# Altium project MaisPipocaG2.PrjPcb (part 1 of 2)
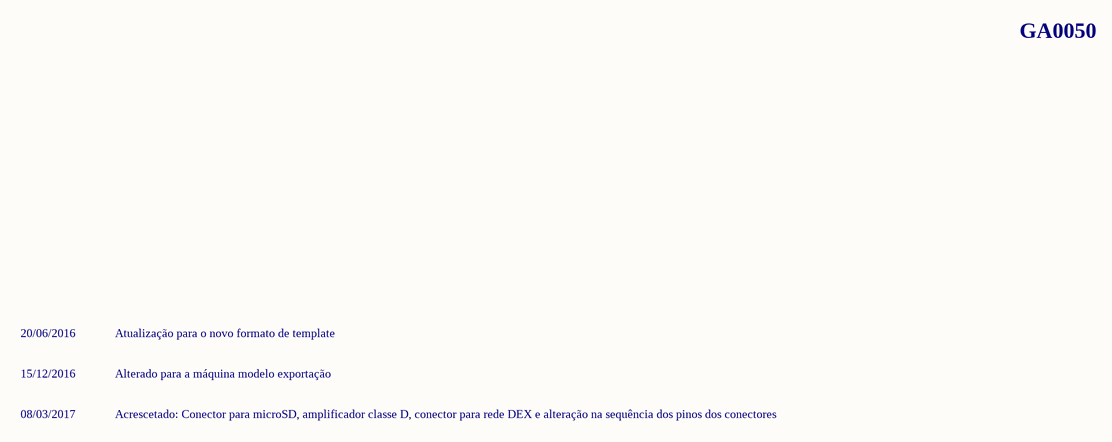
[diagram p0: Capa.SchDoc]
17 sheets, 338 parts. Net scope: global (net labels, ports and power ports of the same name join across sheets).
Board file: PIPOCPUF_2006.PCBDOC
Sheets:
  Capa.SchDoc
  amplificadorAudio.SchDoc
  Barreira_pacote.SchDoc
  Controle_Cupula.SchDoc
  Controle_placa_potencia.SchDoc
  ControleEmbalagem.SchDoc
  ControleLeds.SchDoc
  CPU.SchDoc
  Entrada_comestero_rm5.SchDoc
  IHM.SchDoc
  Interface_gratis.SchDoc
  InterfaceConfiguracao.SchDoc
  JTAG.SchDoc
  Meios_pagamento.SchDoc
  Memoria.SchDoc
  Porta_MDB.SchDoc
  Regulador.SchDoc

## Sheet Capa.SchDoc: CONTROLADORA MAIS PIPOCA - REVISÃO EMC
size A3; Author: Marcos Aquino; DocumentNumber: 1; SheetNumber: 1; SheetTotal: 17; PageSetup: Record=PageOptions|CenterHorizontal=True|CenterVertical=True|PrintScale=0.71|XCorrection=1.00|YCorrection=1.00|PrintKind=0|BorderSize=5000000|LeftOffset=0|BottomOffset=0|Orientation=2|PaperLength=1000|PaperWidth=1000|Scale=100|PaperSource=7|PrintQuality=-3|MediaType=1|DitherType=10|PrintScaleMode=1|PaperKind=A4|PaperIndex=9

### Notes on the sheet
- GA0050
- 20/06/2016
- 15/12/2016
- Atualização para o novo formato de template
- Alterado para a máquina modelo exportação
- 08/03/2017
- Acrescetado: Conector para microSD, amplificador classe D, conector para rede DEX e alteração na sequência dos pinos dos conectores
- Código
- Quark Tecnologia Eletrônica Ltda.
- Rua 216, nº 238 - Sala 01 - Meia Praia - Itapema/SC
- Observações
- (47) 3246-6352  -
- www.quarktee.com.br
- contato@quarktee.com.br
- Projeto
- Quantidade de Páginas
- Revisão
- Projetista
- Local arquivos no servidor
- Data
- Modificação
- Solicitador por:
- Executador por:
- Aprovado por:

## Sheet amplificadorAudio.SchDoc: CONTROLADORA MAIS PIPOCA - REVISÃO EMC
size A3; DocumentNumber: 2; SheetNumber: 2; SheetTotal: 17
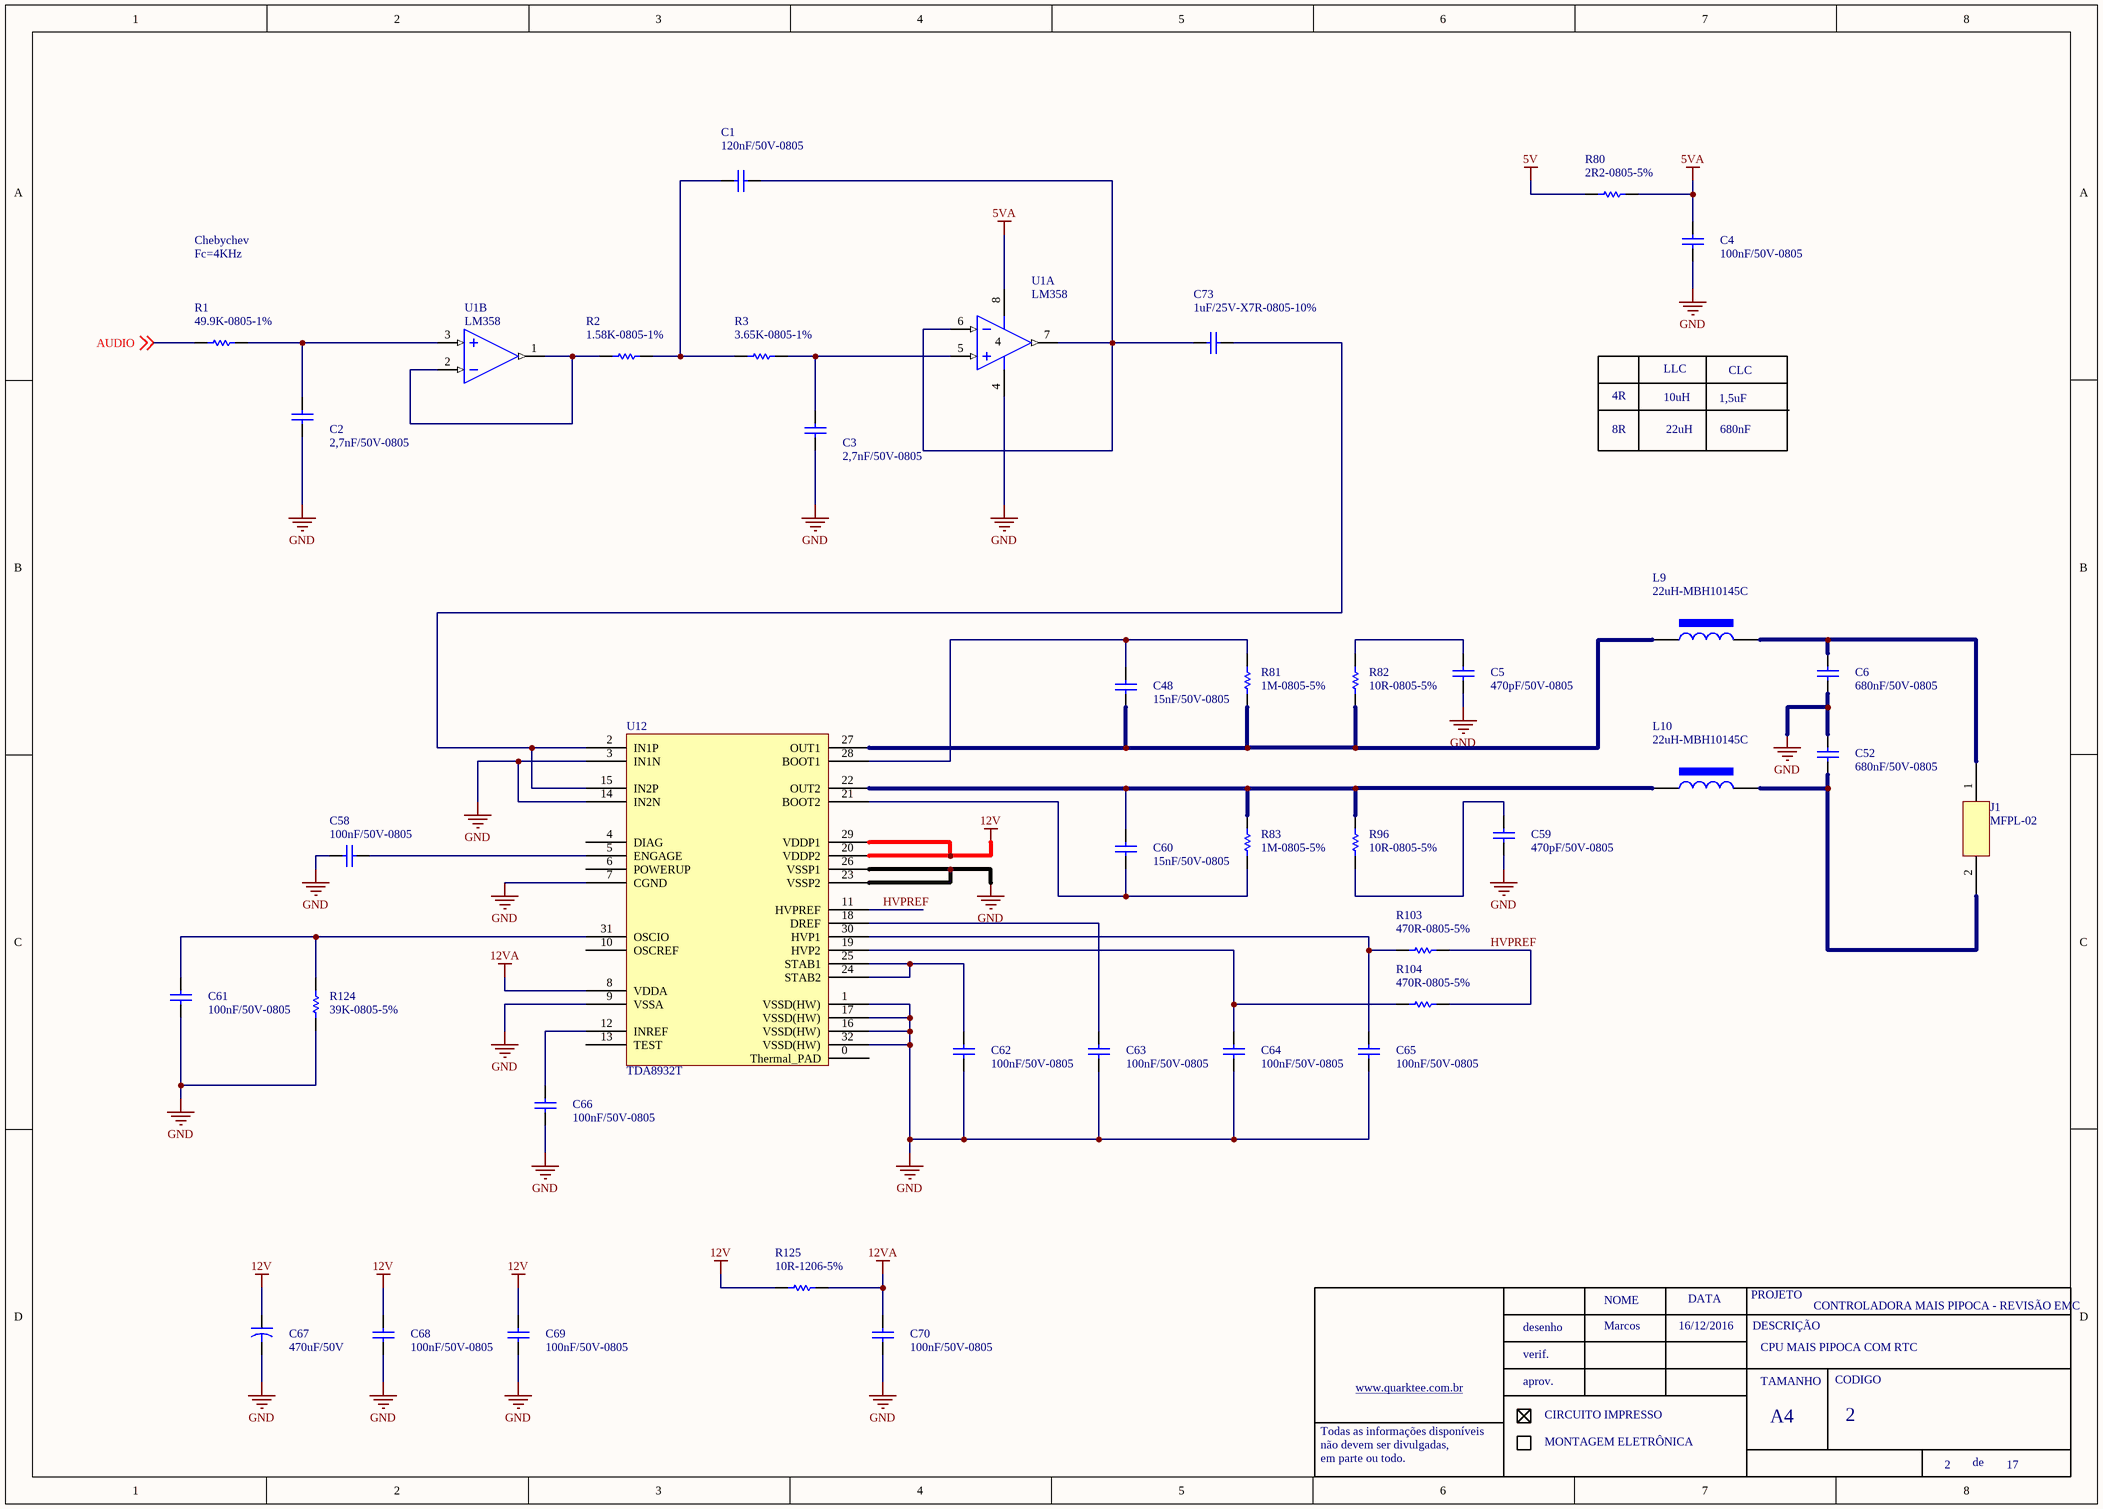
[diagram p1: amplificadorAudio.SchDoc]

### Parts
C1  120nF/50V-0805  [0805-REVISADO ONDA]
C2  2,7nF/50V-0805  [0805-REVISADO ONDA]
C3  2,7nF/50V-0805  [0805-REVISADO ONDA]
C4  100nF/50V-0805  [0805-REVISADO ONDA]
C5  470pF/50V-0805  [0805-REVISADO ONDA]
C6  680nF/50V-0805  [0805-REVISADO ONDA]
C48  15nF/50V-0805  [0805-REVISADO ONDA]
C52  680nF/50V-0805  [0805-REVISADO ONDA]
C58  100nF/50V-0805  [0805-REVISADO ONDA]
C59  470pF/50V-0805  [0805-REVISADO ONDA]
C60  15nF/50V-0805  [0805-REVISADO ONDA]
C61  100nF/50V-0805  [0805-REVISADO ONDA]
C62  100nF/50V-0805  [0805-REVISADO ONDA]
C63  100nF/50V-0805  [0805-REVISADO ONDA]
C64  100nF/50V-0805  [0805-REVISADO ONDA]
C65  100nF/50V-0805  [0805-REVISADO ONDA]
C66  100nF/50V-0805  [0805-REVISADO ONDA]
C67  470uF/50V
C68  100nF/50V-0805  [0805-REVISADO ONDA]
C69  100nF/50V-0805  [0805-REVISADO ONDA]
C70  100nF/50V-0805  [0805-REVISADO ONDA]
C73  1uF/25V-X7R-0805-10%  [0805-REVISADO ONDA]
J1  MFPL-02  [MFPL-02]
L9  22uH-MBH10145C
L10  22uH-MBH10145C
R1  49.9K-0805-1%  [0805-REVISADO ONDA]
R2  1.58K-0805-1%  [0805-REVISADO ONDA]
R3  3.65K-0805-1%  [0805-REVISADO ONDA]
R80  2R2-0805-5%
R81  1M-0805-5%  [0805-REVISADO ONDA]
R82  10R-0805-5%  [0805-REVISADO ONDA]
R83  1M-0805-5%  [0805-REVISADO ONDA]
R96  10R-0805-5%  [0805-REVISADO ONDA]
R103  470R-0805-5%  [0805-REVISADO ONDA]
R104  470R-0805-5%  [0805-REVISADO ONDA]
R124  39K-0805-5%  [0805-REVISADO ONDA]
R125  10R-1206-5%
U1  LM358  (parts A,B of 2)
U12  TDA8932T

### Nets
5V: R80.1
5VA: C4.2 R80.2 U1.8(V+)
12V: C67.1 C68.2 C69.2 R125.1 U12.20(VDDP2) U12.29(VDDP1)
12VA: C70.2 R125.2 U12.8(VDDA)
GND: C2.1 C3.1 C4.1 C5.1 C6.1 C52.2 C58.2 C59.1 C61.1 C62.1 C63.1 C64.1 C65.1 C66.1 C67.2 C68.1 C69.1 C70.1 R124.1 U1.4(GND) U12.1(VSSD(HW)) U12.3(IN1N) U12.7(CGND) U12.9(VSSA) U12.14(IN2N) U12.16(VSSD(HW)) U12.17(VSSD(HW)) U12.23(VSSP2) U12.26(VSSP1) U12.32(VSSD(HW))
AUDIO: R1.1 ; off-sheet AUDIO
HVPREF: R103.1 R104.1 U12.11(HVPREF)
NetC1_1: C1.1 C73.2 U1.6(IN-) U1.7(OUT)
NetC1_2: C1.2 R2.2 R3.1
NetC2_2: C2.2 R1.2 U1.3(IN+)
NetC3_2: C3.2 R3.2 U1.5(IN+)
NetC5_2: C5.2 R82.1
NetC6_2: C6.2 J1.1 L9.1
NetC48_1: C48.1 L9.2 R81.2 R82.2 U12.27(OUT1)
NetC48_2: C48.2 R81.1 U12.28(BOOT1)
NetC52_1: C52.1 J1.2 L10.1
NetC58_1: C58.1 U12.5(ENGAGE)
NetC59_2: C59.2 R96.2
NetC60_1: C60.1 R83.2 U12.21(BOOT2)
NetC60_2: C60.2 L10.2 R83.1 R96.1 U12.22(OUT2)
NetC61_2: C61.2 R124.2 U12.31(OSCIO)
NetC62_2: C62.2 U12.24(STAB2) U12.25(STAB1)
NetC63_2: C63.2 U12.18(DREF)
NetC64_2: C64.2 R104.2 U12.19(HVP2)
NetC65_2: C65.2 R103.2 U12.30(HVP1)
NetC66_2: C66.2 U12.12(INREF)
NetC73_1: C73.1 U12.2(IN1P) U12.15(IN2P)
NetR2_1: R2.1 U1.1(OUT) U1.2(IN-)

Not connected (* = marked no-connect by the designer): U12 0(Thermal_PAD) 4(DIAG) 6(POWERUP) 10(OSCREF) 13(TEST)

### Notes on the sheet
- Chebychev
- Fc=4KHz
- LLC
- CLC
- 4R
- 8R
- 10uH
- 22uH
- 1,5uF
- 680nF
- Marcos
- 16/12/2016
- CPU MAIS PIPOCA COM RTC
- NOME
- DATA
- PROJETO
- DESCRIÇÃO
- www.quarktee.com.br
- desenho
- verif.
- aprov.
- TAMANHO
- CODIGO
- Todas as informações disponíveis
- não devem ser divulgadas,
- em parte ou todo.
- CIRCUITO IMPRESSO
- MONTAGEM ELETRÔNICA
- A4
- de

### Library data of the parts
C1-C3 C5 C6 C48 C52 C59 C60 C73 = 100nF/50-0805-NPO: 100nF/50V-0805; ERP: 104.11.005
C4 C58 C61-C66 C68-C70 = 100nF/50-0805-NPO: ERP: 104.11.005
L9 L10 = indutor 1mH CNF15: 1mH-CNF15-26 AWG; ERP: 211.00.012
R1-R3 R81-R83 R96 R103 R104 R124 = 10K-0805-5%: ERP: 102.11.054
R80 R125 = 10R-0805-5%: ERP: 102.11.019
U1 = LM358: ERP: 10802003
C67 = 470uF/50V: ERP: 105.01.005

## Sheet Barreira_pacote.SchDoc: CONTROLADORA MAIS PIPOCA - REVISÃO EMC
size A3; DocumentNumber: 3; SheetNumber: 3; SheetTotal: 17
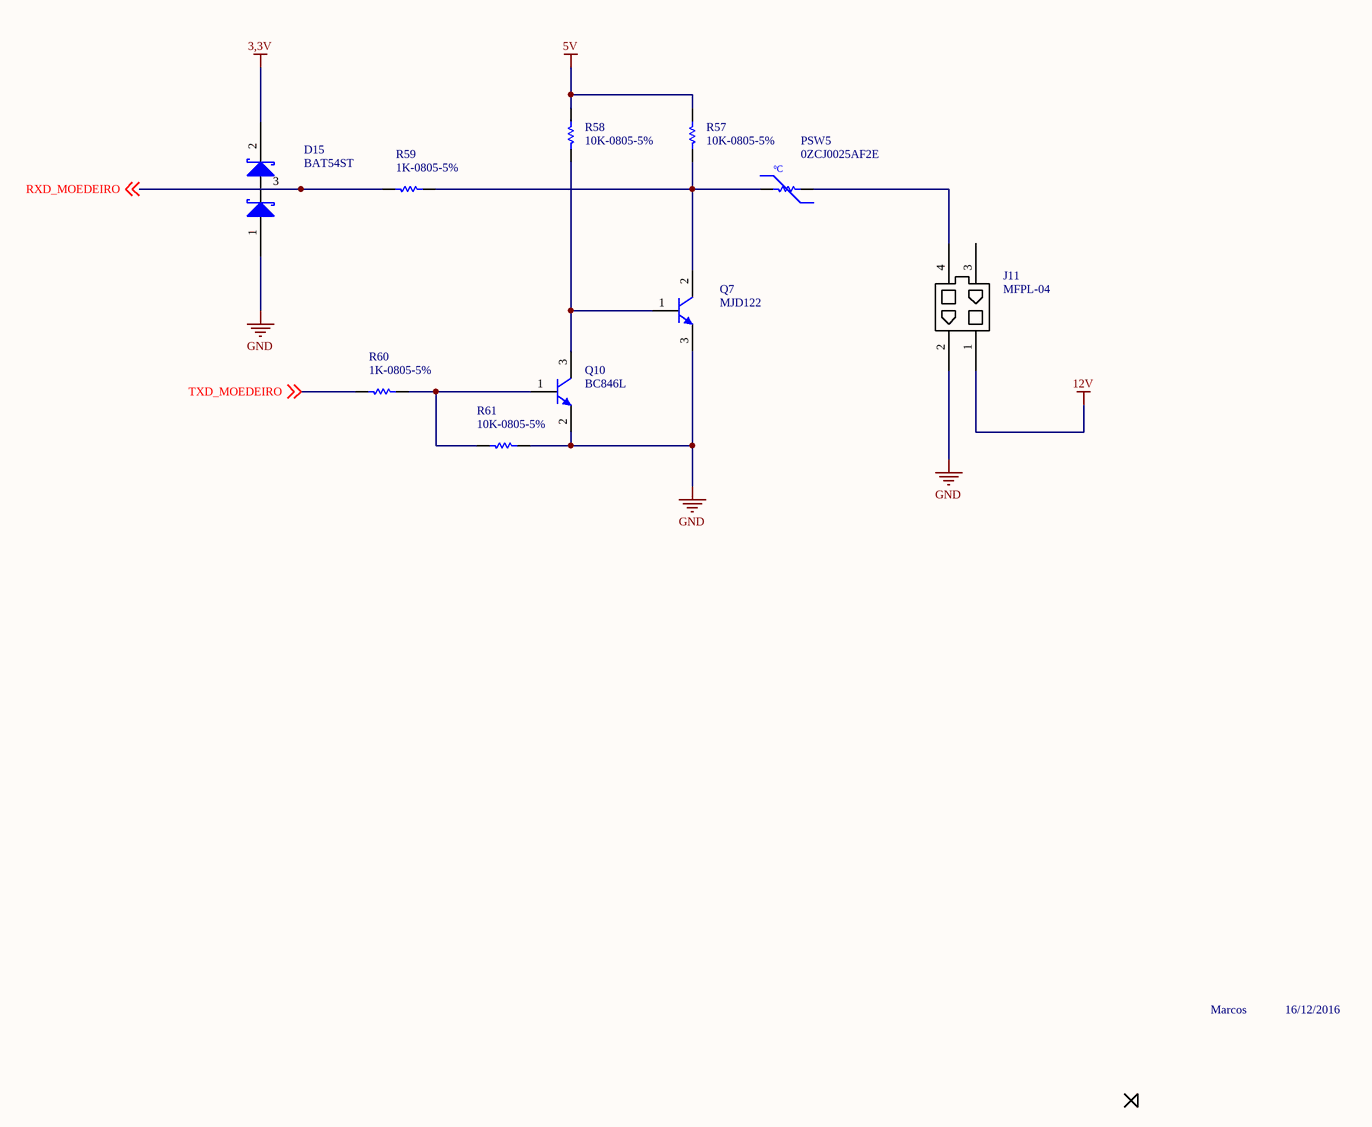
[diagram p2: Barreira_pacote.SchDoc]

### Parts
D15  BAT54ST  [SOT23 - REVISADO ONDA]
J11  MFPL-04
PSW5  0ZCJ0025AF2E  [1206-REVISADO ONDA]
Q7  MJD122  [DPAK REVISADO ONDA]
Q10  BC846L  [SOT23 - REVISADO ONDA]
R57  10K-0805-5%  [0805-REVISADO ONDA]
R58  10K-0805-5%  [0805-REVISADO ONDA]
R59  1K-0805-5%  [0805-REVISADO ONDA]
R60  1K-0805-5%  [0805-REVISADO ONDA]
R61  10K-0805-5%  [0805-REVISADO ONDA]

### Nets
3,3V: D15.2
5V: R57.2 R58.2
12V: J11.1
GND: D15.1 J11.2 Q7.3(E) Q10.2(E) R61.1
RXD_MOEDEIRO: D15.3 R59.2 ; off-sheet RXD_MOEDEIRO
TXD_MOEDEIRO: R60.2 ; off-sheet TXD_MOEDEIRO
NetJ11_4: J11.4 PSW5.1
NetPSW5_2: PSW5.2 Q7.2(C) R57.1 R59.1
NetQ7_1: Q7.1(B) Q10.3(C) R58.1
NetQ10_1: Q10.1(B) R60.1 R61.2

Not connected (* = marked no-connect by the designer): J11 3

### Notes on the sheet
- Marcos
- 16/12/2016
- NOME
- DATA
- PROJETO
- DESCRIÇÃO
- desenho
- verif.
- aprov.
- TAMANHO
- CODIGO
- Todas as informações disponíveis
- não devem ser divulgadas,
- em parte ou todo.
- www.quarktee.com.br
- CIRCUITO IMPRESSO
- MONTAGEM ELETRÔNICA
- A4
- de
- (in symbol PTC 2A-120V) ºC

### Library data of the parts
PSW5 = PTC 2A-120V
Q7 = MJD31
Q10 = BC846: ERP: 106.22.001
R57 R58 R61 = 10K-0805-5%: ERP: 102.11.054
R59 R60 = 1K-0805-5%: ERP: 102.11.042

## Sheet Controle_Cupula.SchDoc: CONTROLADORA MAIS PIPOCA - REVISÃO EMC
size A3; DocumentNumber: 4; SheetNumber: 4; SheetTotal: 17
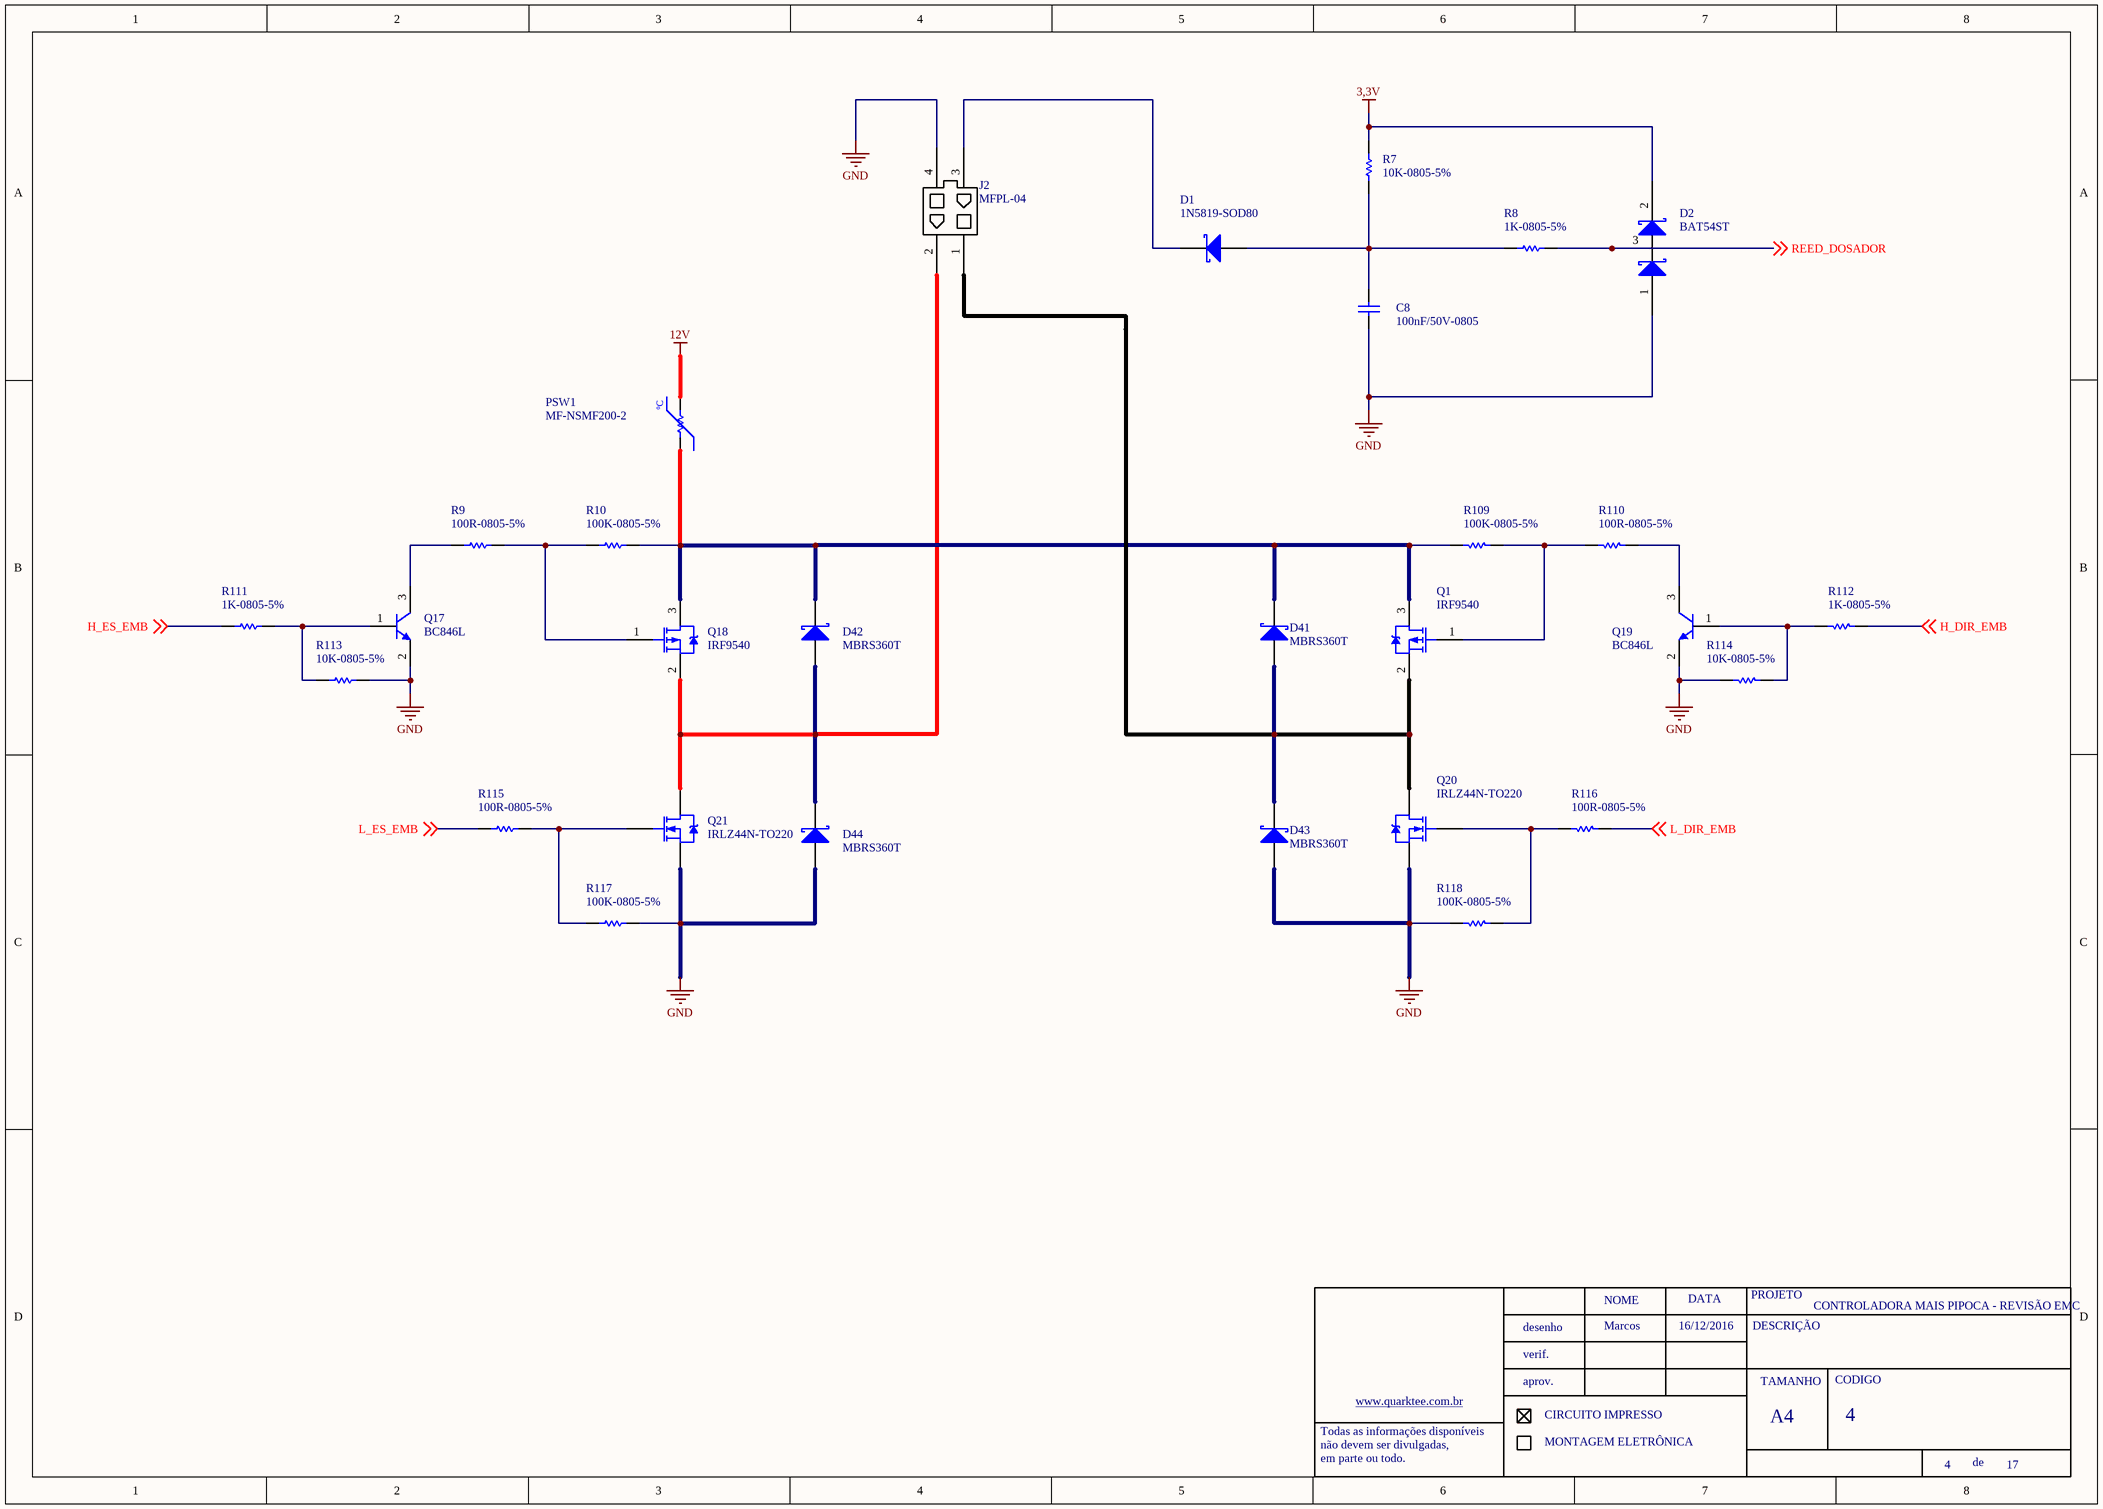
[diagram p3: Controle_Cupula.SchDoc]

### Parts
C8  100nF/50V-0805  [0805-REVISADO ONDA]
D1  1N5819-SOD80  [MINIMLEF/SOD80 - REVISADO ONDA]
D2  BAT54ST  [SOT23 - REVISADO ONDA]
D41  MBRS360T  [DO-214AB]
D42  MBRS360T  [DO-214AB]
D43  MBRS360T  [DO-214AB]
D44  MBRS360T  [DO-214AB]
J2  MFPL-04
PSW1  MF-NSMF200-2  [1206-REVISADO ONDA]
Q1  IRF9540  [TO220-3 EM PÉ]
Q17  BC846L  [SOT23 - REVISADO ONDA]
Q18  IRF9540  [TO220-3 EM PÉ]
Q19  BC846L  [SOT23 - REVISADO ONDA]
Q20  IRLZ44N-TO220  [TO220-3 EM PÉ]
Q21  IRLZ44N-TO220  [TO220-3 EM PÉ]
R7  10K-0805-5%  [0805-REVISADO ONDA]
R8  1K-0805-5%  [0805-REVISADO ONDA]
R9  100R-0805-5%  [0805-REVISADO ONDA]
R10  100K-0805-5%  [0805-REVISADO ONDA]
R109  100K-0805-5%  [0805-REVISADO ONDA]
R110  100R-0805-5%  [0805-REVISADO ONDA]
R111  1K-0805-5%  [0805-REVISADO ONDA]
R112  1K-0805-5%  [0805-REVISADO ONDA]
R113  10K-0805-5%  [0805-REVISADO ONDA]
R114  10K-0805-5%  [0805-REVISADO ONDA]
R115  100R-0805-5%  [0805-REVISADO ONDA]
R116  100R-0805-5%  [0805-REVISADO ONDA]
R117  100K-0805-5%  [0805-REVISADO ONDA]
R118  100K-0805-5%  [0805-REVISADO ONDA]

### Nets
3,3V: D2.2 R7.2
12V: PSW1.2
GND: C8.1 D2.1 D43.1(A) D44.1(A) J2.4 Q17.2(E) Q19.2(E) Q20.3(S) Q21.3(S) R113.2 R114.2 R117.2 R118.2
H_DIR_EMB: R112.1 ; off-sheet H_DIR_EMB
H_ES_EMB: R111.1 ; off-sheet H_ES_EMB
L_DIR_EMB: R116.1 ; off-sheet L_DIR_EMB
L_ES_EMB: R115.1 ; off-sheet L_ES_EMB
REED_DOSADOR: D2.3 R8.2 ; off-sheet REED_DOSADOR
NetC8_2: C8.2 D1.1(A) R7.1 R8.1
NetD1_2: D1.2(K) J2.3
NetD41_1: D41.1(A) D43.2(K) J2.1 Q1.2(DRENO) Q20.2(D)
NetD41_2: D41.2(K) D42.2(K) PSW1.1 Q1.3(SOURCE) Q18.3(SOURCE) R10.2 R109.2
NetD42_1: D42.1(A) D44.2(K) J2.2 Q18.2(DRENO) Q21.2(D)
NetQ1_1: Q1.1(GATE) R109.1 R110.2
NetQ17_1: Q17.1(B) R111.2 R113.1
NetQ17_3: Q17.3(C) R9.1
NetQ18_1: Q18.1(GATE) R9.2 R10.1
NetQ19_1: Q19.1(B) R112.2 R114.1
NetQ19_3: Q19.3(C) R110.1
NetQ20_1: Q20.1(G) R116.2 R118.1
NetQ21_1: Q21.1(G) R115.2 R117.1

### Notes on the sheet
- Marcos
- 16/12/2016
- NOME
- DATA
- PROJETO
- DESCRIÇÃO
- desenho
- verif.
- aprov.
- TAMANHO
- CODIGO
- Todas as informações disponíveis
- não devem ser divulgadas,
- em parte ou todo.
- www.quarktee.com.br
- CIRCUITO IMPRESSO
- MONTAGEM ELETRÔNICA
- A4
- de
- (in symbol POLYSWITCH 200mA) ºC

### Library data of the parts
C8 = 100nF/50-0805-NPO: ERP: 104.11.005
D41-D44 = 1N5819-SOD80: ERP: 121.18.003
PSW1 = POLYSWITCH 200mA: NANOSMDC020F-2; ERP: 128.12.002
Q17 Q19 = BC846: ERP: 106.22.001
R9 R110 = 1K-0805-5%: ERP: 102.11.042
R111 R112 = 10K-0805-5%: ERP: 102.11.054
D1 = 1N5819-SOD80: ERP: 121.18.003
Q20 Q21 = IRLZ44N-TO220: ERP: 107.01.006
R7 R113 R114 = 10K-0805-5%: ERP: 102.11.054
R8 = 1K-0805-5%: ERP: 102.11.042
R10 R109 R117 R118 = 100K-0805-5%: ERP: 102.11.066
R115 R116 = 100R-0805-5%: ERP: 102.11.031

## Sheet Controle_placa_potencia.SchDoc: CONTROLADORA MAIS PIPOCA - REVISÃO EMC
size A3; DocumentNumber: 5; SheetNumber: 5; SheetTotal: 17
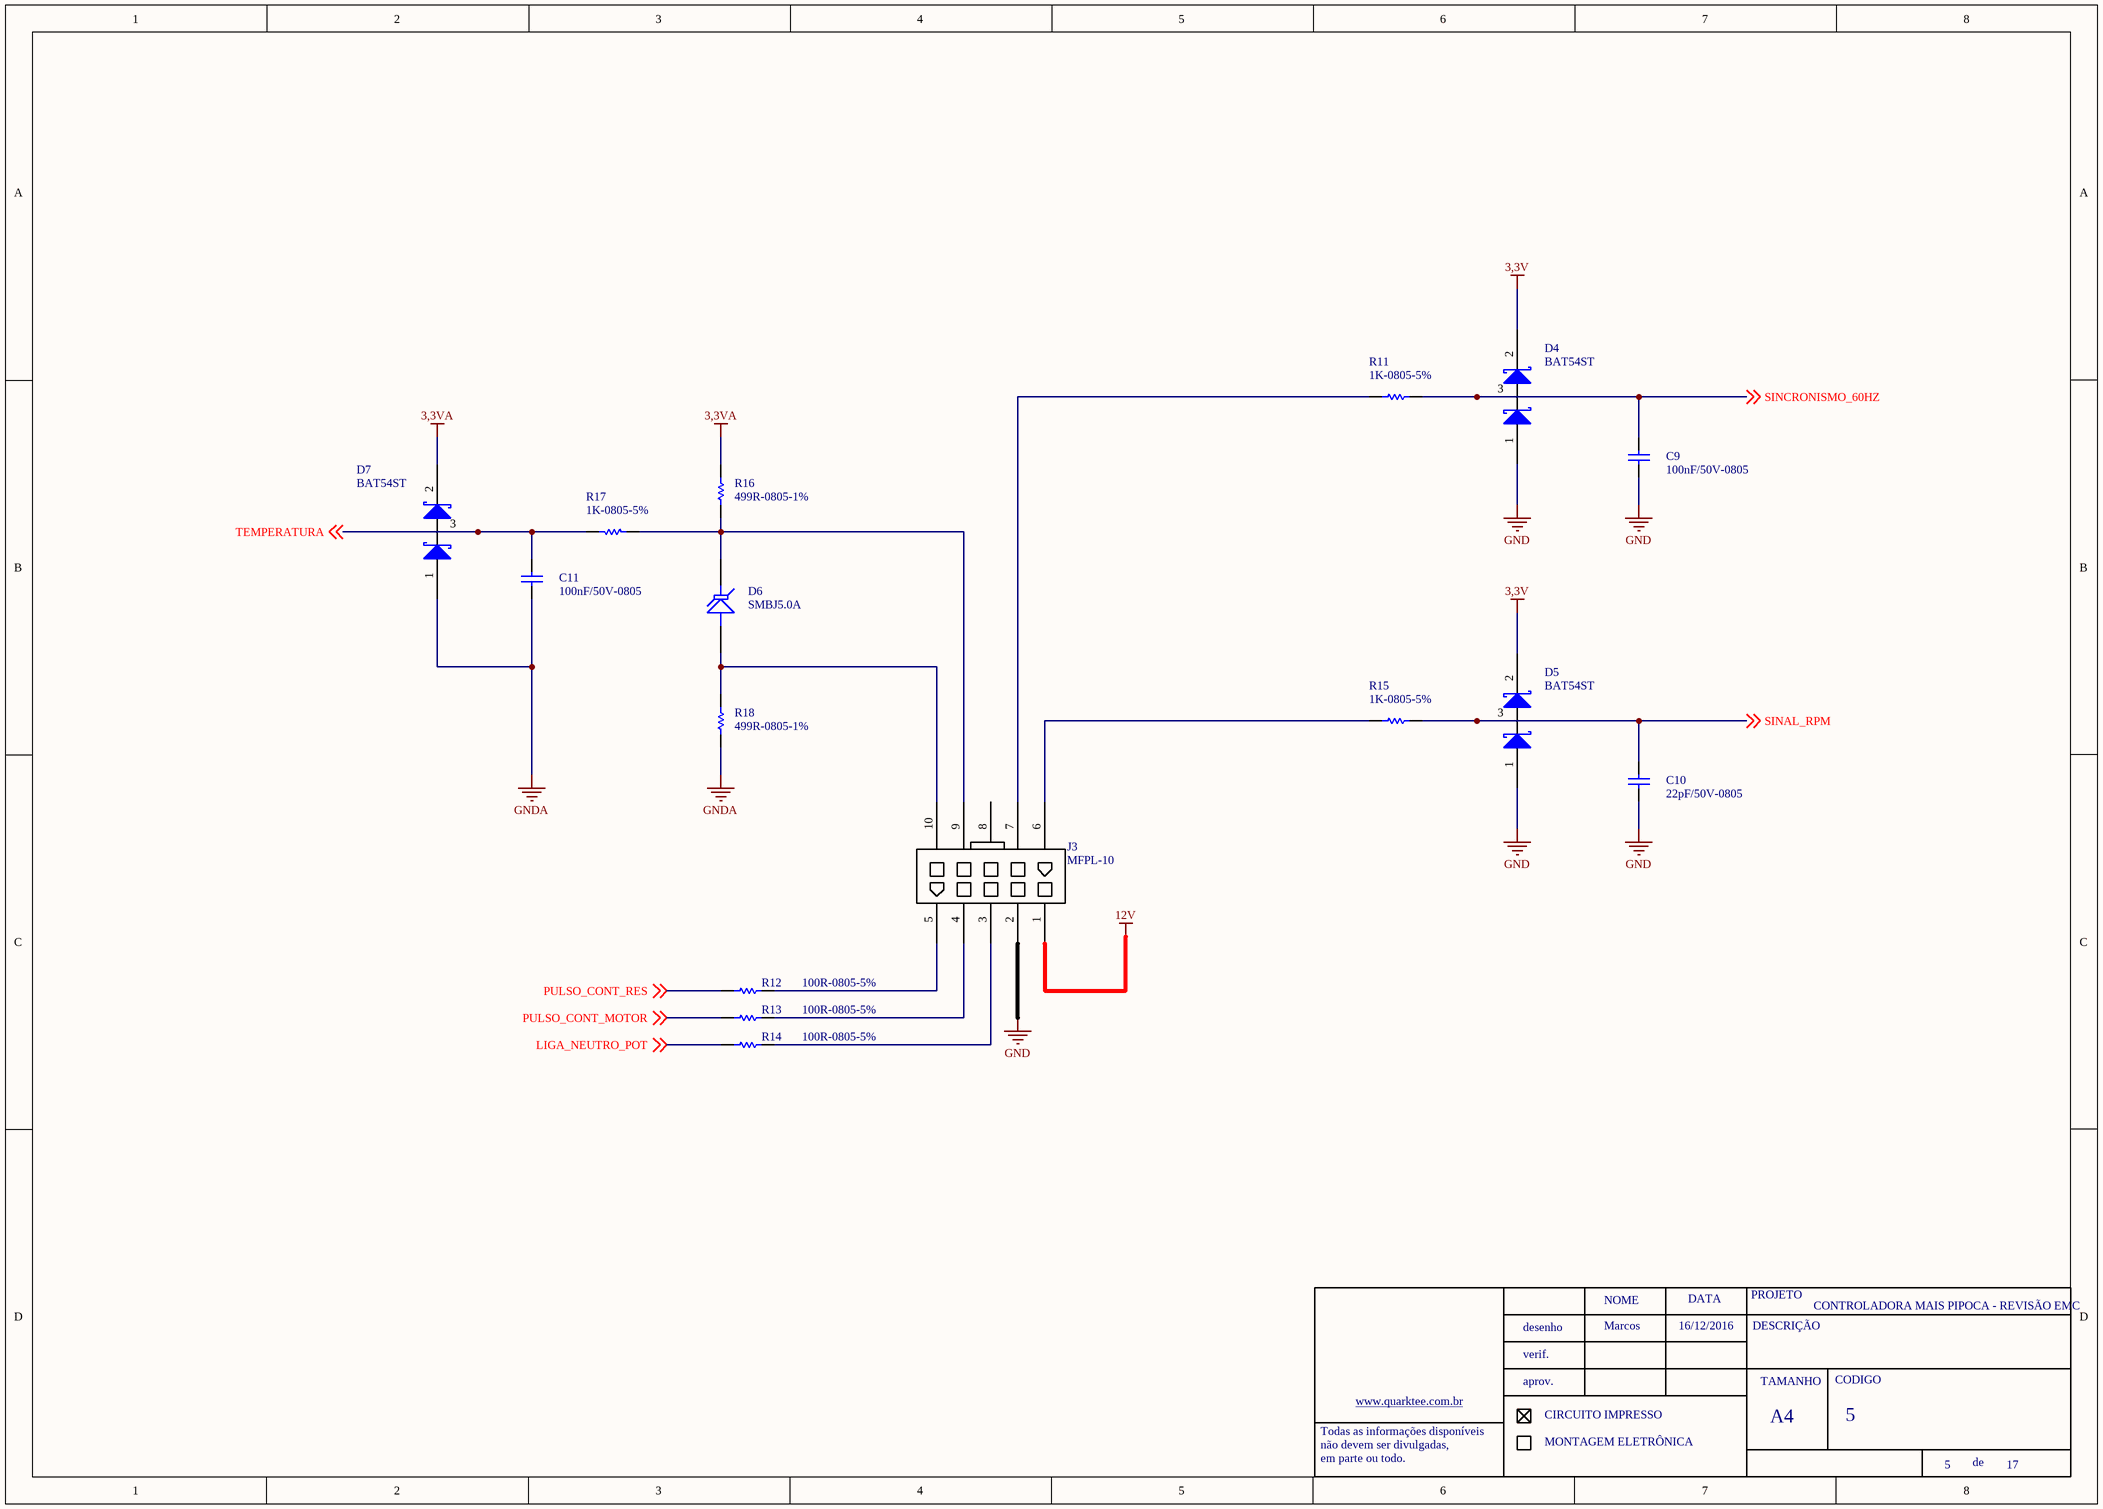
[diagram p4: Controle_placa_potencia.SchDoc]

### Parts
C9  100nF/50V-0805  [0805-REVISADO ONDA]
C10  22pF/50V-0805  [0805-REVISADO ONDA]
C11  100nF/50V-0805  [0805-REVISADO ONDA]
D4  BAT54ST  [SOT23 - REVISADO ONDA]
D5  BAT54ST  [SOT23 - REVISADO ONDA]
D6  SMBJ5.0A  [SMA DIODES]
D7  BAT54ST  [SOT23 - REVISADO ONDA]
J3  MFPL-10
R11  1K-0805-5%  [0805-REVISADO ONDA]
R12  100R-0805-5%  [0805-REVISADO ONDA]
R13  100R-0805-5%  [0805-REVISADO ONDA]
R14  100R-0805-5%  [0805-REVISADO ONDA]
R15  1K-0805-5%  [0805-REVISADO ONDA]
R16  499R-0805-1%  [0805-REVISADO ONDA]
R17  1K-0805-5%  [0805-REVISADO ONDA]
R18  499R-0805-1%  [0805-REVISADO ONDA]

### Nets
3,3V: D4.2 D5.2
3,3VA: D7.2 R16.2
12V: J3.1
GND: C9.2 C10.2 D4.1 D5.1 J3.2
GNDA: C11.1 D7.1 R18.1
LIGA_NEUTRO_POT: R14.1 ; off-sheet LIGA_NEUTRO_POT
PULSO_CONT_MOTOR: R13.1 ; off-sheet PULSO_CONT_MOTOR
PULSO_CONT_RES: R12.2 ; off-sheet PULSO_CONT_RES
SINAL_RPM: C10.1 D5.3 R15.2 ; off-sheet SINAL_RPM
SINCRONISMO_60HZ: C9.1 D4.3 R11.2 ; off-sheet SINCRONISMO_60HZ
TEMPERATURA: C11.2 D7.3 R17.2 ; off-sheet TEMPERATURA
NetD6_1: D6.1(A) J3.10 R18.2
NetD6_2: D6.2(K) J3.9 R16.1 R17.1
NetJ3_3: J3.3 R14.2
NetJ3_4: J3.4 R13.2
NetJ3_5: J3.5 R12.1
NetJ3_6: J3.6 R15.1
NetJ3_7: J3.7 R11.1

Not connected (* = marked no-connect by the designer): J3 8

### Notes on the sheet
- Marcos
- 16/12/2016
- NOME
- DATA
- PROJETO
- DESCRIÇÃO
- desenho
- verif.
- aprov.
- TAMANHO
- CODIGO
- Todas as informações disponíveis
- não devem ser divulgadas,
- em parte ou todo.
- www.quarktee.com.br
- CIRCUITO IMPRESSO
- MONTAGEM ELETRÔNICA
- A4
- de

### Library data of the parts
C9 C11 = 100nF/50-0805-NPO: ERP: 104.11.005
C10 = 100nF/50-0805-NPO: 100nF/50V-0805; ERP: 104.11.005
R16 R18 = 10K-0805-5%: ERP: 102.11.054
D6 = SMBJ5.0A: ERP: 128.02.002
R11 R15 R17 = 1K-0805-5%: ERP: 102.11.042
R12-R14 = 100R-0805-5%: ERP: 102.11.031

## Sheet ControleEmbalagem.SchDoc: CONTROLADORA MAIS PIPOCA - REVISÃO EMC
size A3; DocumentNumber: 6; SheetNumber: 6; SheetTotal: 17
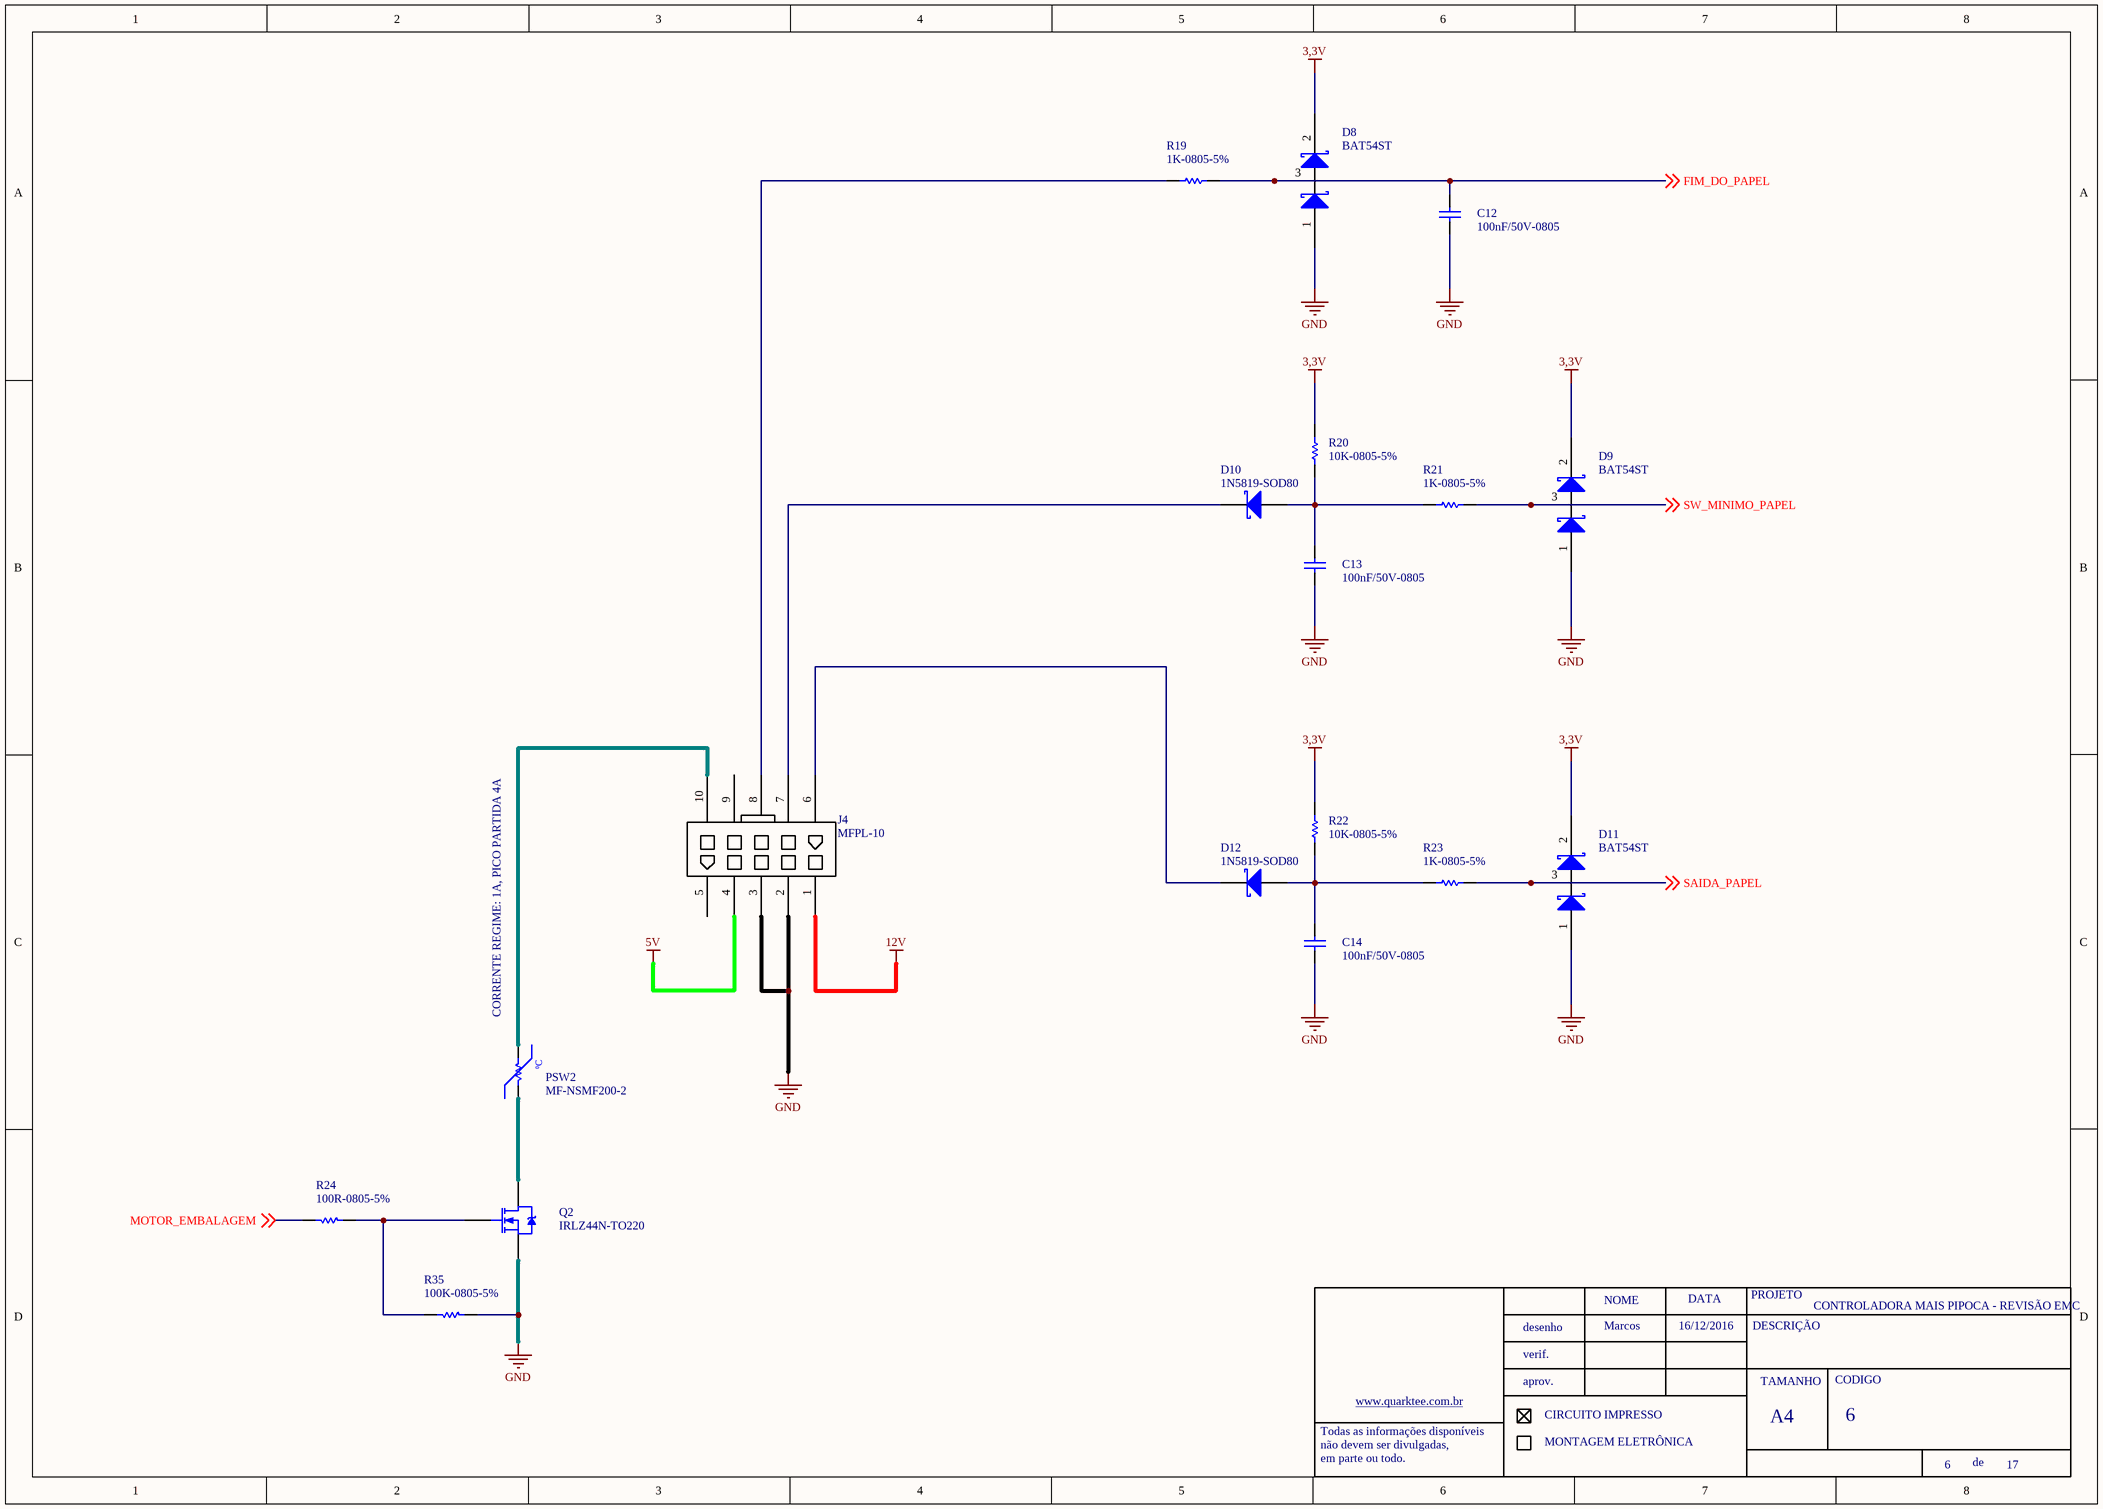
[diagram p5: ControleEmbalagem.SchDoc]

### Parts
C12  100nF/50V-0805  [0805-REVISADO ONDA]
C13  100nF/50V-0805  [0805-REVISADO ONDA]
C14  100nF/50V-0805  [0805-REVISADO ONDA]
D8  BAT54ST  [SOT23 - REVISADO ONDA]
D9  BAT54ST  [SOT23 - REVISADO ONDA]
D10  1N5819-SOD80  [MINIMLEF/SOD80 - REVISADO ONDA]
D11  BAT54ST  [SOT23 - REVISADO ONDA]
D12  1N5819-SOD80  [MINIMLEF/SOD80 - REVISADO ONDA]
J4  MFPL-10
PSW2  MF-NSMF200-2  [1206-REVISADO ONDA]
Q2  IRLZ44N-TO220  [TO220-3 EM PÉ]
R19  1K-0805-5%  [0805-REVISADO ONDA]
R20  10K-0805-5%  [0805-REVISADO ONDA]
R21  1K-0805-5%  [0805-REVISADO ONDA]
R22  10K-0805-5%  [0805-REVISADO ONDA]
R23  1K-0805-5%  [0805-REVISADO ONDA]
R24  100R-0805-5%  [0805-REVISADO ONDA]
R35  100K-0805-5%  [0805-REVISADO ONDA]

### Nets
3,3V: D8.2 D9.2 D11.2 R20.2 R22.2
5V: J4.4
12V: J4.1
GND: C12.1 C13.1 C14.1 D8.1 D9.1 D11.1 J4.2 J4.3 Q2.3(S) R35.1
FIM_DO_PAPEL: C12.2 D8.3 R19.2 ; off-sheet FIM_DO_PAPEL
MOTOR_EMBALAGEM: R24.2 ; off-sheet MOTOR_EMBALAGEM
SAIDA_PAPEL: D11.3 R23.2 ; off-sheet SAIDA_PAPEL
SW_MINIMO_PAPEL: D9.3 R21.2 ; off-sheet SW_MINIMO_PAPEL
NetC13_2: C13.2 D10.1(A) R20.1 R21.1
NetC14_2: C14.2 D12.1(A) R22.1 R23.1
NetD10_2: D10.2(K) J4.7
NetD12_2: D12.2(K) J4.6
NetJ4_8: J4.8 R19.1
NetJ4_10: J4.10 PSW2.2
NetPSW2_1: PSW2.1 Q2.2(D)
NetQ2_1: Q2.1(G) R24.1 R35.2

Not connected (* = marked no-connect by the designer): J4 5 9

### Notes on the sheet
- (near PSW2) CORRENTE REGIME: 1A, PICO PARTIDA 4A
- Marcos
- 16/12/2016
- NOME
- DATA
- PROJETO
- DESCRIÇÃO
- desenho
- verif.
- aprov.
- TAMANHO
- CODIGO
- Todas as informações disponíveis
- não devem ser divulgadas,
- em parte ou todo.
- www.quarktee.com.br
- CIRCUITO IMPRESSO
- MONTAGEM ELETRÔNICA
- A4
- de
- (in symbol POLYSWITCH 200mA) ºC

### Library data of the parts
C12-C14 = 100nF/50-0805-NPO: ERP: 104.11.005
PSW2 = POLYSWITCH 200mA: NANOSMDC020F-2; ERP: 128.12.002
D10 D12 = 1N5819-SOD80: ERP: 121.18.003
Q2 = IRLZ44N-TO220: ERP: 107.01.006
R19 R21 R23 = 1K-0805-5%: ERP: 102.11.042
R20 R22 = 10K-0805-5%: ERP: 102.11.054
R24 = 100R-0805-5%: ERP: 102.11.031
R35 = 100K-0805-5%: ERP: 102.11.066

## Sheet ControleLeds.SchDoc: CONTROLADORA MAIS PIPOCA - REVISÃO EMC
size A3; DocumentNumber: 7; SheetNumber: 7; SheetTotal: 17
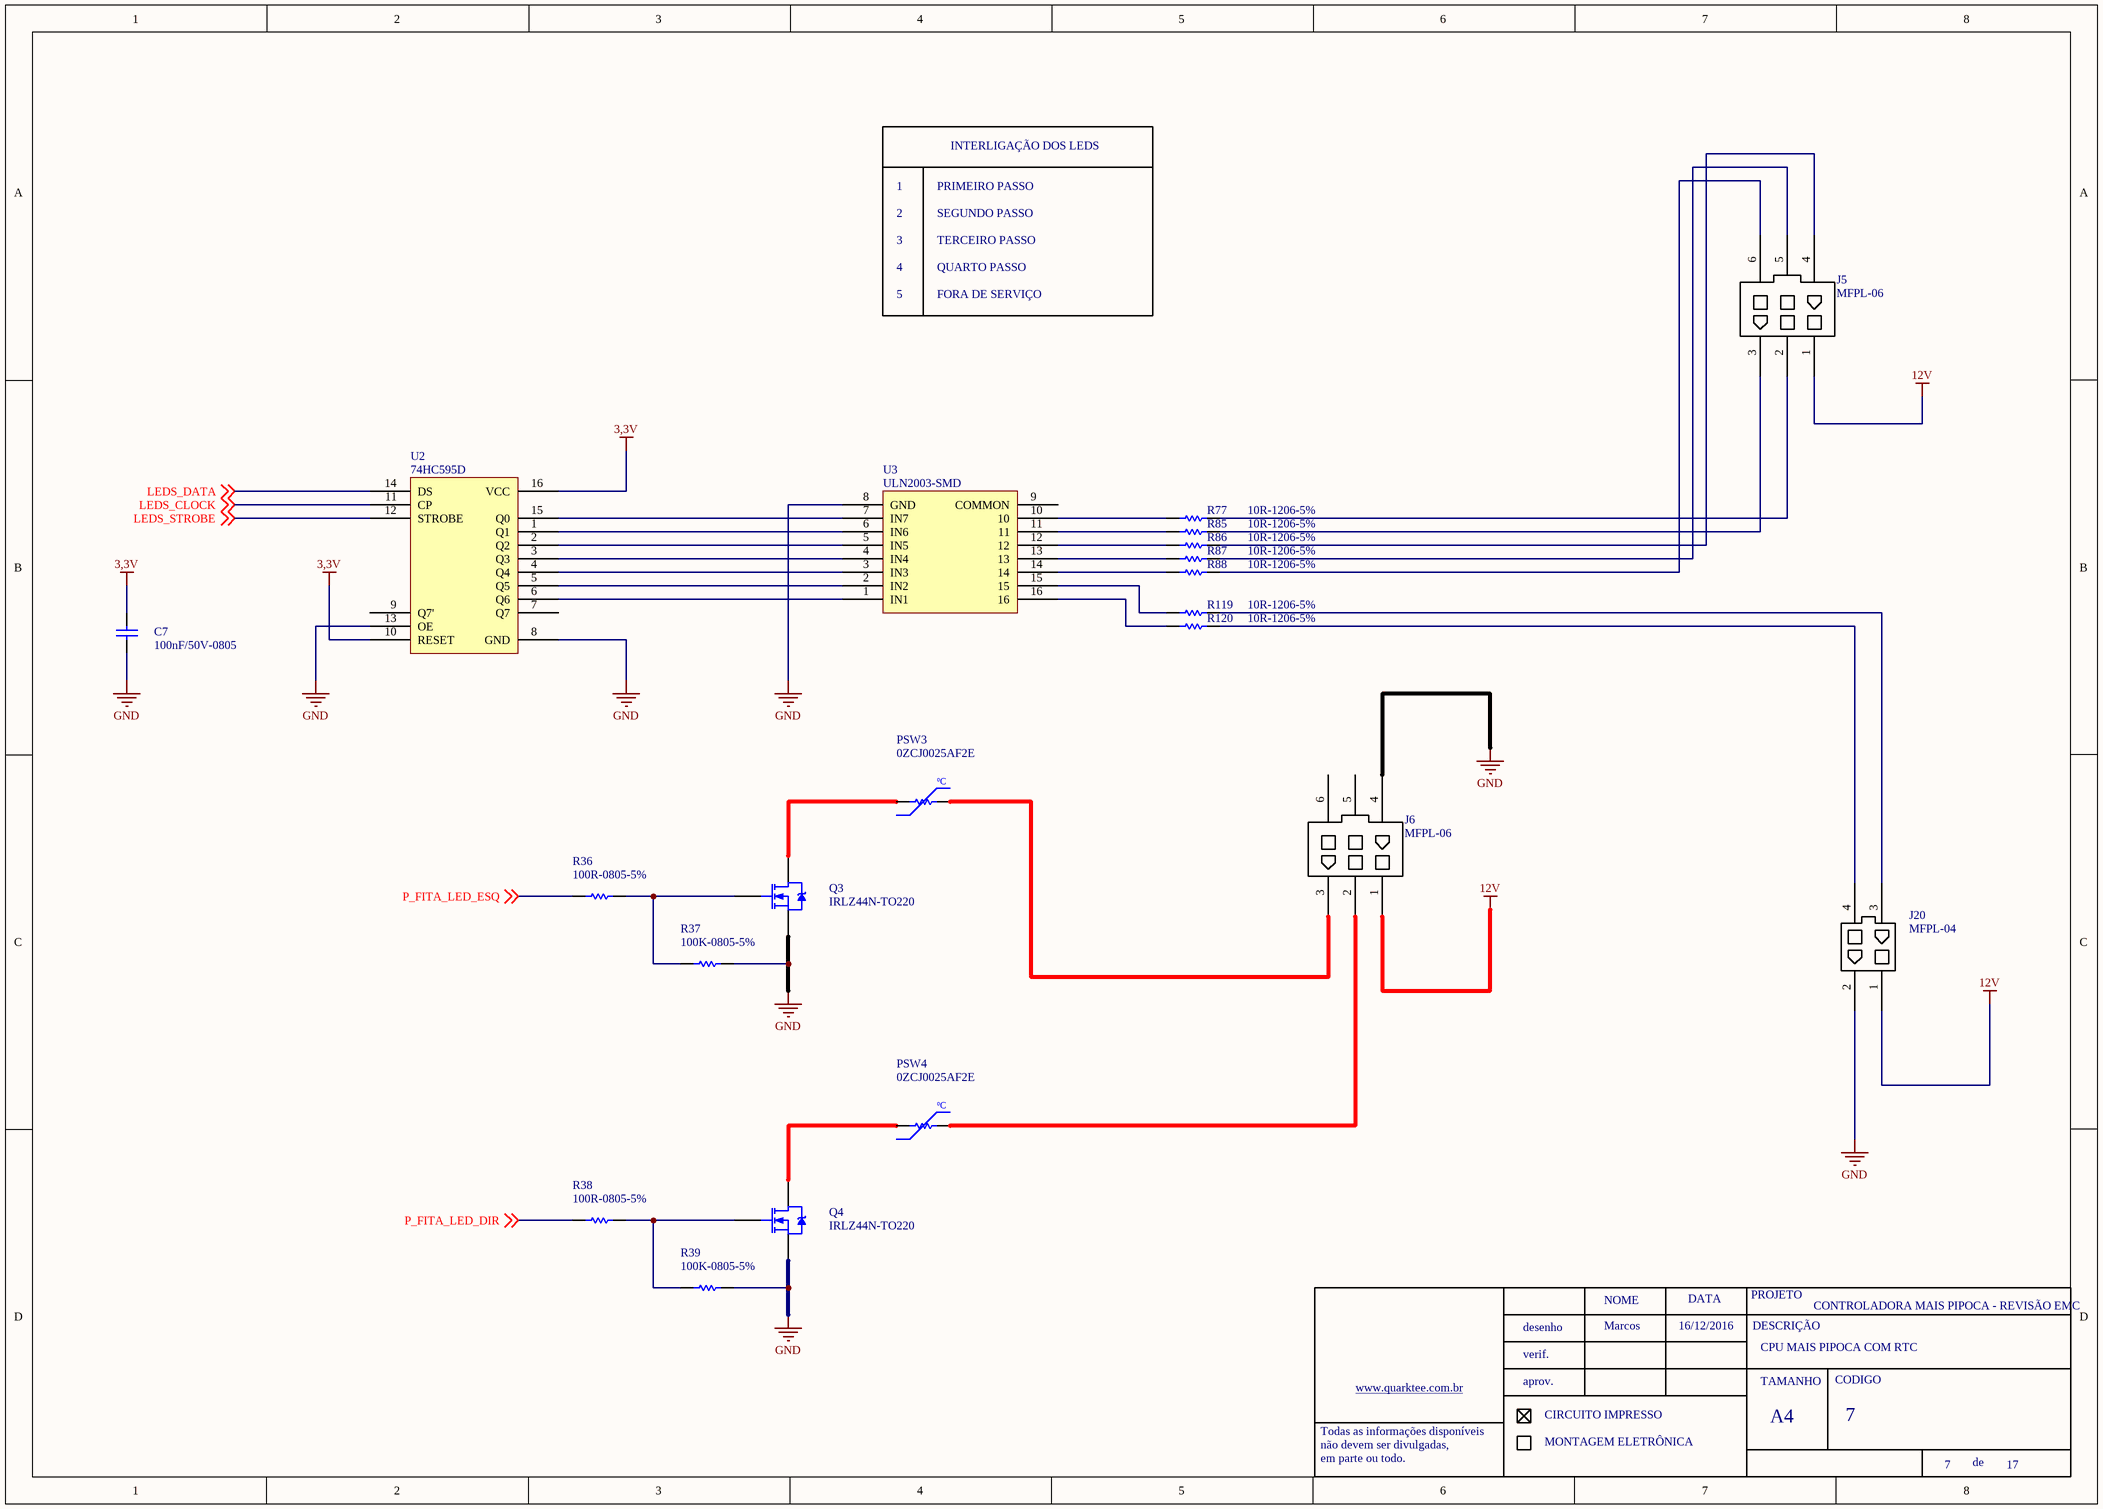
[diagram p6: ControleLeds.SchDoc]

### Parts
C7  100nF/50V-0805  [0805-REVISADO ONDA]
J5  MFPL-06
J6  MFPL-06
J20  MFPL-04
PSW3  0ZCJ0025AF2E  [1206-REVISADO ONDA]
PSW4  0ZCJ0025AF2E  [1206-REVISADO ONDA]
Q3  IRLZ44N-TO220  [TO220-3 EM PÉ]
Q4  IRLZ44N-TO220  [TO220-3 EM PÉ]
R36  100R-0805-5%  [0805-REVISADO ONDA]
R37  100K-0805-5%  [0805-REVISADO ONDA]
R38  100R-0805-5%  [0805-REVISADO ONDA]
R39  100K-0805-5%  [0805-REVISADO ONDA]
R77  10R-1206-5%  [1206-REVISADO ONDA]
R85  10R-1206-5%  [1206-REVISADO ONDA]
R86  10R-1206-5%  [1206-REVISADO ONDA]
R87  10R-1206-5%  [1206-REVISADO ONDA]
R88  10R-1206-5%  [1206-REVISADO ONDA]
R119  10R-1206-5%  [1206-REVISADO ONDA]
R120  10R-1206-5%  [1206-REVISADO ONDA]
U2  74HC595D  [SOIC 16 PINOS]
U3  ULN2003-SMD  [SOIC 16 PINOS]

### Nets
3,3V: C7.2 U2.10(RESET) U2.16(VCC)
12V: J5.1 J6.1 J20.1
GND: C7.1 J6.4 J20.2 Q3.3(S) Q4.3(S) R37.2 R39.2 U2.8(GND) U2.13(OE) U3.8(GND)
LEDS_CLOCK: U2.11(CP) ; off-sheet LEDS_CLOCK
LEDS_DATA: U2.14(DS) ; off-sheet LEDS_DATA
LEDS_STROBE: U2.12(STROBE) ; off-sheet LEDS_STROBE
P_FITA_LED_DIR: R38.1 ; off-sheet P_FITA_LED_DIR
P_FITA_LED_ESQ: R36.1 ; off-sheet P_FITA_LED_ESQ
NetJ5_2: J5.2 R77.2
NetJ5_3: J5.3 R85.2
NetJ5_4: J5.4 R86.2
NetJ5_5: J5.5 R87.2
NetJ5_6: J5.6 R88.2
NetJ6_2: J6.2 PSW4.2
NetJ6_3: J6.3 PSW3.2
NetJ20_3: J20.3 R119.2
NetJ20_4: J20.4 R120.2
NetPSW3_1: PSW3.1 Q3.2(D)
NetPSW4_1: PSW4.1 Q4.2(D)
NetQ3_1: Q3.1(G) R36.2 R37.1
NetQ4_1: Q4.1(G) R38.2 R39.1
NetR77_1: R77.1 U3.10
NetR85_1: R85.1 U3.11
NetR86_1: R86.1 U3.12
NetR87_1: R87.1 U3.13
NetR88_1: R88.1 U3.14
NetR119_1: R119.1 U3.15
NetR120_1: R120.1 U3.16
NetU2_1: U2.1(Q1) U3.6(IN6)
NetU2_2: U2.2(Q2) U3.5(IN5)
NetU2_3: U2.3(Q3) U3.4(IN4)
NetU2_4: U2.4(Q4) U3.3(IN3)
NetU2_5: U2.5(Q5) U3.2(IN2)
NetU2_6: U2.6(Q6) U3.1(IN1)
NetU2_15: U2.15(Q0) U3.7(IN7)

Not connected (* = marked no-connect by the designer): J6 5 6; U2 7(Q7) 9(Q7'); U3 9(COMMON)

### Notes on the sheet
- INTERLIGAÇÃO DOS LEDS
- 1
- 2
- 3
- PRIMEIRO PASSO
- SEGUNDO PASSO
- TERCEIRO PASSO
- 4
- 5
- QUARTO PASSO
- FORA DE SERVIÇO
- Marcos
- 16/12/2016
- CPU MAIS PIPOCA COM RTC
- NOME
- DATA
- PROJETO
- DESCRIÇÃO
- www.quarktee.com.br
- desenho
- verif.
- aprov.
- TAMANHO
- CODIGO
- Todas as informações disponíveis
- não devem ser divulgadas,
- em parte ou todo.
- CIRCUITO IMPRESSO
- MONTAGEM ELETRÔNICA
- A4
- de
- (in symbol PTC 2A-120V) ºC

### Library data of the parts
C7 = 100nF/50-0805-NPO: ERP: 104.11.005
PSW3 PSW4 = PTC 2A-120V
R77 R85-R88 R119 R120 = 10R-0805-5%
U2 = 74HC595D: ERP: CADASTRAR
U3 = ULN2003
Q3 Q4 = IRLZ44N-TO220: ERP: 107.01.006
R36 R38 = 100R-0805-5%: ERP: 102.11.031
R37 R39 = 100K-0805-5%: ERP: 102.11.066

## Sheet CPU.SchDoc: CONTROLADORA MAIS PIPOCA - REVISÃO EMC
size A3; DocumentNumber: 8; SheetNumber: 8; SheetTotal: 17
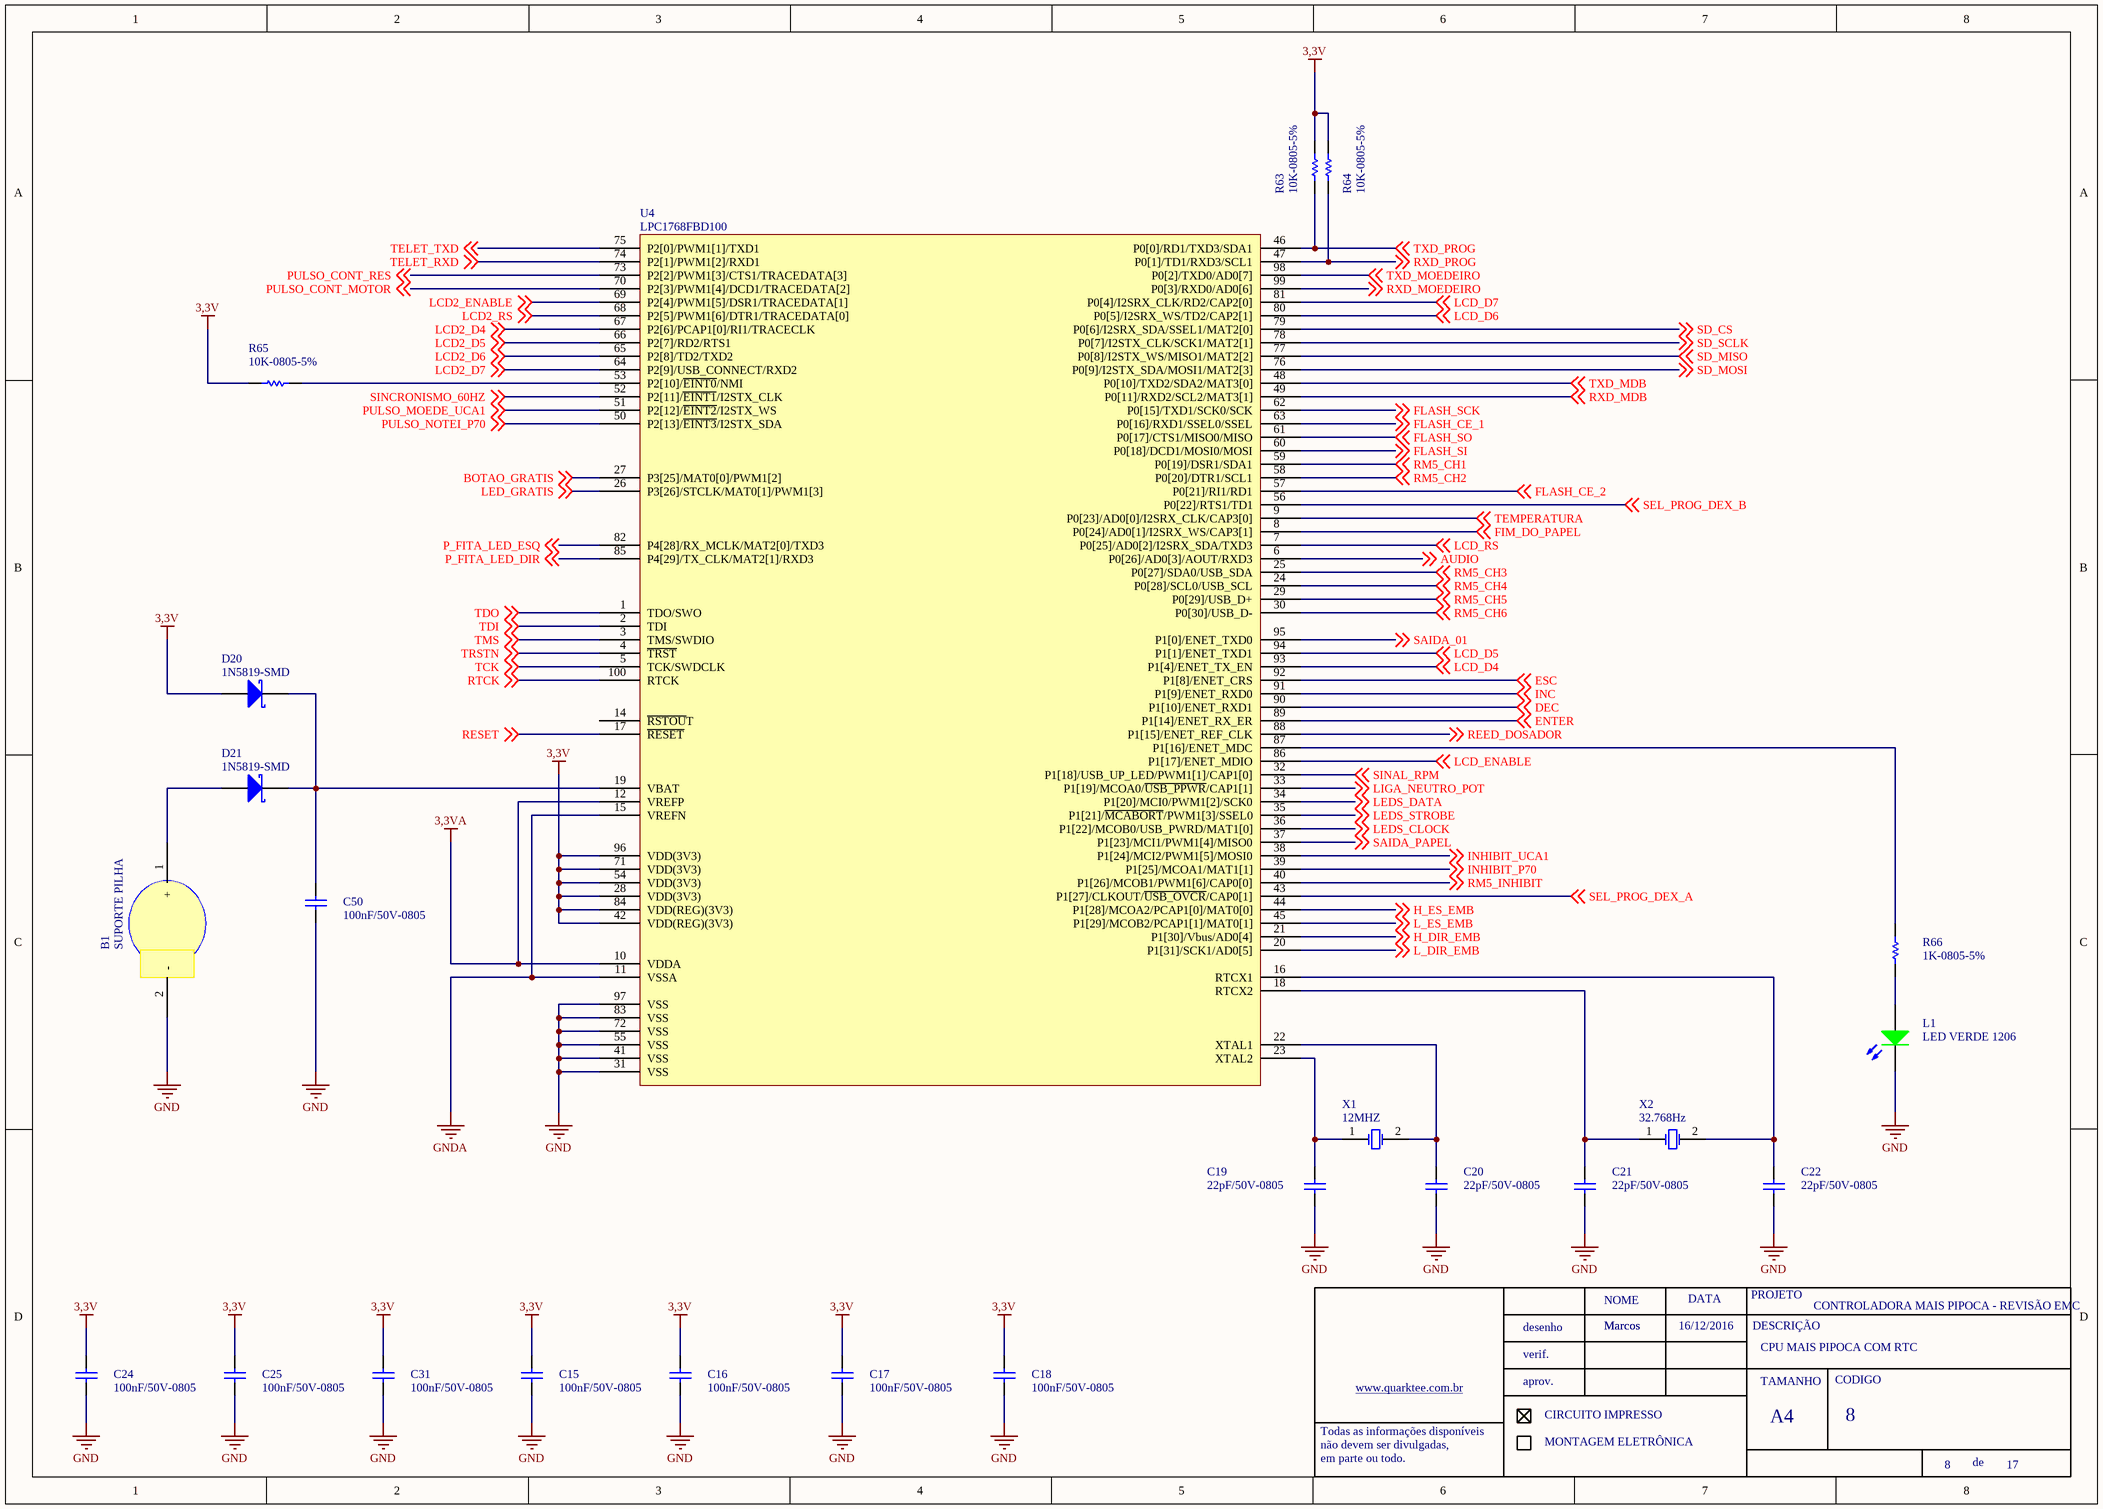
[diagram p7: CPU.SchDoc]

### Parts
B1  SUPORTE PILHA  [SUPORTE PILHA CR2032]
C15  100nF/50V-0805  [0805-REVISADO ONDA]
C16  100nF/50V-0805  [0805-REVISADO ONDA]
C17  100nF/50V-0805  [0805-REVISADO ONDA]
C18  100nF/50V-0805  [0805-REVISADO ONDA]
C19  22pF/50V-0805  [0805-REVISADO ONDA]
C20  22pF/50V-0805  [0805-REVISADO ONDA]
C21  22pF/50V-0805  [0805-REVISADO ONDA]
C22  22pF/50V-0805  [0805-REVISADO ONDA]
C24  100nF/50V-0805  [0805-REVISADO ONDA]
C25  100nF/50V-0805  [0805-REVISADO ONDA]
C31  100nF/50V-0805  [0805-REVISADO ONDA]
C50  100nF/50V-0805  [0805-REVISADO ONDA]
D20  1N5819-SMD
D21  1N5819-SMD
L1  LED VERDE 1206  [LED 1206]
R63  10K-0805-5%  [0805-REVISADO ONDA]
R64  10K-0805-5%  [0805-REVISADO ONDA]
R65  10K-0805-5%  [0805-REVISADO ONDA]
R66  1K-0805-5%  [0805-REVISADO ONDA]
U4  LPC1768FBD100  [LQFP-100 pasta]
X1  12MHZ  [HC49USM]
X2  32.768Hz  [CRISTAL TH3]

### Nets
3,3V: C15.2 C16.2 C17.2 C18.2 C24.2 C25.2 C31.2 D20.1(A) R63.2 R64.2 R65.1 U4.28(VDD(3V3)) U4.42(VDD(REG)(3V3)) U4.54(VDD(3V3)) U4.71(VDD(3V3)) U4.84(VDD(REG)(3V3)) U4.96(VDD(3V3))
3,3VA: U4.10(VDDA) U4.12(VREFP)
GND: B1.2(-) C15.1 C16.1 C17.1 C18.1 C19.1 C20.1 C21.1 C22.1 C24.1 C25.1 C31.1 C50.1 L1.2(K) U4.31(VSS) U4.41(VSS) U4.55(VSS) U4.72(VSS) U4.83(VSS) U4.97(VSS)
GNDA: U4.11(VSSA) U4.15(VREFN)
AUDIO: U4.6(P0[26]/AD0[3]/AOUT/RXD3) ; off-sheet AUDIO
BOTAO_GRATIS: U4.27(P3[25]/MAT0[0]/PWM1[2]) ; off-sheet BOTAO_GRATIS
DEC: U4.90(P1[10]/ENET_RXD1) ; off-sheet DEC
ENTER: U4.89(P1[14]/ENET_RX_ER) ; off-sheet ENTER
ESC: U4.92(P1[8]/ENET_CRS) ; off-sheet ESC
FIM_DO_PAPEL: U4.8(P0[24]/AD0[1]/I2SRX_WS/CAP3[1]) ; off-sheet FIM_DO_PAPEL
FLASH_CE_1: U4.63(P0[16]/RXD1/SSEL0/SSEL) ; off-sheet FLASH_CE_1
FLASH_CE_2: U4.57(P0[21]/RI1/RD1) ; off-sheet FLASH_CE_2
FLASH_SCK: U4.62(P0[15]/TXD1/SCK0/SCK) ; off-sheet FLASH_SCK
FLASH_SI: U4.60(P0[18]/DCD1/MOSI0/MOSI) ; off-sheet FLASH_SI
FLASH_SO: U4.61(P0[17]/CTS1/MISO0/MISO) ; off-sheet FLASH_SO
H_DIR_EMB: U4.21(P1[30]/Vbus/AD0[4]) ; off-sheet H_DIR_EMB
H_ES_EMB: U4.44(P1[28]/MCOA2/PCAP1[0]/MAT0[0]) ; off-sheet H_ES_EMB
INC: U4.91(P1[9]/ENET_RXD0) ; off-sheet INC
INHIBIT_P70: U4.39(P1[25]/MCOA1/MAT1[1]) ; off-sheet INHIBIT_P70
INHIBIT_UCA1: U4.38(P1[24]/MCI2/PWM1[5]/MOSI0) ; off-sheet INHIBIT_UCA1
L_DIR_EMB: U4.20(P1[31]/SCK1/AD0[5]) ; off-sheet L_DIR_EMB
L_ES_EMB: U4.45(P1[29]/MCOB2/PCAP1[1]/MAT0[1]) ; off-sheet L_ES_EMB
LCD2_D4: U4.67(P2[6]/PCAP1[0]/RI1/TRACECLK) ; off-sheet LCD2_D4
LCD2_D5: U4.66(P2[7]/RD2/RTS1) ; off-sheet LCD2_D5
LCD2_D6: U4.65(P2[8]/TD2/TXD2) ; off-sheet LCD2_D6
LCD2_D7: U4.64(P2[9]/USB_CONNECT/RXD2) ; off-sheet LCD2_D7
LCD2_ENABLE: U4.69(P2[4]/PWM1[5]/DSR1/TRACEDATA[1]) ; off-sheet LCD2_ENABLE
LCD2_RS: U4.68(P2[5]/PWM1[6]/DTR1/TRACEDATA[0]) ; off-sheet LCD2_RS
LCD_D4: U4.93(P1[4]/ENET_TX_EN) ; off-sheet LCD_D4
LCD_D5: U4.94(P1[1]/ENET_TXD1) ; off-sheet LCD_D5
LCD_D6: U4.80(P0[5]/I2SRX_WS/TD2/CAP2[1]) ; off-sheet LCD_D6
LCD_D7: U4.81(P0[4]/I2SRX_CLK/RD2/CAP2[0]) ; off-sheet LCD_D7
LCD_ENABLE: U4.86(P1[17]/ENET_MDIO) ; off-sheet LCD_ENABLE
LCD_RS: U4.7(P0[25]/AD0[2]/I2SRX_SDA/TXD3) ; off-sheet LCD_RS
LED_GRATIS: U4.26(P3[26]/STCLK/MAT0[1]/PWM1[3]) ; off-sheet LED_GRATIS
LEDS_CLOCK: U4.36(P1[22]/MCOB0/USB_PWRD/MAT1[0]) ; off-sheet LEDS_CLOCK
LEDS_DATA: U4.34(P1[20]/MCI0/PWM1[2]/SCK0) ; off-sheet LEDS_DATA
LEDS_STROBE: U4.35(P1[21]/~{MCABORT}/PWM1[3]/SSEL0) ; off-sheet LEDS_STROBE
LIGA_NEUTRO_POT: U4.33(P1[19]/MCOA0/~{USB_PPWR}/CAP1[1]) ; off-sheet LIGA_NEUTRO_POT
P_FITA_LED_DIR: U4.85(P4[29]/TX_CLK/MAT2[1]/RXD3) ; off-sheet P_FITA_LED_DIR
P_FITA_LED_ESQ: U4.82(P4[28]/RX_MCLK/MAT2[0]/TXD3) ; off-sheet P_FITA_LED_ESQ
PULSO_CONT_MOTOR: U4.70(P2[3]/PWM1[4]/DCD1/TRACEDATA[2]) ; off-sheet PULSO_CONT_MOTOR
PULSO_CONT_RES: U4.73(P2[2]/PWM1[3]/CTS1/TRACEDATA[3]) ; off-sheet PULSO_CONT_RES
PULSO_MOEDE_UCA1: U4.51(P2[12]/~{EINT2}/I2STX_WS) ; off-sheet PULSO_MOEDE_UCA1
PULSO_NOTEI_P70: U4.50(P2[13]/~{EINT3}/I2STX_SDA) ; off-sheet PULSO_NOTEI_P70
REED_DOSADOR: U4.88(P1[15]/ENET_REF_CLK) ; off-sheet REED_DOSADOR
RESET: U4.17(~{RESET}) ; off-sheet RESET
RM5_CH1: U4.59(P0[19]/DSR1/SDA1) ; off-sheet RM5_CH1
RM5_CH2: U4.58(P0[20]/DTR1/SCL1) ; off-sheet RM5_CH2
RM5_CH3: U4.25(P0[27]/SDA0/USB_SDA) ; off-sheet RM5_CH3
RM5_CH4: U4.24(P0[28]/SCL0/USB_SCL) ; off-sheet RM5_CH4
RM5_CH5: U4.29(P0[29]/USB_D+) ; off-sheet RM5_CH5
RM5_CH6: U4.30(P0[30]/USB_D-) ; off-sheet RM5_CH6
RM5_INHIBIT: U4.40(P1[26]/MCOB1/PWM1[6]/CAP0[0]) ; off-sheet RM5_INHIBIT
RTCK: U4.100(RTCK) ; off-sheet RTCK
RXD_MDB: U4.49(P0[11]/RXD2/SCL2/MAT3[1]) ; off-sheet RXD_MDB
RXD_MOEDEIRO: U4.99(P0[3]/RXD0/AD0[6]) ; off-sheet RXD_MOEDEIRO
RXD_PROG: R64.1 U4.47(P0[1]/TD1/RXD3/SCL1) ; off-sheet RXD_PROG
SAIDA_01: U4.95(P1[0]/ENET_TXD0) ; off-sheet SAIDA_01
SAIDA_PAPEL: U4.37(P1[23]/MCI1/PWM1[4]/MISO0) ; off-sheet SAIDA_PAPEL
SD_CS: U4.79(P0[6]/I2SRX_SDA/SSEL1/MAT2[0]) ; off-sheet SD_CS
SD_MISO: U4.77(P0[8]/I2STX_WS/MISO1/MAT2[2]) ; off-sheet SD_MISO
SD_MOSI: U4.76(P0[9]/I2STX_SDA/MOSI1/MAT2[3]) ; off-sheet SD_MOSI
SD_SCLK: U4.78(P0[7]/I2STX_CLK/SCK1/MAT2[1]) ; off-sheet SD_SCLK
SEL_PROG_DEX_A: U4.43(P1[27]/CLKOUT/~{USB_OVCR}/CAP0[1]) ; off-sheet SEL_PROG_DEX_A
SEL_PROG_DEX_B: U4.56(P0[22]/RTS1/TD1) ; off-sheet SEL_PROG_DEX_B
SINAL_RPM: U4.32(P1[18]/USB_UP_LED/PWM1[1]/CAP1[0]) ; off-sheet SINAL_RPM
SINCRONISMO_60HZ: U4.52(P2[11]/~{EINT1}/I2STX_CLK) ; off-sheet SINCRONISMO_60HZ
TCK: U4.5(TCK/SWDCLK) ; off-sheet TCK
TDI: U4.2(TDI) ; off-sheet TDI
TDO: U4.1(TDO/SWO) ; off-sheet TDO
TELET_RXD: U4.74(P2[1]/PWM1[2]/RXD1) ; off-sheet TELET_RXD
TELET_TXD: U4.75(P2[0]/PWM1[1]/TXD1) ; off-sheet TELET_TXD
TEMPERATURA: U4.9(P0[23]/AD0[0]/I2SRX_CLK/CAP3[0]) ; off-sheet TEMPERATURA
TMS: U4.3(TMS/SWDIO) ; off-sheet TMS
TRSTN: U4.4(~{TRST}) ; off-sheet TRSTN
TXD_MDB: U4.48(P0[10]/TXD2/SDA2/MAT3[0]) ; off-sheet TXD_MDB
TXD_MOEDEIRO: U4.98(P0[2]/TXD0/AD0[7]) ; off-sheet TXD_MOEDEIRO
TXD_PROG: R63.1 U4.46(P0[0]/RD1/TXD3/SDA1) ; off-sheet TXD_PROG
NetB1_1: B1.1(+) D21.1(A)
NetC19_2: C19.2 U4.23(XTAL2) X1.1(OSC1)
NetC20_2: C20.2 U4.22(XTAL1) X1.2(OSC2)
NetC21_2: C21.2 U4.18(RTCX2) X2.1(OSC1)
NetC22_2: C22.2 U4.16(RTCX1) X2.2(OSC2)
NetC50_2: C50.2 D20.2(K) D21.2(K) U4.19(VBAT)
NetL1_1: L1.1(A) R66.1
NetR65_2: R65.2 U4.53(P2[10]/~{EINT0}/NMI)
NetR66_2: R66.2 U4.87(P1[16]/ENET_MDC)

Not connected (* = marked no-connect by the designer): U4 14(~{RSTOU}T)

### Notes on the sheet
- Marcos
- 16/12/2016
- CPU MAIS PIPOCA COM RTC
- NOME
- DATA
- PROJETO
- DESCRIÇÃO
- www.quarktee.com.br
- desenho
- verif.
- aprov.
- TAMANHO
- CODIGO
- Todas as informações disponíveis
- não devem ser divulgadas,
- em parte ou todo.
- CIRCUITO IMPRESSO
- MONTAGEM ELETRÔNICA
- A4
- de

### Library data of the parts
B1 = SUPORTE PILHA CR2032: ERP: 437.00.100
C15-C18 C24 C25 C31 C50 = 100nF/50-0805-NPO: ERP: 104.11.005
C19-C22 = 22pF-0805-NPO: ERP: 104.11.001
D20 D21 = 1N5819: ERP: 121.20.002
L1 = LED VERDE 0603 SMD: LED VERDE 0603 VERDE; ERP: 124.02.011
U4 = LPC1768FDB100: ERP: 110.02.004
X1 = CRISTAL 12MHZ: ERP: 134.01.003
X2 = CRISTAL 32.768 Hz: CRISTAL 32.768Hz; ERP: 134.01.002
R63-R65 = 10K-0805-5%: ERP: 102.11.054
R66 = 1K-0805-5%: ERP: 102.11.042

## Sheet Entrada_comestero_rm5.SchDoc: CONTROLADORA MAIS PIPOCA - REVISÃO EMC
size A3; DocumentNumber: 9; SheetNumber: 9; SheetTotal: 17
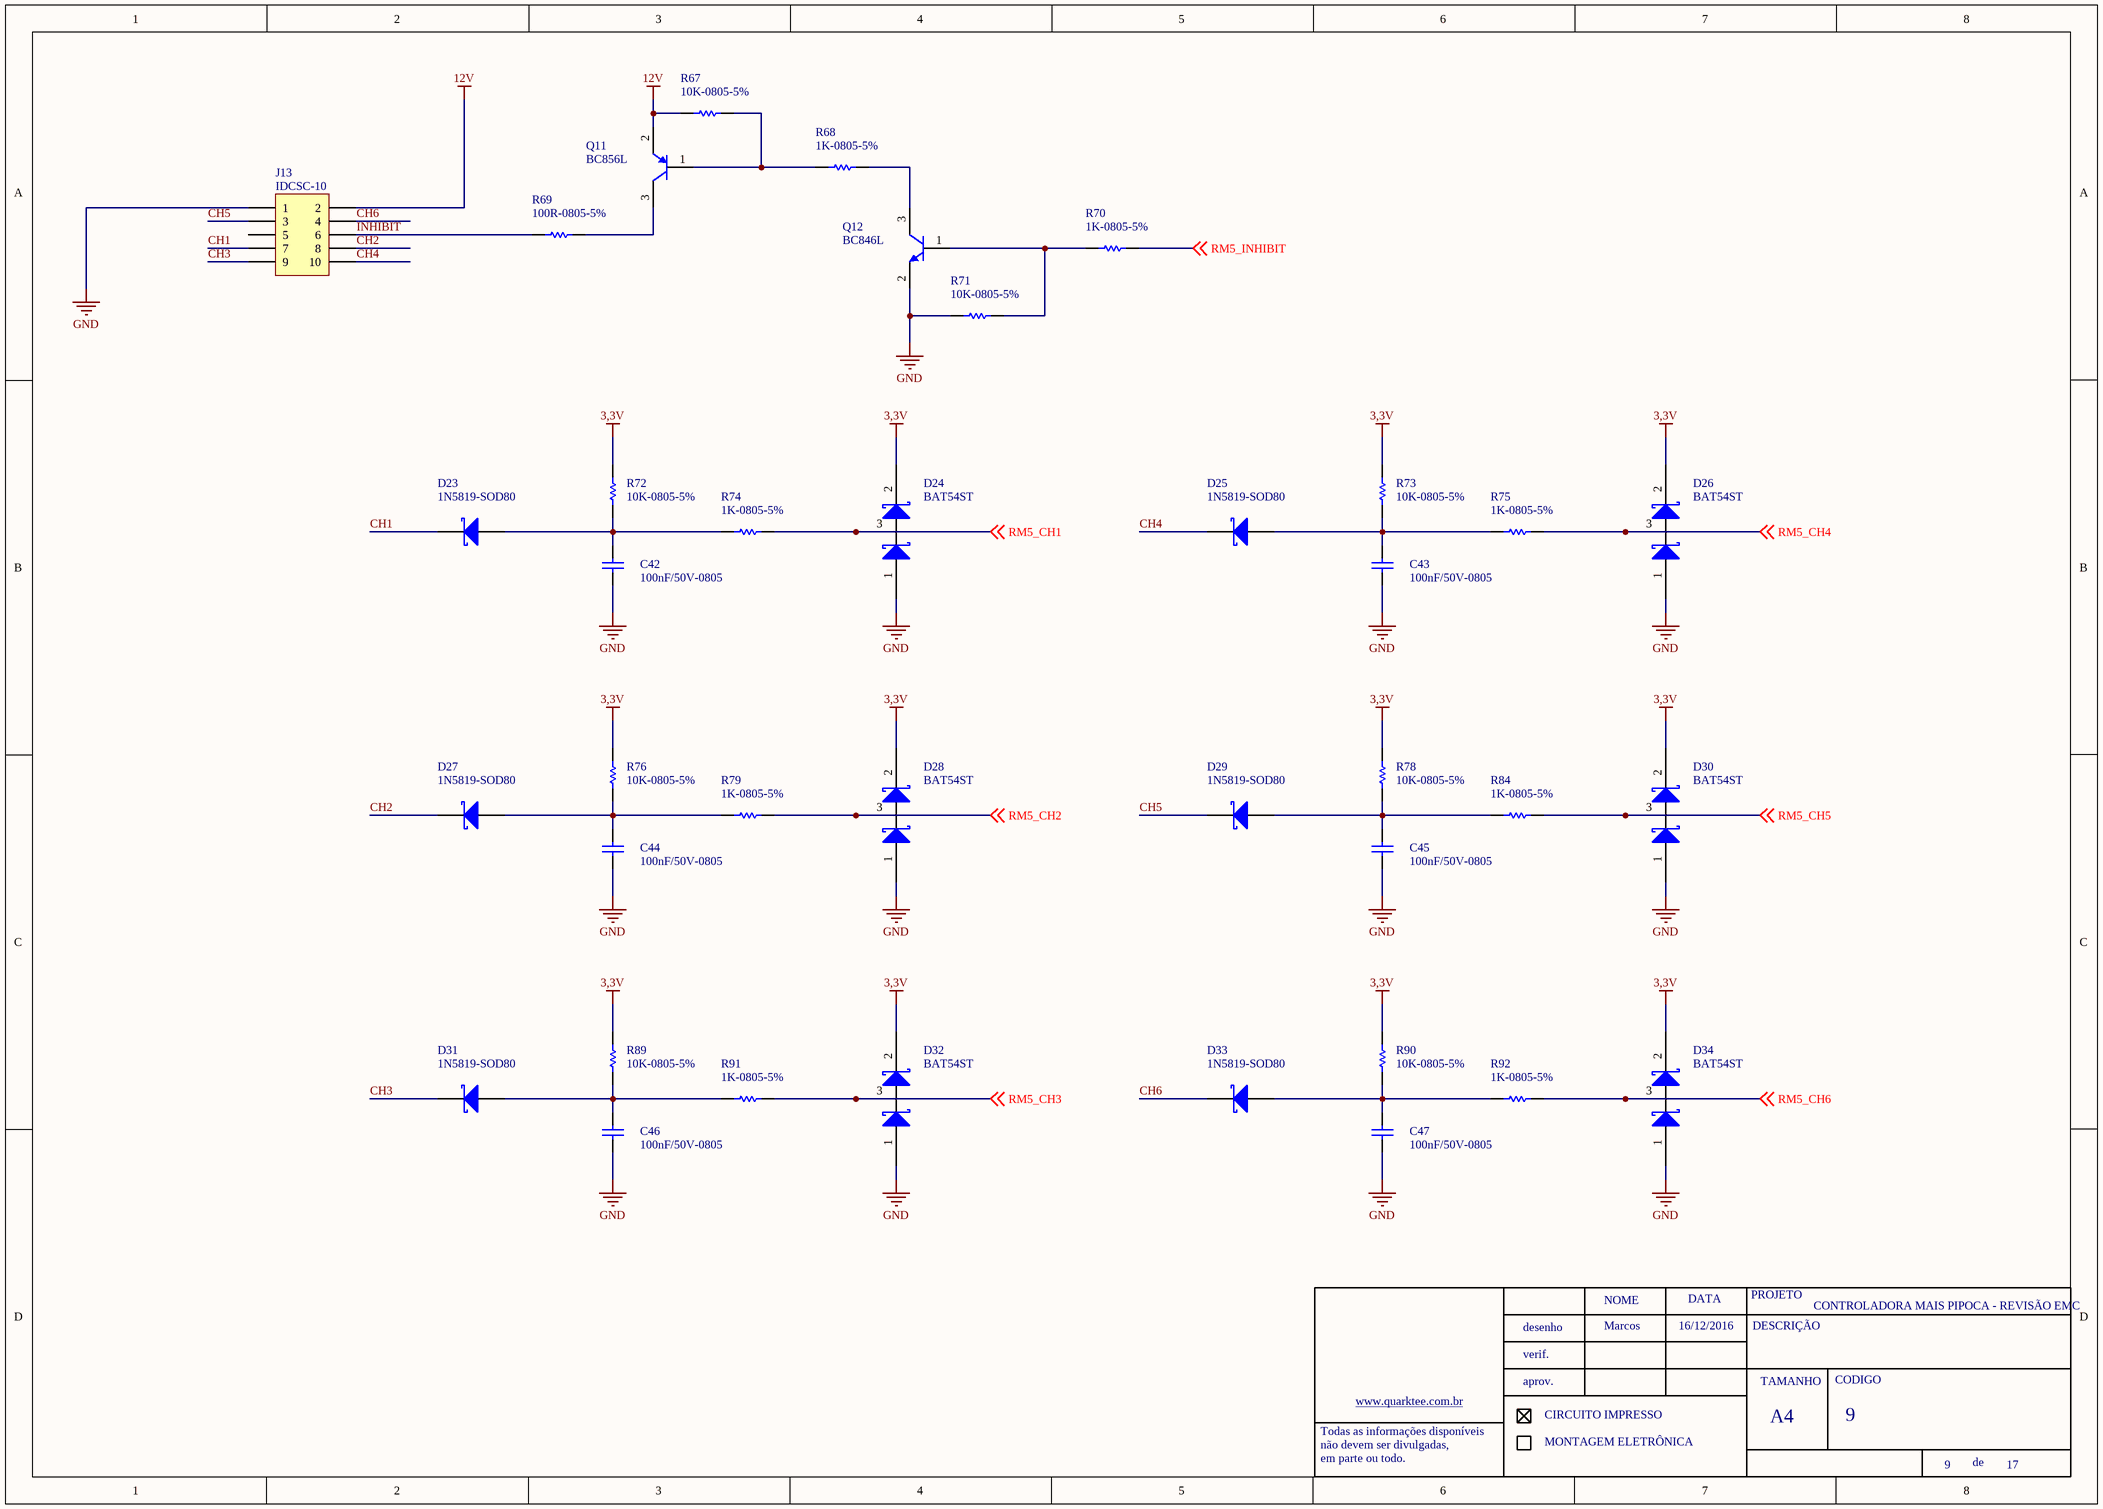
[diagram p8: Entrada_comestero_rm5.SchDoc]

### Parts
C42  100nF/50V-0805  [0805-REVISADO ONDA]
C43  100nF/50V-0805  [0805-REVISADO ONDA]
C44  100nF/50V-0805  [0805-REVISADO ONDA]
C45  100nF/50V-0805  [0805-REVISADO ONDA]
C46  100nF/50V-0805  [0805-REVISADO ONDA]
C47  100nF/50V-0805  [0805-REVISADO ONDA]
D23  1N5819-SOD80  [MINIMLEF/SOD80 - REVISADO ONDA]
D24  BAT54ST  [SOT23 - REVISADO ONDA]
D25  1N5819-SOD80  [MINIMLEF/SOD80 - REVISADO ONDA]
D26  BAT54ST  [SOT23 - REVISADO ONDA]
D27  1N5819-SOD80  [MINIMLEF/SOD80 - REVISADO ONDA]
D28  BAT54ST  [SOT23 - REVISADO ONDA]
D29  1N5819-SOD80  [MINIMLEF/SOD80 - REVISADO ONDA]
D30  BAT54ST  [SOT23 - REVISADO ONDA]
D31  1N5819-SOD80  [MINIMLEF/SOD80 - REVISADO ONDA]
D32  BAT54ST  [SOT23 - REVISADO ONDA]
D33  1N5819-SOD80  [MINIMLEF/SOD80 - REVISADO ONDA]
D34  BAT54ST  [SOT23 - REVISADO ONDA]
J13  IDCSC-10  [IDCSC-10]
Q11  BC856L  [SOT23 - REVISADO ONDA]
Q12  BC846L  [SOT23 - REVISADO ONDA]
R67  10K-0805-5%  [0805-REVISADO ONDA]
R68  1K-0805-5%  [0805-REVISADO ONDA]
R69  100R-0805-5%  [0805-REVISADO ONDA]
R70  1K-0805-5%  [0805-REVISADO ONDA]
R71  10K-0805-5%  [0805-REVISADO ONDA]
R72  10K-0805-5%  [0805-REVISADO ONDA]
R73  10K-0805-5%  [0805-REVISADO ONDA]
R74  1K-0805-5%  [0805-REVISADO ONDA]
R75  1K-0805-5%  [0805-REVISADO ONDA]
R76  10K-0805-5%  [0805-REVISADO ONDA]
R78  10K-0805-5%  [0805-REVISADO ONDA]
R79  1K-0805-5%  [0805-REVISADO ONDA]
R84  1K-0805-5%  [0805-REVISADO ONDA]
R89  10K-0805-5%  [0805-REVISADO ONDA]
R90  10K-0805-5%  [0805-REVISADO ONDA]
R91  1K-0805-5%  [0805-REVISADO ONDA]
R92  1K-0805-5%  [0805-REVISADO ONDA]

### Nets
3,3V: D24.2 D26.2 D28.2 D30.2 D32.2 D34.2 R72.2 R73.2 R76.2 R78.2 R89.2 R90.2
12V: J13.2 Q11.2(E) R67.1
GND: C42.1 C43.1 C44.1 C45.1 C46.1 C47.1 D24.1 D26.1 D28.1 D30.1 D32.1 D34.1 J13.1 Q12.2(E) R71.1
CH1: D23.2(K) J13.7
CH2: D27.2(K) J13.8
CH3: D31.2(K) J13.9
CH4: D25.2(K) J13.10
CH5: D29.2(K) J13.3
CH6: D33.2(K) J13.4
INHIBIT: J13.6 R69.1
RM5_CH1: D24.3 R74.2 ; off-sheet RM5_CH1
RM5_CH2: D28.3 R79.2 ; off-sheet RM5_CH2
RM5_CH3: D32.3 R91.2 ; off-sheet RM5_CH3
RM5_CH4: D26.3 R75.2 ; off-sheet RM5_CH4
RM5_CH5: D30.3 R84.2 ; off-sheet RM5_CH5
RM5_CH6: D34.3 R92.2 ; off-sheet RM5_CH6
RM5_INHIBIT: R70.2 ; off-sheet RM5_INHIBIT
NetC42_2: C42.2 D23.1(A) R72.1 R74.1
NetC43_2: C43.2 D25.1(A) R73.1 R75.1
NetC44_2: C44.2 D27.1(A) R76.1 R79.1
NetC45_2: C45.2 D29.1(A) R78.1 R84.1
NetC46_2: C46.2 D31.1(A) R89.1 R91.1
NetC47_2: C47.2 D33.1(A) R90.1 R92.1
NetQ11_1: Q11.1(B) R67.2 R68.1
NetQ11_3: Q11.3(C) R69.2
NetQ12_1: Q12.1(B) R70.1 R71.2
NetQ12_3: Q12.3(C) R68.2

Not connected (* = marked no-connect by the designer): J13 5

### Notes on the sheet
- Marcos
- 16/12/2016
- NOME
- DATA
- PROJETO
- DESCRIÇÃO
- desenho
- verif.
- aprov.
- TAMANHO
- CODIGO
- Todas as informações disponíveis
- não devem ser divulgadas,
- em parte ou todo.
- www.quarktee.com.br
- CIRCUITO IMPRESSO
- MONTAGEM ELETRÔNICA
- A4
- de

### Library data of the parts
C42-C47 = 100nF/50-0805-NPO: ERP: 104.11.005
D24 D26 D28 D30 D32 D34 = BA54
J13 = IDCSN: CONECTOR HEADER 10 VIAS 90º; ERP: 435.00.009
Q12 = BC846: ERP: 106.22.001
R70 = 100R-0805-5%: ERP: 102.11.031
D23 D25 D27 D29 D31 D33 = 1N5819-SOD80: ERP: 121.18.003
Q11 = BC856L: ERP: 106.22.002
R67 R71-R73 R76 R78 R89 R90 = 10K-0805-5%: ERP: 102.11.054
R68 R74 R75 R79 R84 R91 R92 = 1K-0805-5%: ERP: 102.11.042
R69 = 100R-0805-5%: ERP: 102.11.031

## Sheet IHM.SchDoc: CONTROLADORA MAIS PIPOCA - REVISÃO EMC
size A3; DocumentNumber: 10; SheetNumber: 10; SheetTotal: 17
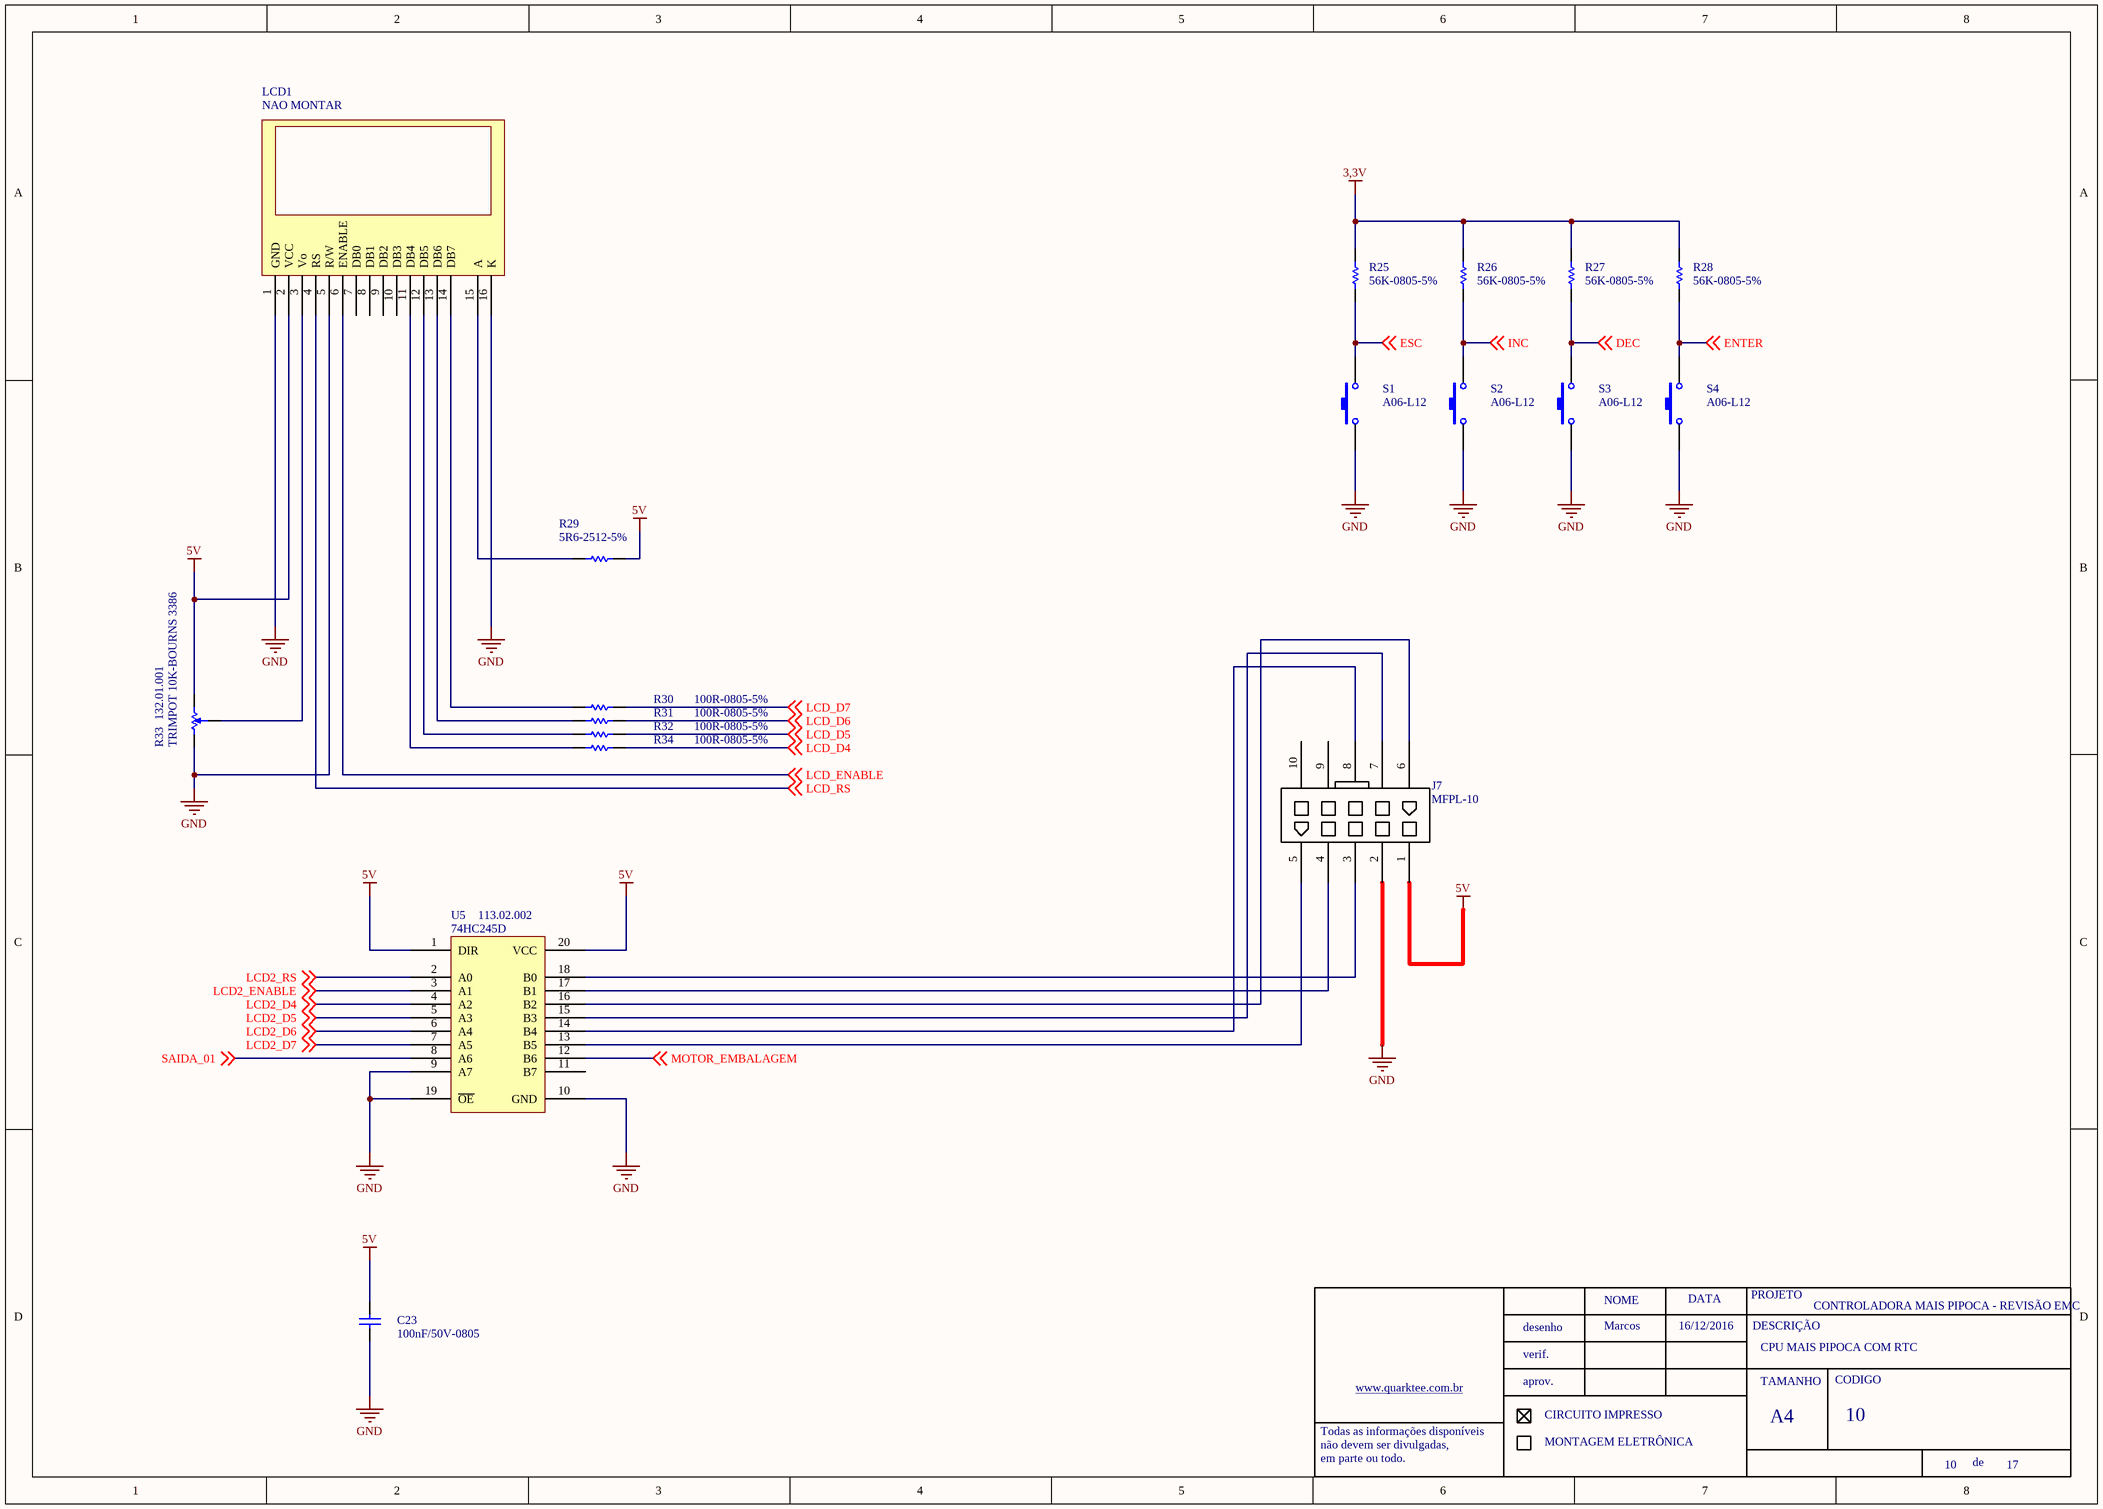
[diagram p9: IHM.SchDoc]

### Parts
C23  100nF/50V-0805  [0805-REVISADO ONDA]
J7  MFPL-10
LCD1  NAO MONTAR  [WH1602B_DS]
R25  56K-0805-5%  [0805-REVISADO ONDA]
R26  56K-0805-5%  [0805-REVISADO ONDA]
R27  56K-0805-5%  [0805-REVISADO ONDA]
R28  56K-0805-5%  [0805-REVISADO ONDA]
R29  5R6-2512-5%  [2512 - REVISADO ONDA]
R30  100R-0805-5%  [0805-REVISADO ONDA]
R31  100R-0805-5%  [0805-REVISADO ONDA]
R32  100R-0805-5%  [0805-REVISADO ONDA]
R33  TRIMPOT 10K-BOURNS 3386  ERP: 132.01.001  [TRIMPOT 3386]
R34  100R-0805-5%  [0805-REVISADO ONDA]
S1  A06-L12  [CHAVE_A06]
S2  A06-L12  [CHAVE_A06]
S3  A06-L12  [CHAVE_A06]
S4  A06-L12  [CHAVE_A06]
U5  74HC245D  ERP: 113.02.002  [SOIC-20]

### Nets
3,3V: R25.1 R26.1 R27.1 R28.1
5V: C23.2 J7.1 LCD1.2(VCC) R29.1 R33.1 U5.1(DIR) U5.20(VCC)
GND: C23.1 J7.2 LCD1.1(GND) LCD1.5(R/W) LCD1.16(K) R33.3 S1.1 S2.1 S3.1 S4.1 U5.9(A7) U5.10(GND) U5.19(~{OE})
DEC: R27.2 S3.2 ; off-sheet DEC
ENTER: R28.2 S4.2 ; off-sheet ENTER
ESC: R25.2 S1.2 ; off-sheet ESC
INC: R26.2 S2.2 ; off-sheet INC
LCD2_D4: U5.4(A2) ; off-sheet LCD2_D4
LCD2_D5: U5.5(A3) ; off-sheet LCD2_D5
LCD2_D6: U5.6(A4) ; off-sheet LCD2_D6
LCD2_D7: U5.7(A5) ; off-sheet LCD2_D7
LCD2_ENABLE: U5.3(A1) ; off-sheet LCD2_ENABLE
LCD2_RS: U5.2(A0) ; off-sheet LCD2_RS
LCD_D4: R34.2 ; off-sheet LCD_D4
LCD_D5: R32.2 ; off-sheet LCD_D5
LCD_D6: R31.2 ; off-sheet LCD_D6
LCD_D7: R30.2 ; off-sheet LCD_D7
LCD_ENABLE: LCD1.6(ENABLE) ; off-sheet LCD_ENABLE
LCD_RS: LCD1.4(RS) ; off-sheet LCD_RS
MOTOR_EMBALAGEM: U5.12(B6) ; off-sheet MOTOR_EMBALAGEM
SAIDA_01: U5.8(A6) ; off-sheet SAIDA_01
NetJ7_3: J7.3 U5.18(B0)
NetJ7_4: J7.4 U5.17(B1)
NetJ7_5: J7.5 U5.13(B5)
NetJ7_6: J7.6 U5.16(B2)
NetJ7_7: J7.7 U5.15(B3)
NetJ7_8: J7.8 U5.14(B4)
NetLCD1_3: LCD1.3(Vo) R33.2
NetLCD1_11: LCD1.11(DB4) R34.1
NetLCD1_12: LCD1.12(DB5) R32.1
NetLCD1_13: LCD1.13(DB6) R31.1
NetLCD1_14: LCD1.14(DB7) R30.1
NetLCD1_15: LCD1.15(A) R29.2

Not connected (* = marked no-connect by the designer): J7 9 10; LCD1 7(DB0) 8(DB1) 9(DB2) 10(DB3); U5 11(B7)

### Notes on the sheet
- Marcos
- 16/12/2016
- CPU MAIS PIPOCA COM RTC
- NOME
- DATA
- PROJETO
- DESCRIÇÃO
- www.quarktee.com.br
- desenho
- verif.
- aprov.
- TAMANHO
- CODIGO
- Todas as informações disponíveis
- não devem ser divulgadas,
- em parte ou todo.
- CIRCUITO IMPRESSO
- MONTAGEM ELETRÔNICA
- A4
- de

### Library data of the parts
C23 = 100nF/50-0805-NPO: ERP: 104.11.005
LCD1 = WH1602A: ERP: 131.00.001
R29 = RES 5R6-CR100: 5R6-CR100; ERP: 103.05.016
R33 = TRIMPOT 3386 50K
R25-R28 = 56K-0805-5%: ERP: 102.11.063
R30-R32 R34 = 100R-0805-5%: ERP: 102.11.031
S1-S4 = A06-L12: ERP: 136.00.001

## Sheet Interface_gratis.SchDoc: CONTROLADORA MAIS PIPOCA - REVISÃO EMC
size A3; DocumentNumber: 11; SheetNumber: 11; SheetTotal: 17
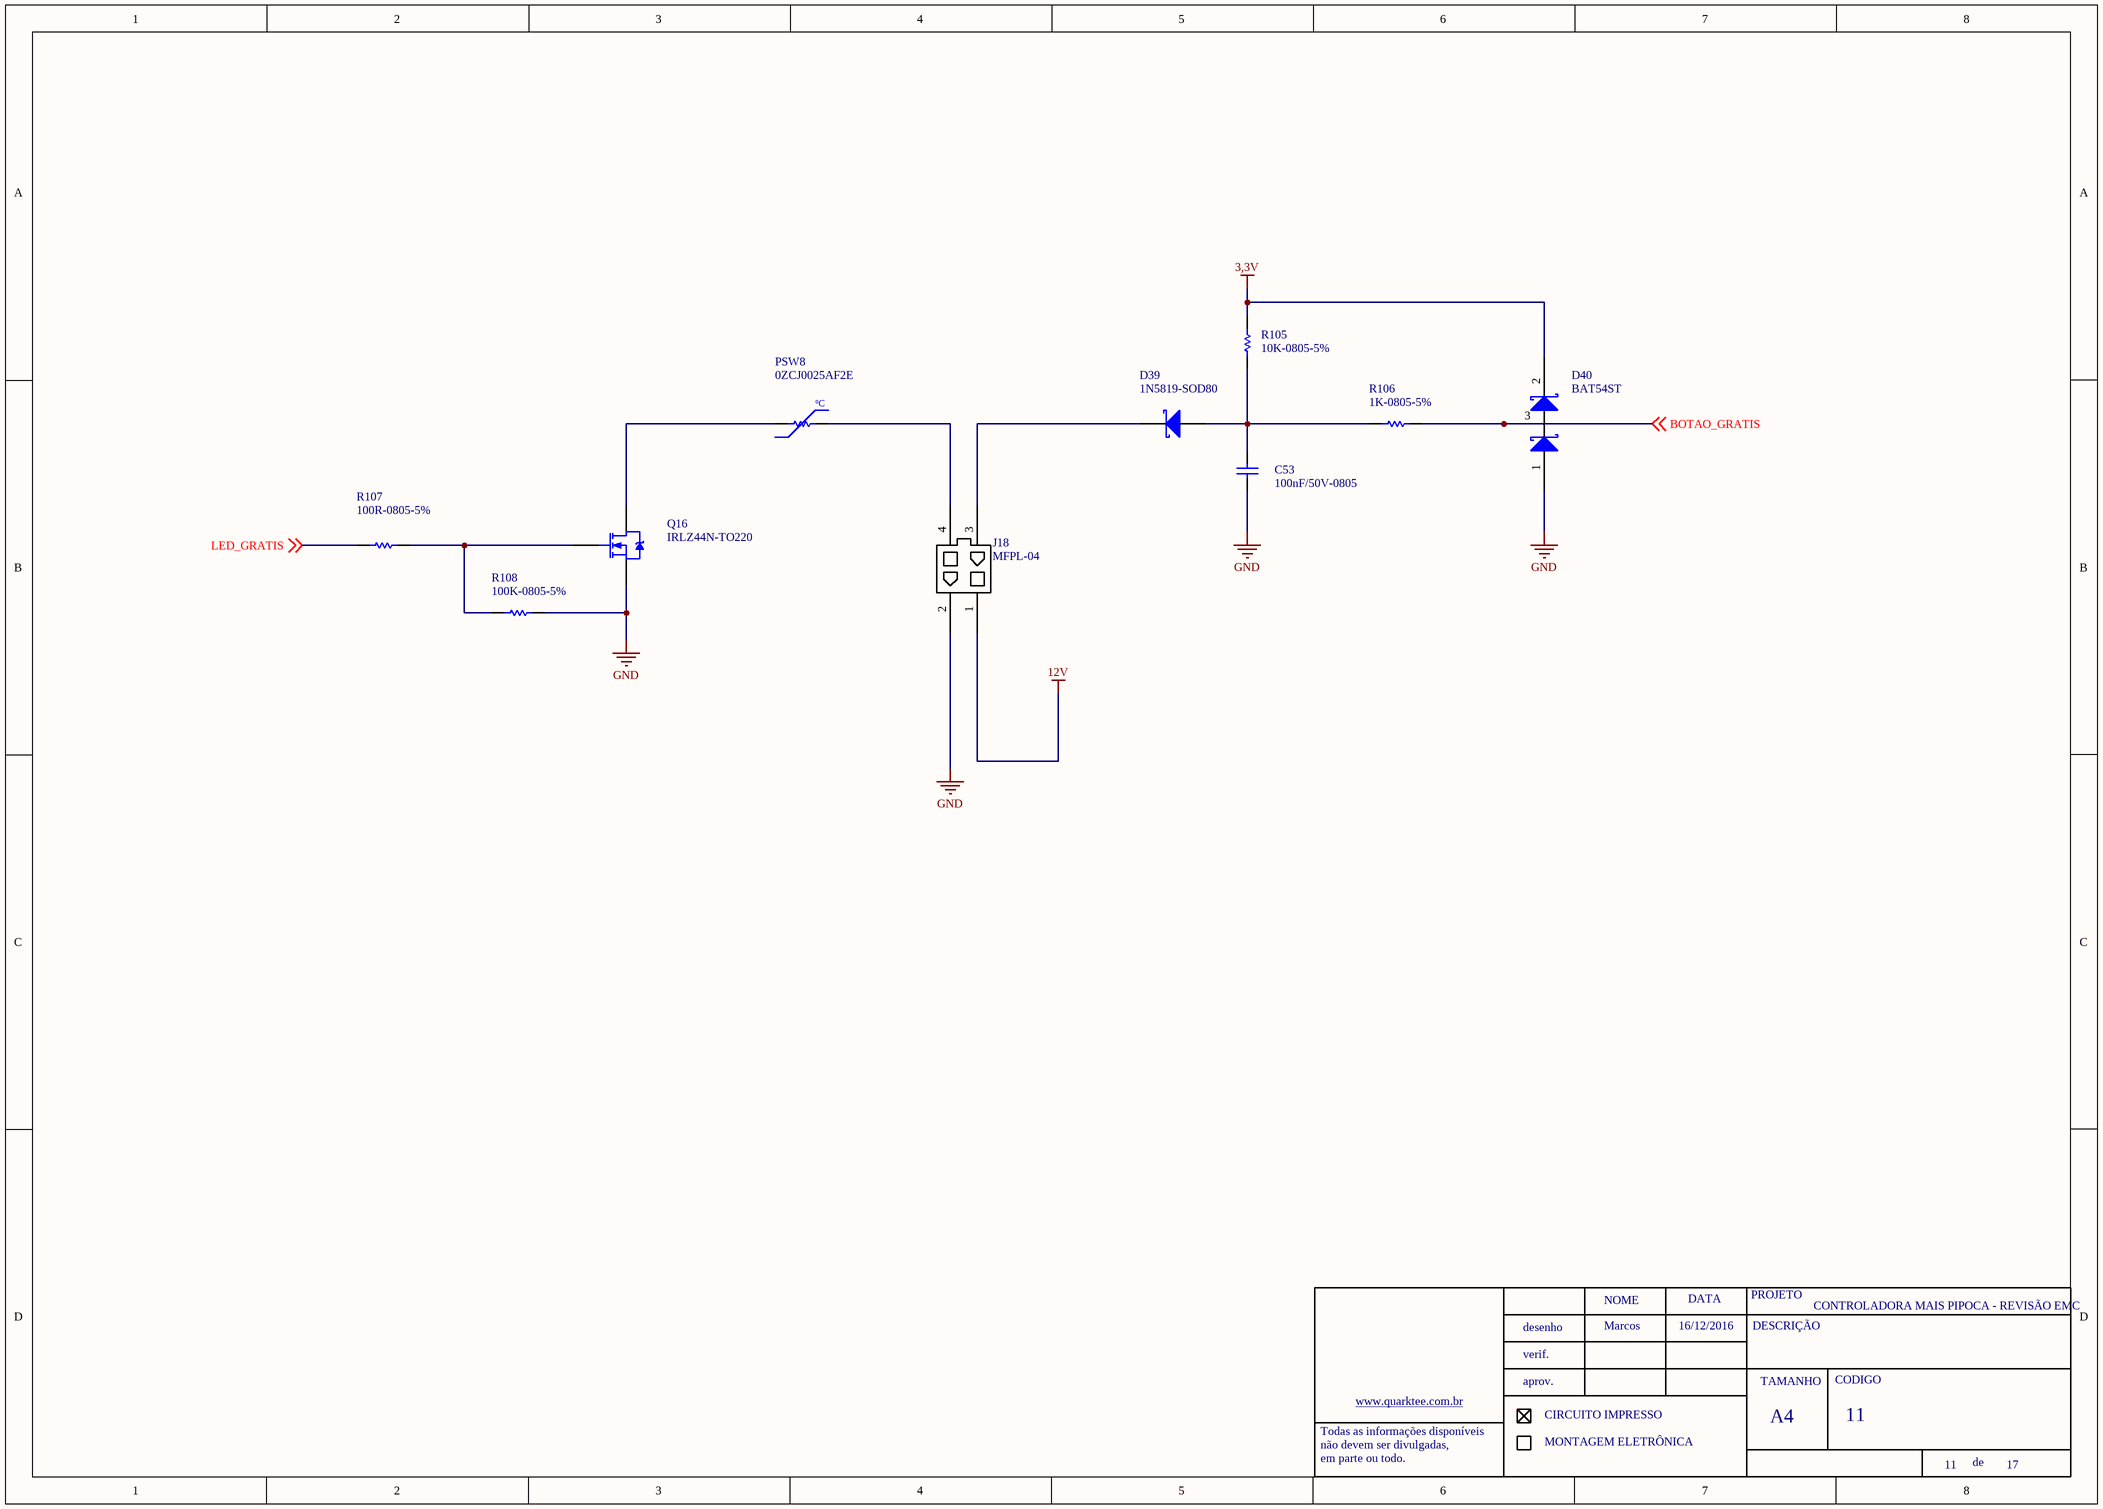
[diagram p10: Interface_gratis.SchDoc]

### Parts
C53  100nF/50V-0805  [0805-REVISADO ONDA]
D39  1N5819-SOD80  [MINIMLEF/SOD80 - REVISADO ONDA]
D40  BAT54ST  [SOT23 - REVISADO ONDA]
J18  MFPL-04
PSW8  0ZCJ0025AF2E  [1206-REVISADO ONDA]
Q16  IRLZ44N-TO220  [TO220-3 EM PÉ]
R105  10K-0805-5%  [0805-REVISADO ONDA]
R106  1K-0805-5%  [0805-REVISADO ONDA]
R107  100R-0805-5%  [0805-REVISADO ONDA]
R108  100K-0805-5%  [0805-REVISADO ONDA]

### Nets
3,3V: D40.2 R105.2
12V: J18.1
GND: C53.1 D40.1 J18.2 Q16.3(S) R108.2
BOTAO_GRATIS: D40.3 R106.2 ; off-sheet BOTAO_GRATIS
LED_GRATIS: R107.1 ; off-sheet LED_GRATIS
NetC53_2: C53.2 D39.1(A) R105.1 R106.1
NetD39_2: D39.2(K) J18.3
NetJ18_4: J18.4 PSW8.2
NetPSW8_1: PSW8.1 Q16.2(D)
NetQ16_1: Q16.1(G) R107.2 R108.1

### Notes on the sheet
- Marcos
- 16/12/2016
- NOME
- DATA
- PROJETO
- DESCRIÇÃO
- desenho
- verif.
- aprov.
- TAMANHO
- CODIGO
- Todas as informações disponíveis
- não devem ser divulgadas,
- em parte ou todo.
- www.quarktee.com.br
- CIRCUITO IMPRESSO
- MONTAGEM ELETRÔNICA
- A4
- de
- (in symbol PTC 2A-120V) ºC

### Library data of the parts
C53 = 100nF/50-0805-NPO: ERP: 104.11.005
PSW8 = PTC 2A-120V
D39 = 1N5819-SOD80: ERP: 121.18.003
Q16 = IRLZ44N-TO220: ERP: 107.01.006
R105 = 10K-0805-5%: ERP: 102.11.054
R106 = 1K-0805-5%: ERP: 102.11.042
R107 = 100R-0805-5%: ERP: 102.11.031
R108 = 100K-0805-5%: ERP: 102.11.066

## Sheet InterfaceConfiguracao.SchDoc: CONTROLADORA MAIS PIPOCA - REVISÃO EMC
size A3; DocumentNumber: 12; SheetNumber: 12; SheetTotal: 17
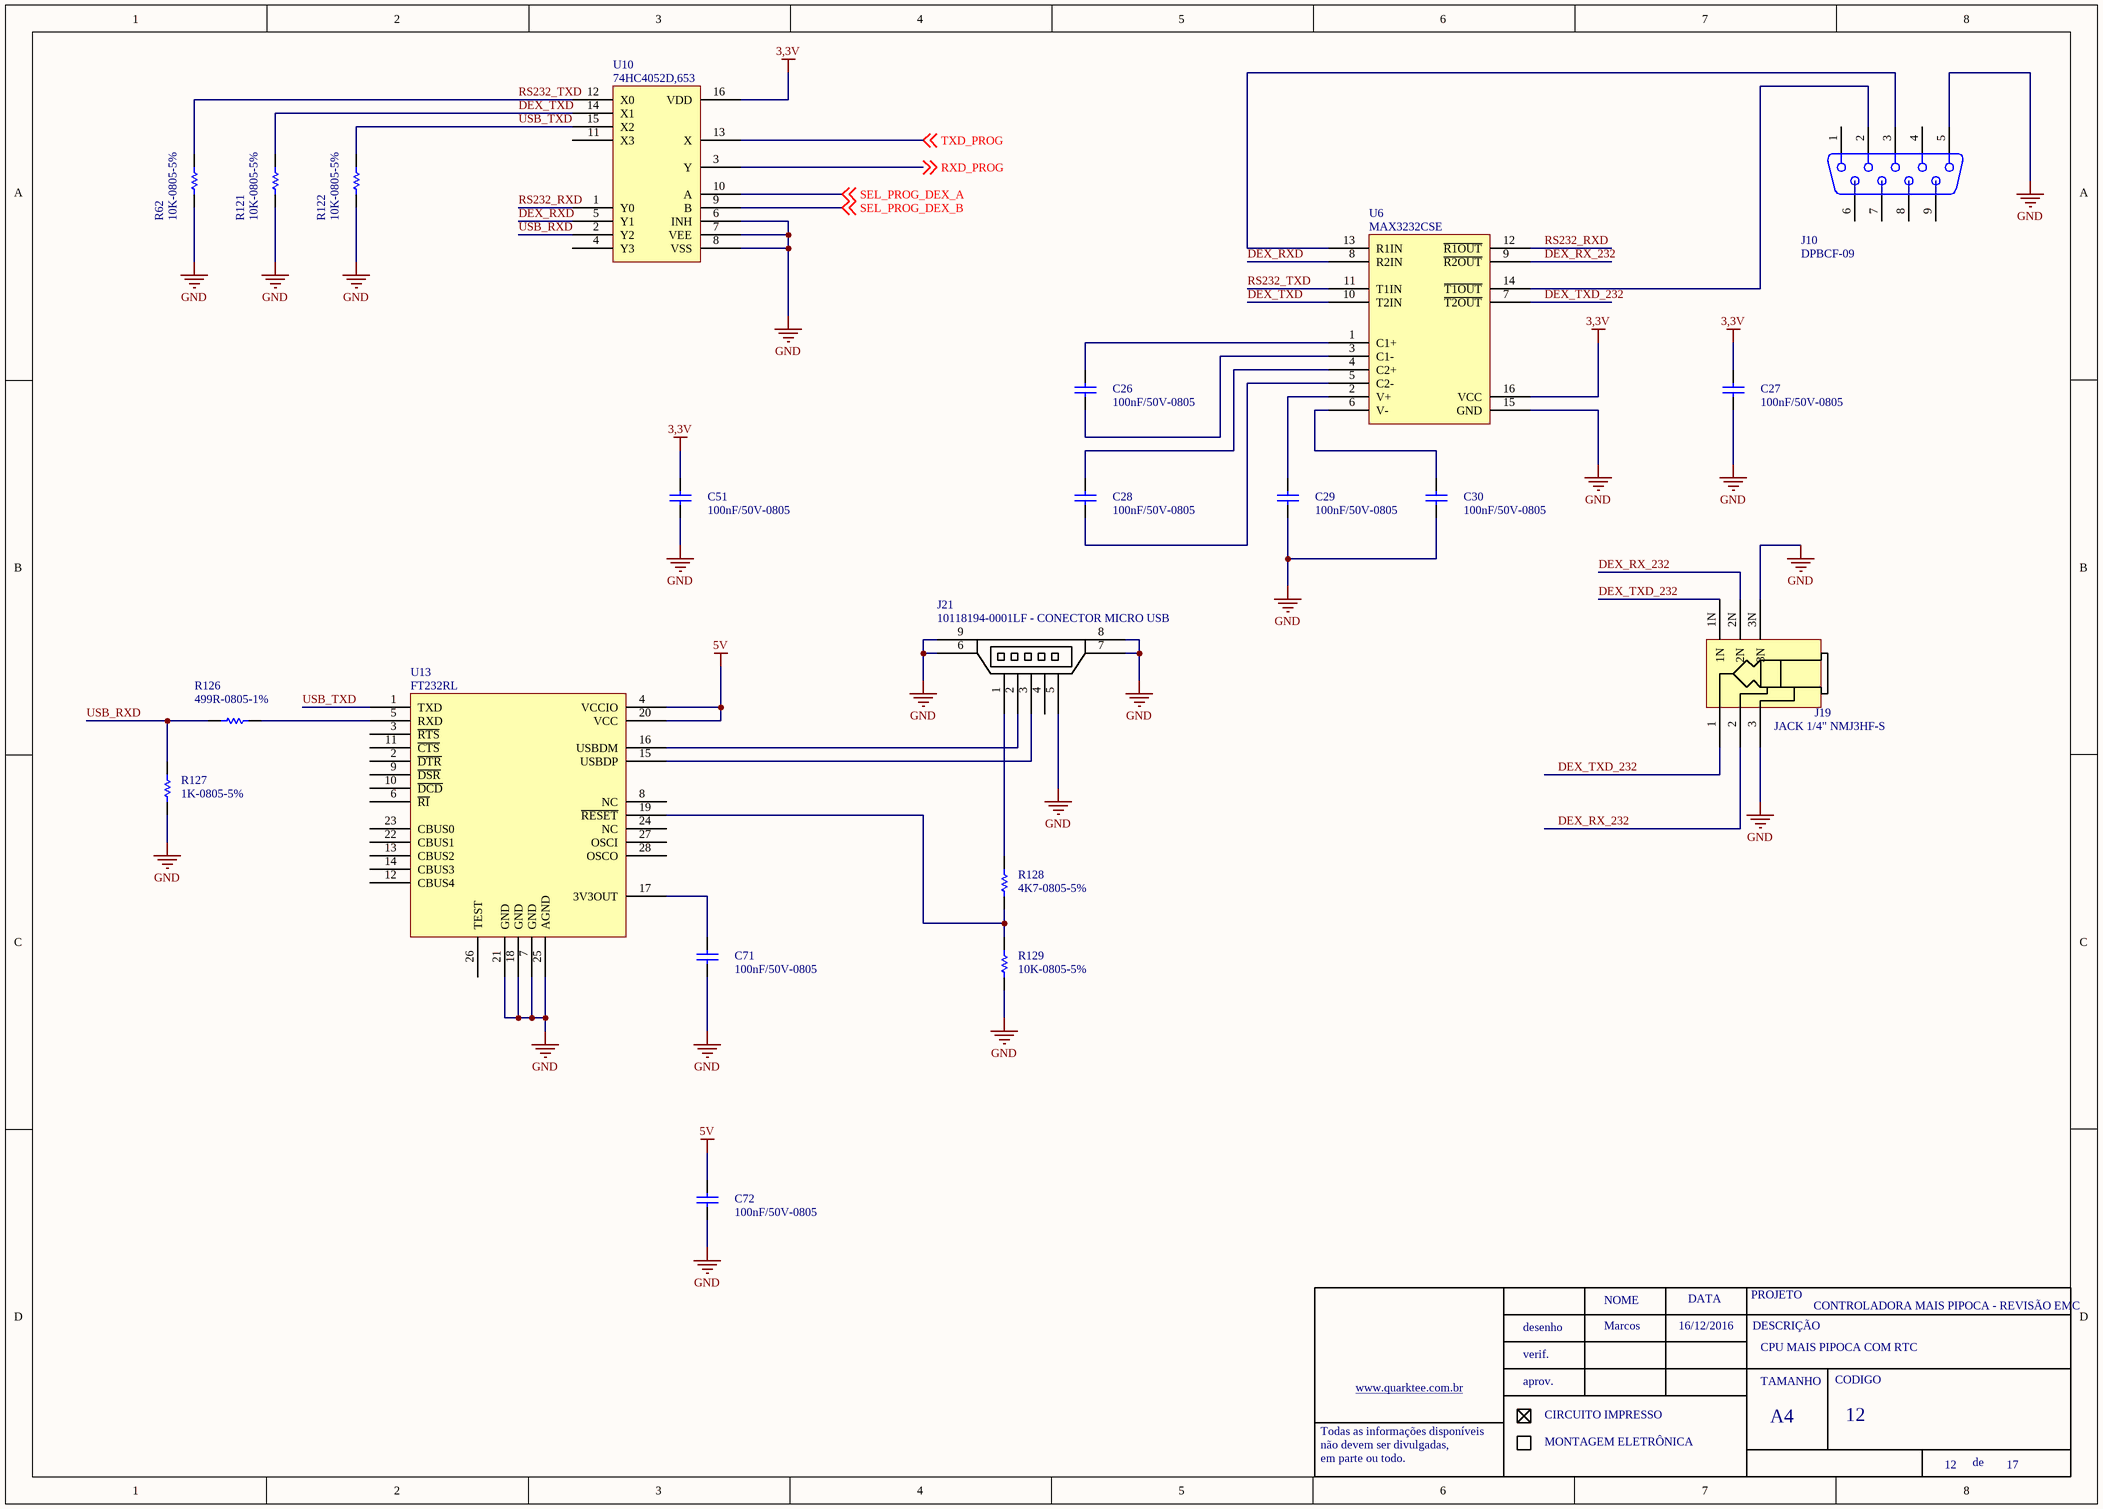
[diagram p11: InterfaceConfiguracao.SchDoc]

### Parts
C26  100nF/50V-0805  [0805-REVISADO ONDA]
C27  100nF/50V-0805  [0805-REVISADO ONDA]
C28  100nF/50V-0805  [0805-REVISADO ONDA]
C29  100nF/50V-0805  [0805-REVISADO ONDA]
C30  100nF/50V-0805  [0805-REVISADO ONDA]
C51  100nF/50V-0805  [0805-REVISADO ONDA]
C71  100nF/50V-0805  [0805-REVISADO ONDA]
C72  100nF/50V-0805  [0805-REVISADO ONDA]
J10  DPBCF-09  [DB9-FÊMEA MONTAGEM EM PCI 180]
J19  JACK 1/4" NMJ3HF-S
J21  10118194-0001LF - CONECTOR MICRO USB
R62  10K-0805-5%  [0805-REVISADO ONDA]
R121  10K-0805-5%  [0805-REVISADO ONDA]
R122  10K-0805-5%  [0805-REVISADO ONDA]
R126  499R-0805-1%  [0805-REVISADO ONDA]
R127  1K-0805-5%  [0805-REVISADO ONDA]
R128  4K7-0805-5%  [0805-REVISADO ONDA]
R129  10K-0805-5%  [0805-REVISADO ONDA]
U6  MAX3232CSE  [SOIC 16 PINOS]
U10  74HC4052D,653
U13  FT232RL

### Nets
3,3V: C27.2 C51.2 U6.16(VCC) U10.16(VDD)
5V: C72.2 U13.4(VCCIO) U13.20(VCC)
GND: C27.1 C29.1 C30.1 C51.1 C71.1 C72.1 J10.5 J19.3 J19.3N J21.5 J21.6 J21.7 J21.8 J21.9 R62.1 R121.1 R122.1 R127.1 R129.1 U6.15(GND) U10.6(INH) U10.7(VEE) U10.8(VSS) U13.7(GND) U13.18(GND) U13.21(GND) U13.25(AGND)
DEX_RX_232: J19.2 J19.2N U6.9(~{R2OUT})
DEX_RXD: U6.8(R2IN) U10.5(Y1)
DEX_TXD: R121.2 U6.10(T2IN) U10.14(X1)
DEX_TXD_232: J19.1 J19.1N U6.7(~{T2OUT})
RS232_RXD: U6.12(~{R1OUT}) U10.1(Y0)
RS232_TXD: R62.2 U6.11(T1IN) U10.12(X0)
RXD_PROG: U10.3(Y) ; off-sheet RXD_PROG
SEL_PROG_DEX_A: U10.10(A) ; off-sheet SEL_PROG_DEX_A
SEL_PROG_DEX_B: U10.9(B) ; off-sheet SEL_PROG_DEX_B
TXD_PROG: U10.13(X) ; off-sheet TXD_PROG
USB_RXD: R126.1 R127.2 U10.2(Y2)
USB_TXD: R122.2 U10.15(X2) U13.1(TXD)
NetC26_1: C26.1 U6.3(C1-)
NetC26_2: C26.2 U6.1(C1+)
NetC28_1: C28.1 U6.5(C2-)
NetC28_2: C28.2 U6.4(C2+)
NetC29_2: C29.2 U6.2(V+)
NetC30_2: C30.2 U6.6(V-)
NetC71_2: C71.2 U13.17(3V3OUT)
NetJ10_2: J10.2 U6.14(~{T1OUT})
NetJ10_3: J10.3 U6.13(R1IN)
NetJ21_1: J21.1 R128.2
NetJ21_2: J21.2 U13.16(USBDM)
NetJ21_3: J21.3 U13.15(USBDP)
NetR126_2: R126.2 U13.5(RXD)
NetR128_1: R128.1 R129.2 U13.19(~{RESET})

Not connected (* = marked no-connect by the designer): J10 1 4 6 7 8 9; J21 4; U10 4(Y3) 11(X3); U13 2(~{DTR}) 3(~{RTS}) 6(~{RI}) 8(NC) 9(~{DSR}) 10(~{DCD}) 11(~{CTS}) 12(CBUS4) 13(CBUS2) 14(CBUS3) 22(CBUS1) 23(CBUS0) 24(NC) 26(TEST) 27(OSCI) 28(OSCO)

### Notes on the sheet
- Marcos
- 16/12/2016
- CPU MAIS PIPOCA COM RTC
- NOME
- DATA
- PROJETO
- DESCRIÇÃO
- www.quarktee.com.br
- desenho
- verif.
- aprov.
- TAMANHO
- CODIGO
- Todas as informações disponíveis
- não devem ser divulgadas,
- em parte ou todo.
- CIRCUITO IMPRESSO
- MONTAGEM ELETRÔNICA
- A4
- de

### Library data of the parts
C26-C30 C51 C71 C72 = 100nF/50-0805-NPO: ERP: 104.11.005
J10 = DB-9 - FÊMEA 180º MONTAGEM EM PCI: DBPCF-09; ERP: 434.00.002
J19 = NMJ3HF-S
J21 = MINI_USB
R126 = 1K-0805-5%: ERP: 102.11.042
R128 = 10K-0805-5%: ERP: 102.11.054
U10 = CD74HC4052PWR
R62 R121 R122 R129 = 10K-0805-5%: ERP: 102.11.054
R127 = 1K-0805-5%: ERP: 102.11.042
U6 = MAX3232CSE: ERP: 110.02.001

## Sheet JTAG.SchDoc: CONTROLADORA MAIS PIPOCA - REVISÃO EMC
size A3; DocumentNumber: 13; SheetNumber: 13; SheetTotal: 17
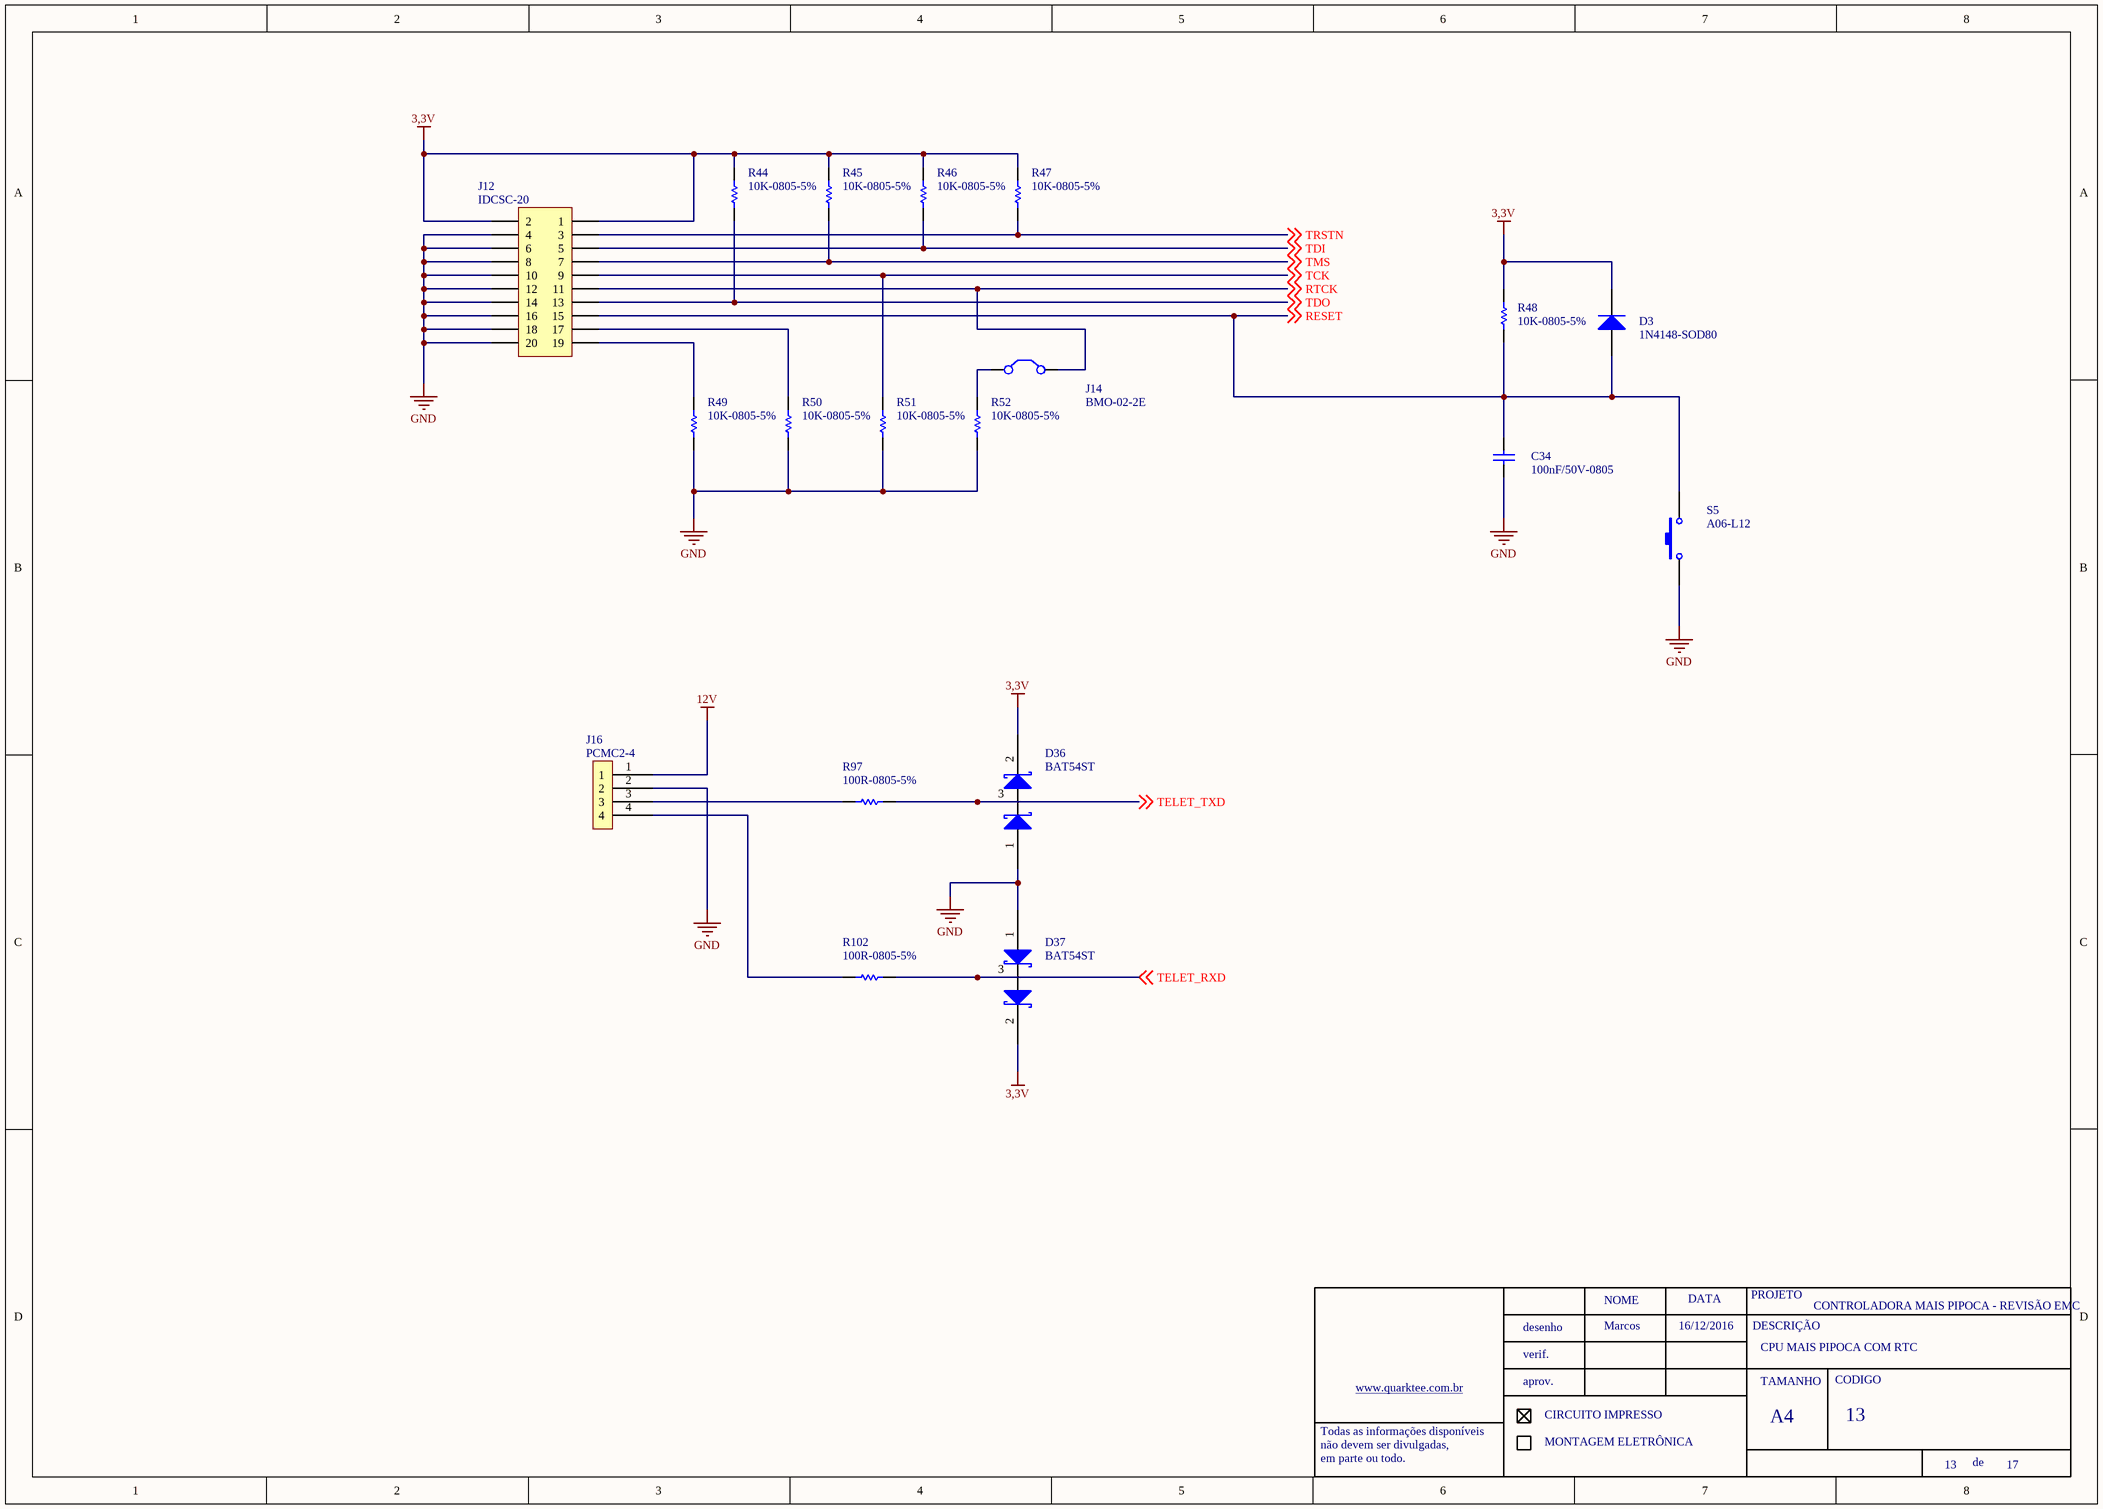
[diagram p12: JTAG.SchDoc]

### Parts
C34  100nF/50V-0805  [0805-REVISADO ONDA]
D3  1N4148-SOD80  [MINIMLEF/SOD80 - REVISADO ONDA]
D36  BAT54ST  [SOT23 - REVISADO ONDA]
D37  BAT54ST  [SOT23 - REVISADO ONDA]
J12  IDCSC-20  [IDCSC-20]
J14  BMO-02-2E  [JUMPER100]
J16  PCMC2-4  [PHMC4-04]
R44  10K-0805-5%  [0805-REVISADO ONDA]
R45  10K-0805-5%  [0805-REVISADO ONDA]
R46  10K-0805-5%  [0805-REVISADO ONDA]
R47  10K-0805-5%  [0805-REVISADO ONDA]
R48  10K-0805-5%  [0805-REVISADO ONDA]
R49  10K-0805-5%  [0805-REVISADO ONDA]
R50  10K-0805-5%  [0805-REVISADO ONDA]
R51  10K-0805-5%  [0805-REVISADO ONDA]
R52  10K-0805-5%  [0805-REVISADO ONDA]
R97  100R-0805-5%  [0805-REVISADO ONDA]
R102  100R-0805-5%  [0805-REVISADO ONDA]
S5  A06-L12  [CHAVE_A06]

### Nets
3,3V: D3.2 D36.2 D37.2 J12.1 J12.2 R44.1 R45.1 R46.1 R47.1 R48.2
12V: J16.1
GND: C34.1 D36.1 D37.1 J12.4 J12.6 J12.8 J12.10 J12.12 J12.14 J12.16 J12.18 J12.20 J16.2 R49.2 R50.2 R51.2 R52.2 S5.1
RESET: C34.2 D3.1 J12.15 R48.1 S5.2 ; off-sheet RESET
RTCK: J12.11 J14.2(C2) ; off-sheet RTCK
TCK: J12.9 R51.1 ; off-sheet TCK
TDI: J12.5 R46.2 ; off-sheet TDI
TDO: J12.13 R44.2 ; off-sheet TDO
TELET_RXD: D37.3 R102.2 ; off-sheet TELET_RXD
TELET_TXD: D36.3 R97.2 ; off-sheet TELET_TXD
TMS: J12.7 R45.2 ; off-sheet TMS
TRSTN: J12.3 R47.2 ; off-sheet TRSTN
NetJ12_17: J12.17 R50.1
NetJ12_19: J12.19 R49.1
NetJ14_1: J14.1(C1) R52.1
NetJ16_3: J16.3 R97.1
NetJ16_4: J16.4 R102.1

### Notes on the sheet
- Marcos
- 16/12/2016
- CPU MAIS PIPOCA COM RTC
- NOME
- DATA
- PROJETO
- DESCRIÇÃO
- www.quarktee.com.br
- desenho
- verif.
- aprov.
- TAMANHO
- CODIGO
- Todas as informações disponíveis
- não devem ser divulgadas,
- em parte ou todo.
- CIRCUITO IMPRESSO
- MONTAGEM ELETRÔNICA
- A4
- de

### Library data of the parts
C34 = 100nF/50-0805-NPO: ERP: 104.11.005
J12 = HEADER 10x2: BARRA DE PINOS 10x2 VIAS; ERP: 10 x 434.00.060
J14 = BARRA DE PINOS: ERP: 434.00.060
R44-R47 R49-R52 = RES 10K-0805: ERP: 103.03.054
D3 = 1N4148-SOD80: ERP: 120.19.001
R48 = 10K-0805-5%: ERP: 102.11.054
R97 R102 = 100R-0805-5%: ERP: 102.11.031
S5 = A06-L12: ERP: 136.00.001

## Sheet Meios_pagamento.SchDoc: CONTROLADORA MAIS PIPOCA - REVISÃO EMC
size A3; DocumentNumber: 14; SheetNumber: 14; SheetTotal: 17
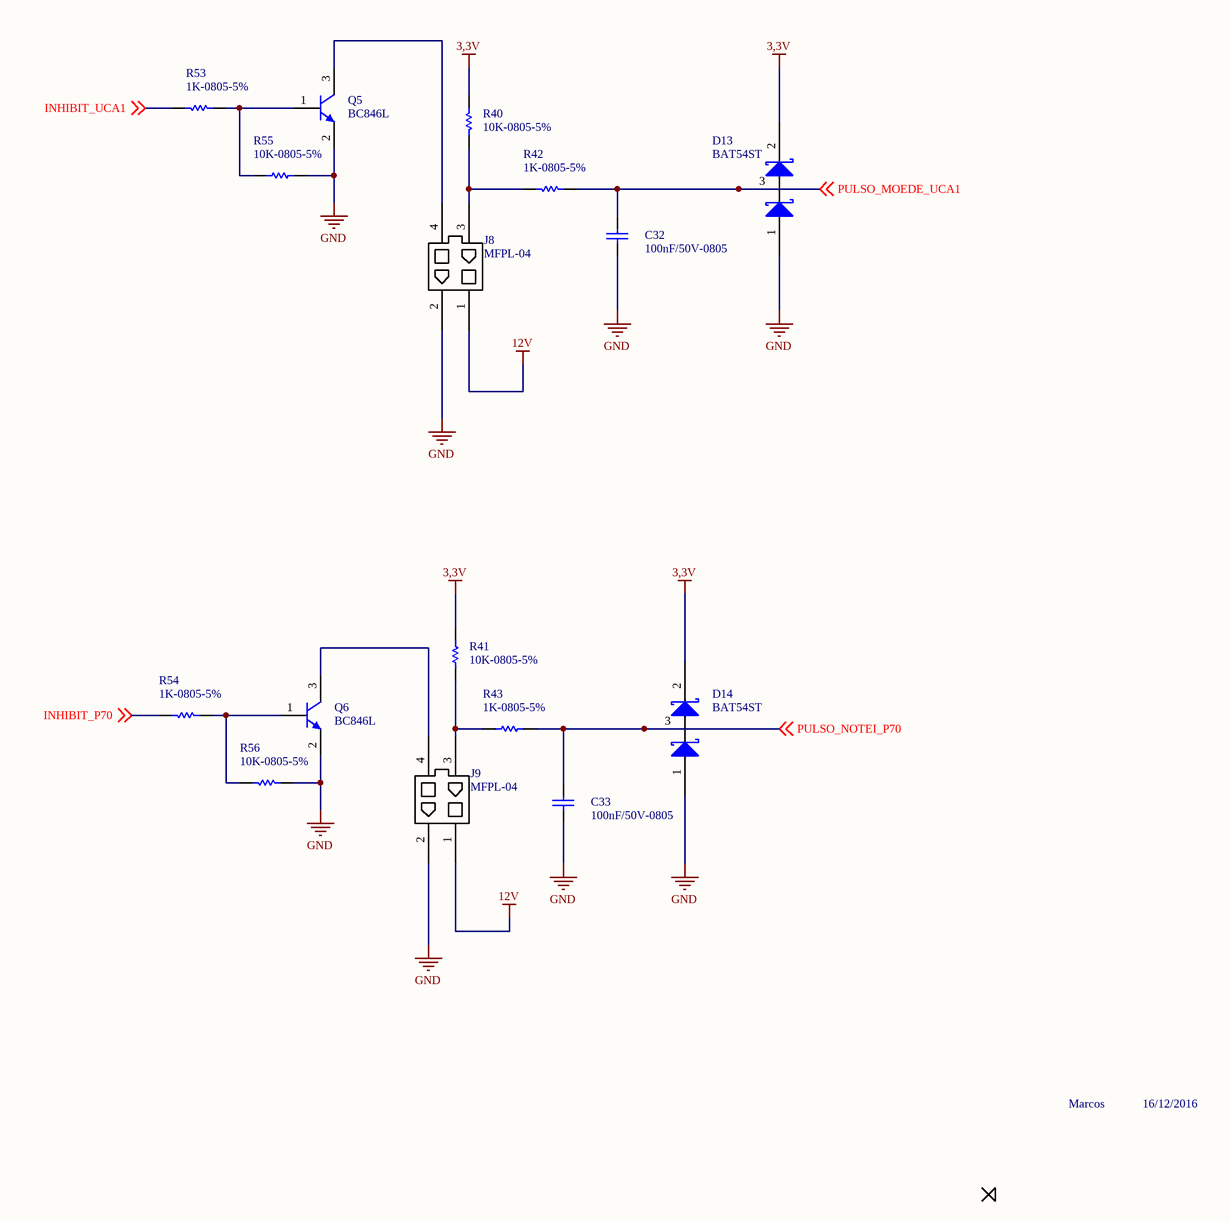
[diagram p13: Meios_pagamento.SchDoc]

### Parts
C32  100nF/50V-0805  [0805-REVISADO ONDA]
C33  100nF/50V-0805  [0805-REVISADO ONDA]
D13  BAT54ST  [SOT23 - REVISADO ONDA]
D14  BAT54ST  [SOT23 - REVISADO ONDA]
J8  MFPL-04
J9  MFPL-04
Q5  BC846L  [SOT23 - REVISADO ONDA]
Q6  BC846L  [SOT23 - REVISADO ONDA]
R40  10K-0805-5%  [0805-REVISADO ONDA]
R41  10K-0805-5%  [0805-REVISADO ONDA]
R42  1K-0805-5%  [0805-REVISADO ONDA]
R43  1K-0805-5%  [0805-REVISADO ONDA]
R53  1K-0805-5%  [0805-REVISADO ONDA]
R54  1K-0805-5%  [0805-REVISADO ONDA]
R55  10K-0805-5%  [0805-REVISADO ONDA]
R56  10K-0805-5%  [0805-REVISADO ONDA]

### Nets
3,3V: D13.2 D14.2 R40.2 R41.2
12V: J8.1 J9.1
GND: C32.1 C33.1 D13.1 D14.1 J8.2 J9.2 Q5.2(E) Q6.2(E) R55.2 R56.1
INHIBIT_P70: R54.2 ; off-sheet INHIBIT_P70
INHIBIT_UCA1: R53.2 ; off-sheet INHIBIT_UCA1
PULSO_MOEDE_UCA1: C32.2 D13.3 R42.1 ; off-sheet PULSO_MOEDE_UCA1
PULSO_NOTEI_P70: C33.2 D14.3 R43.2 ; off-sheet PULSO_NOTEI_P70
NetJ8_3: J8.3 R40.1 R42.2
NetJ8_4: J8.4 Q5.3(C)
NetJ9_3: J9.3 R41.1 R43.1
NetJ9_4: J9.4 Q6.3(C)
NetQ5_1: Q5.1(B) R53.1 R55.1
NetQ6_1: Q6.1(B) R54.1 R56.2

### Notes on the sheet
- Marcos
- 16/12/2016
- NOME
- DATA
- PROJETO
- DESCRIÇÃO
- desenho
- verif.
- aprov.
- TAMANHO
- CODIGO
- Todas as informações disponíveis
- não devem ser divulgadas,
- em parte ou todo.
- www.quarktee.com.br
- CIRCUITO IMPRESSO
- MONTAGEM ELETRÔNICA
- A4
- de

### Library data of the parts
C32 C33 = 100nF/50-0805-NPO: ERP: 104.11.005
Q5 Q6 = BC846: ERP: 106.22.001
R40 R41 R55 R56 = 10K-0805-5%: ERP: 102.11.054
R42 R43 R53 R54 = 1K-0805-5%: ERP: 102.11.042

## Sheet Memoria.SchDoc: CONTROLADORA MAIS PIPOCA - REVISÃO EMC
size A3; DocumentNumber: 15; SheetNumber: 15; SheetTotal: 17
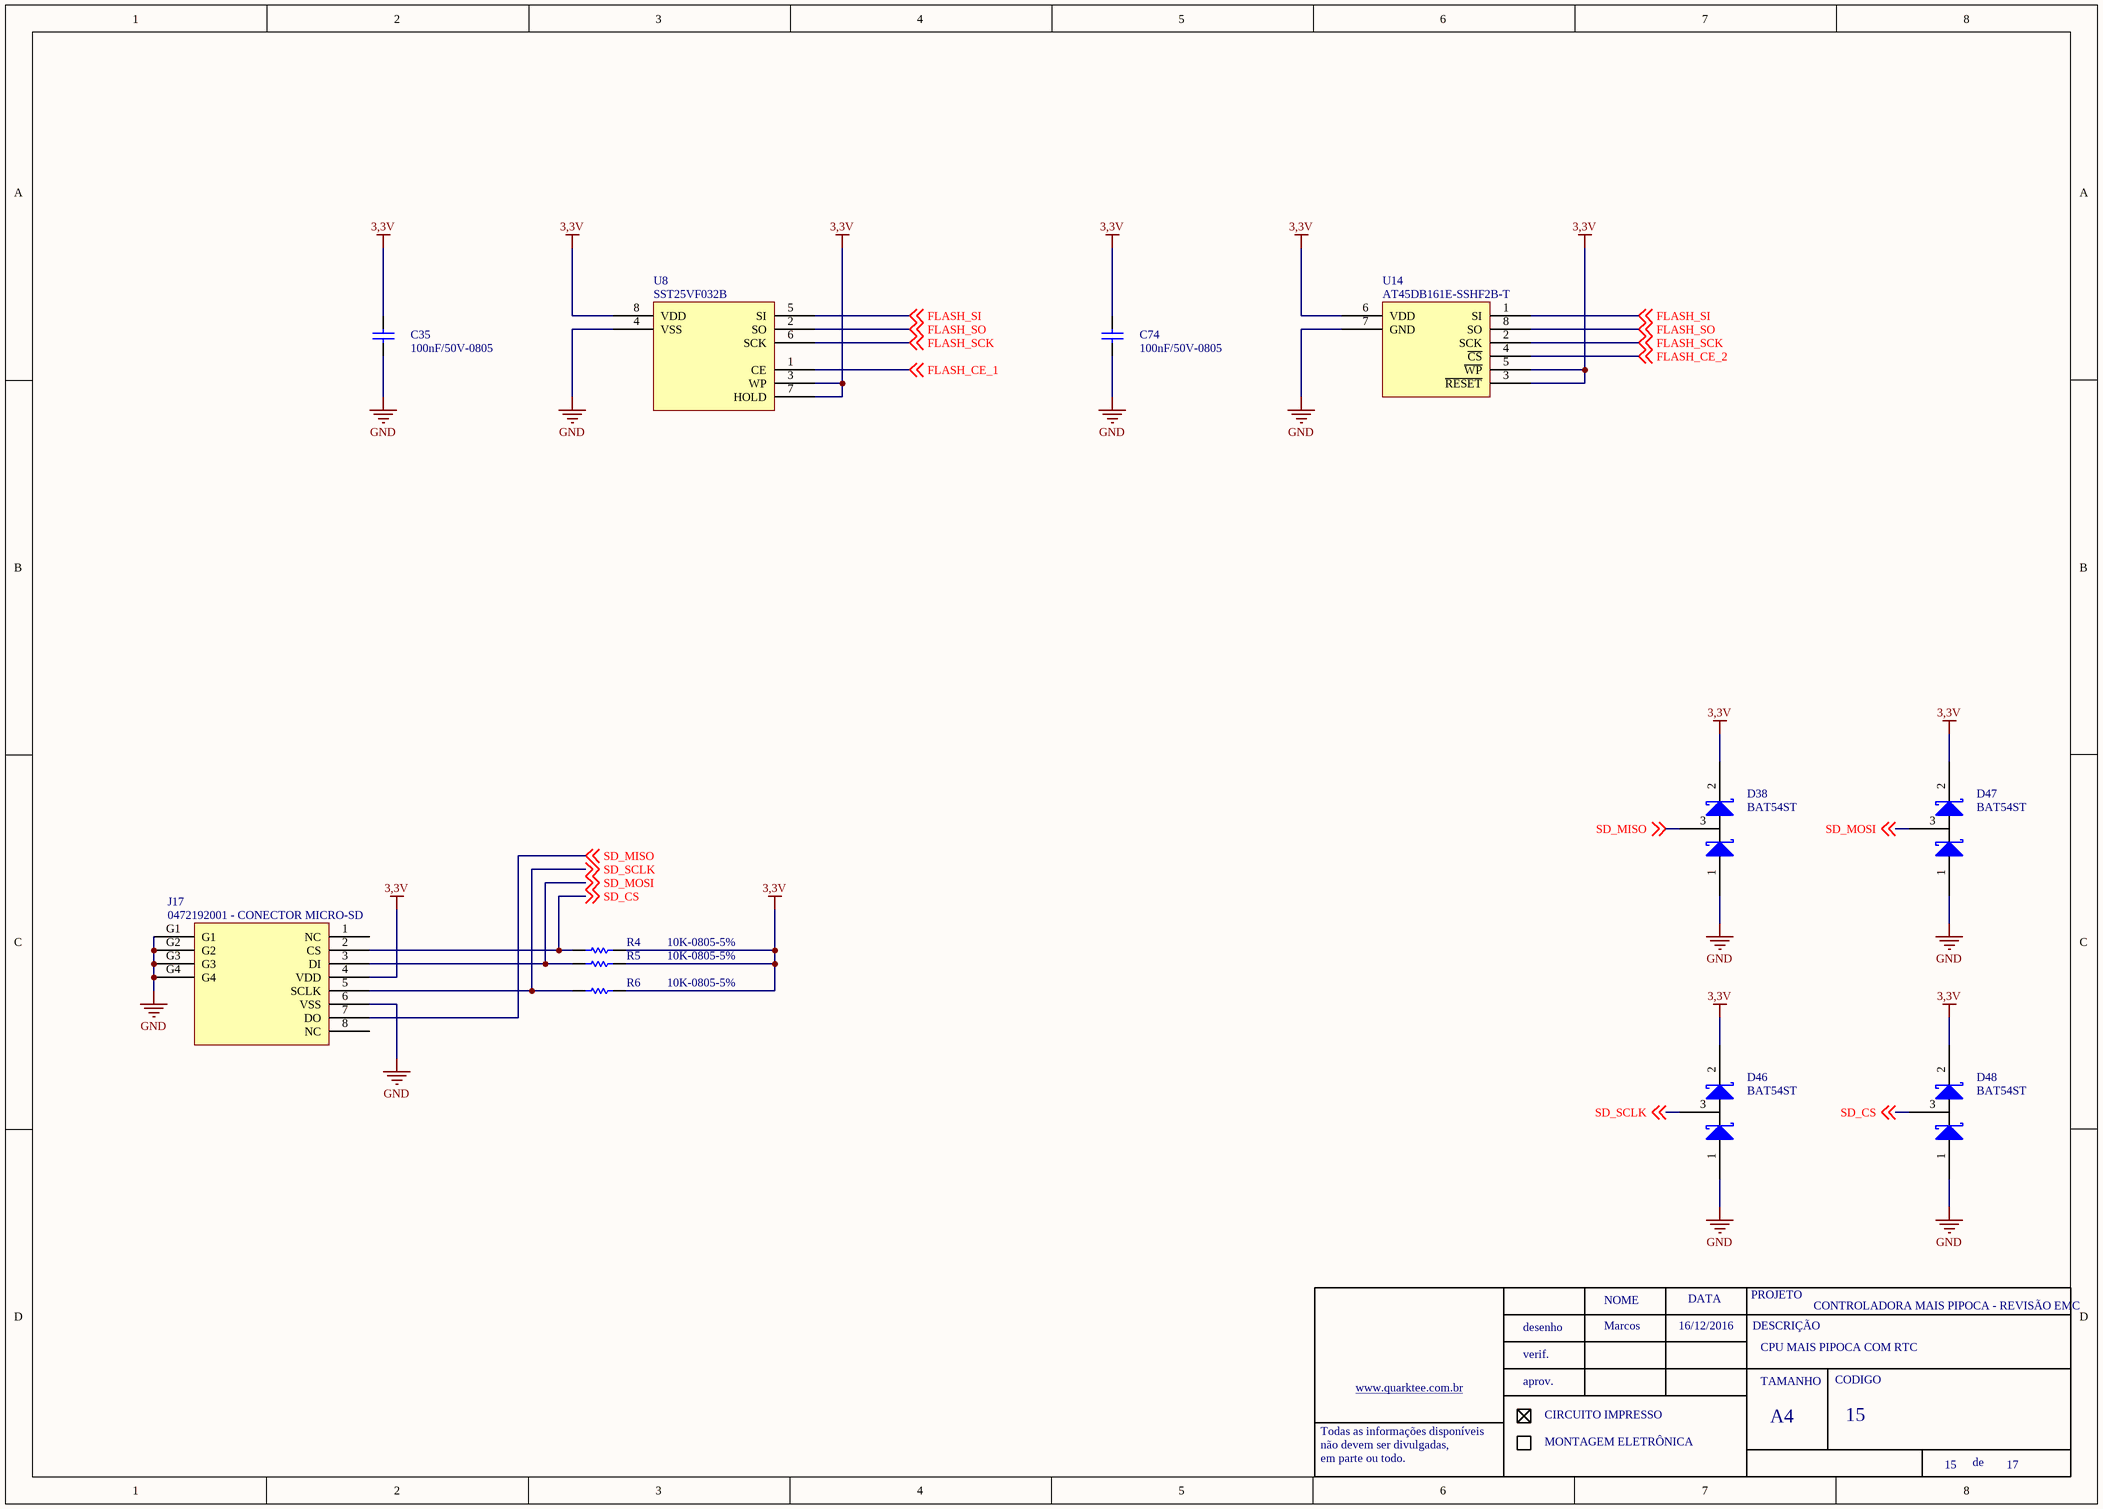
[diagram p14: Memoria.SchDoc]

### Parts
C35  100nF/50V-0805  [0805-REVISADO ONDA]
C74  100nF/50V-0805  [0805-REVISADO ONDA]
D38  BAT54ST  [SOT23 - REVISADO ONDA]
D46  BAT54ST  [SOT23 - REVISADO ONDA]
D47  BAT54ST  [SOT23 - REVISADO ONDA]
D48  BAT54ST  [SOT23 - REVISADO ONDA]
J17  0472192001 - CONECTOR MICRO-SD
R4  10K-0805-5%  [0805-REVISADO ONDA]
R5  10K-0805-5%  [0805-REVISADO ONDA]
R6  10K-0805-5%  [0805-REVISADO ONDA]
U8  SST25VF032B  [SOIC LARGO ATMEL]
U14  AT45DB161E-SSHF2B-T

### Nets
3,3V: C35.2 C74.2 D38.2 D46.2 D47.2 D48.2 J17.4(VDD) R4.1 R5.1 R6.1 U8.3(WP) U8.7(HOLD) U8.8(VDD) U14.3(~{RESET}) U14.5(~{WP}) U14.6(VDD)
GND: C35.1 C74.1 D38.1 D46.1 D47.1 D48.1 J17.6(VSS) J17.G1 J17.G2 J17.G3 J17.G4 U8.4(VSS) U14.7(GND)
FLASH_CE_1: U8.1(CE) ; off-sheet FLASH_CE_1
FLASH_CE_2: U14.4(~{CS}) ; off-sheet FLASH_CE_2
FLASH_SCK: U8.6(SCK) U14.2(SCK) ; off-sheet FLASH_SCK
FLASH_SI: U8.5(SI) U14.1(SI) ; off-sheet FLASH_SI
FLASH_SO: U8.2(SO) U14.8(SO) ; off-sheet FLASH_SO
SD_CS: D48.3 J17.2(CS) R4.2 ; off-sheet SD_CS
SD_MISO: D38.3 J17.7(DO) ; off-sheet SD_MISO
SD_MOSI: D47.3 J17.3(DI) R5.2 ; off-sheet SD_MOSI
SD_SCLK: D46.3 J17.5(SCLK) R6.2 ; off-sheet SD_SCLK

Not connected (* = marked no-connect by the designer): J17 1(NC) 8(NC)

### Notes on the sheet
- Marcos
- 16/12/2016
- CPU MAIS PIPOCA COM RTC
- NOME
- DATA
- PROJETO
- DESCRIÇÃO
- www.quarktee.com.br
- desenho
- verif.
- aprov.
- TAMANHO
- CODIGO
- Todas as informações disponíveis
- não devem ser divulgadas,
- em parte ou todo.
- CIRCUITO IMPRESSO
- MONTAGEM ELETRÔNICA
- A4
- de

### Library data of the parts
C35 C74 = 100nF/50-0805-NPO: ERP: 104.11.005
J17 = CONECTOR MICRO-SD
U8 = SST25VF032B: ERP: FALTA CADASTRAR
R4-R6 = 10K-0805-5%: ERP: 102.11.054

## Sheet Porta_MDB.SchDoc: CONTROLADORA MAIS PIPOCA - REVISÃO EMC
size A3; DocumentNumber: 16; SheetNumber: 16; SheetTotal: 17
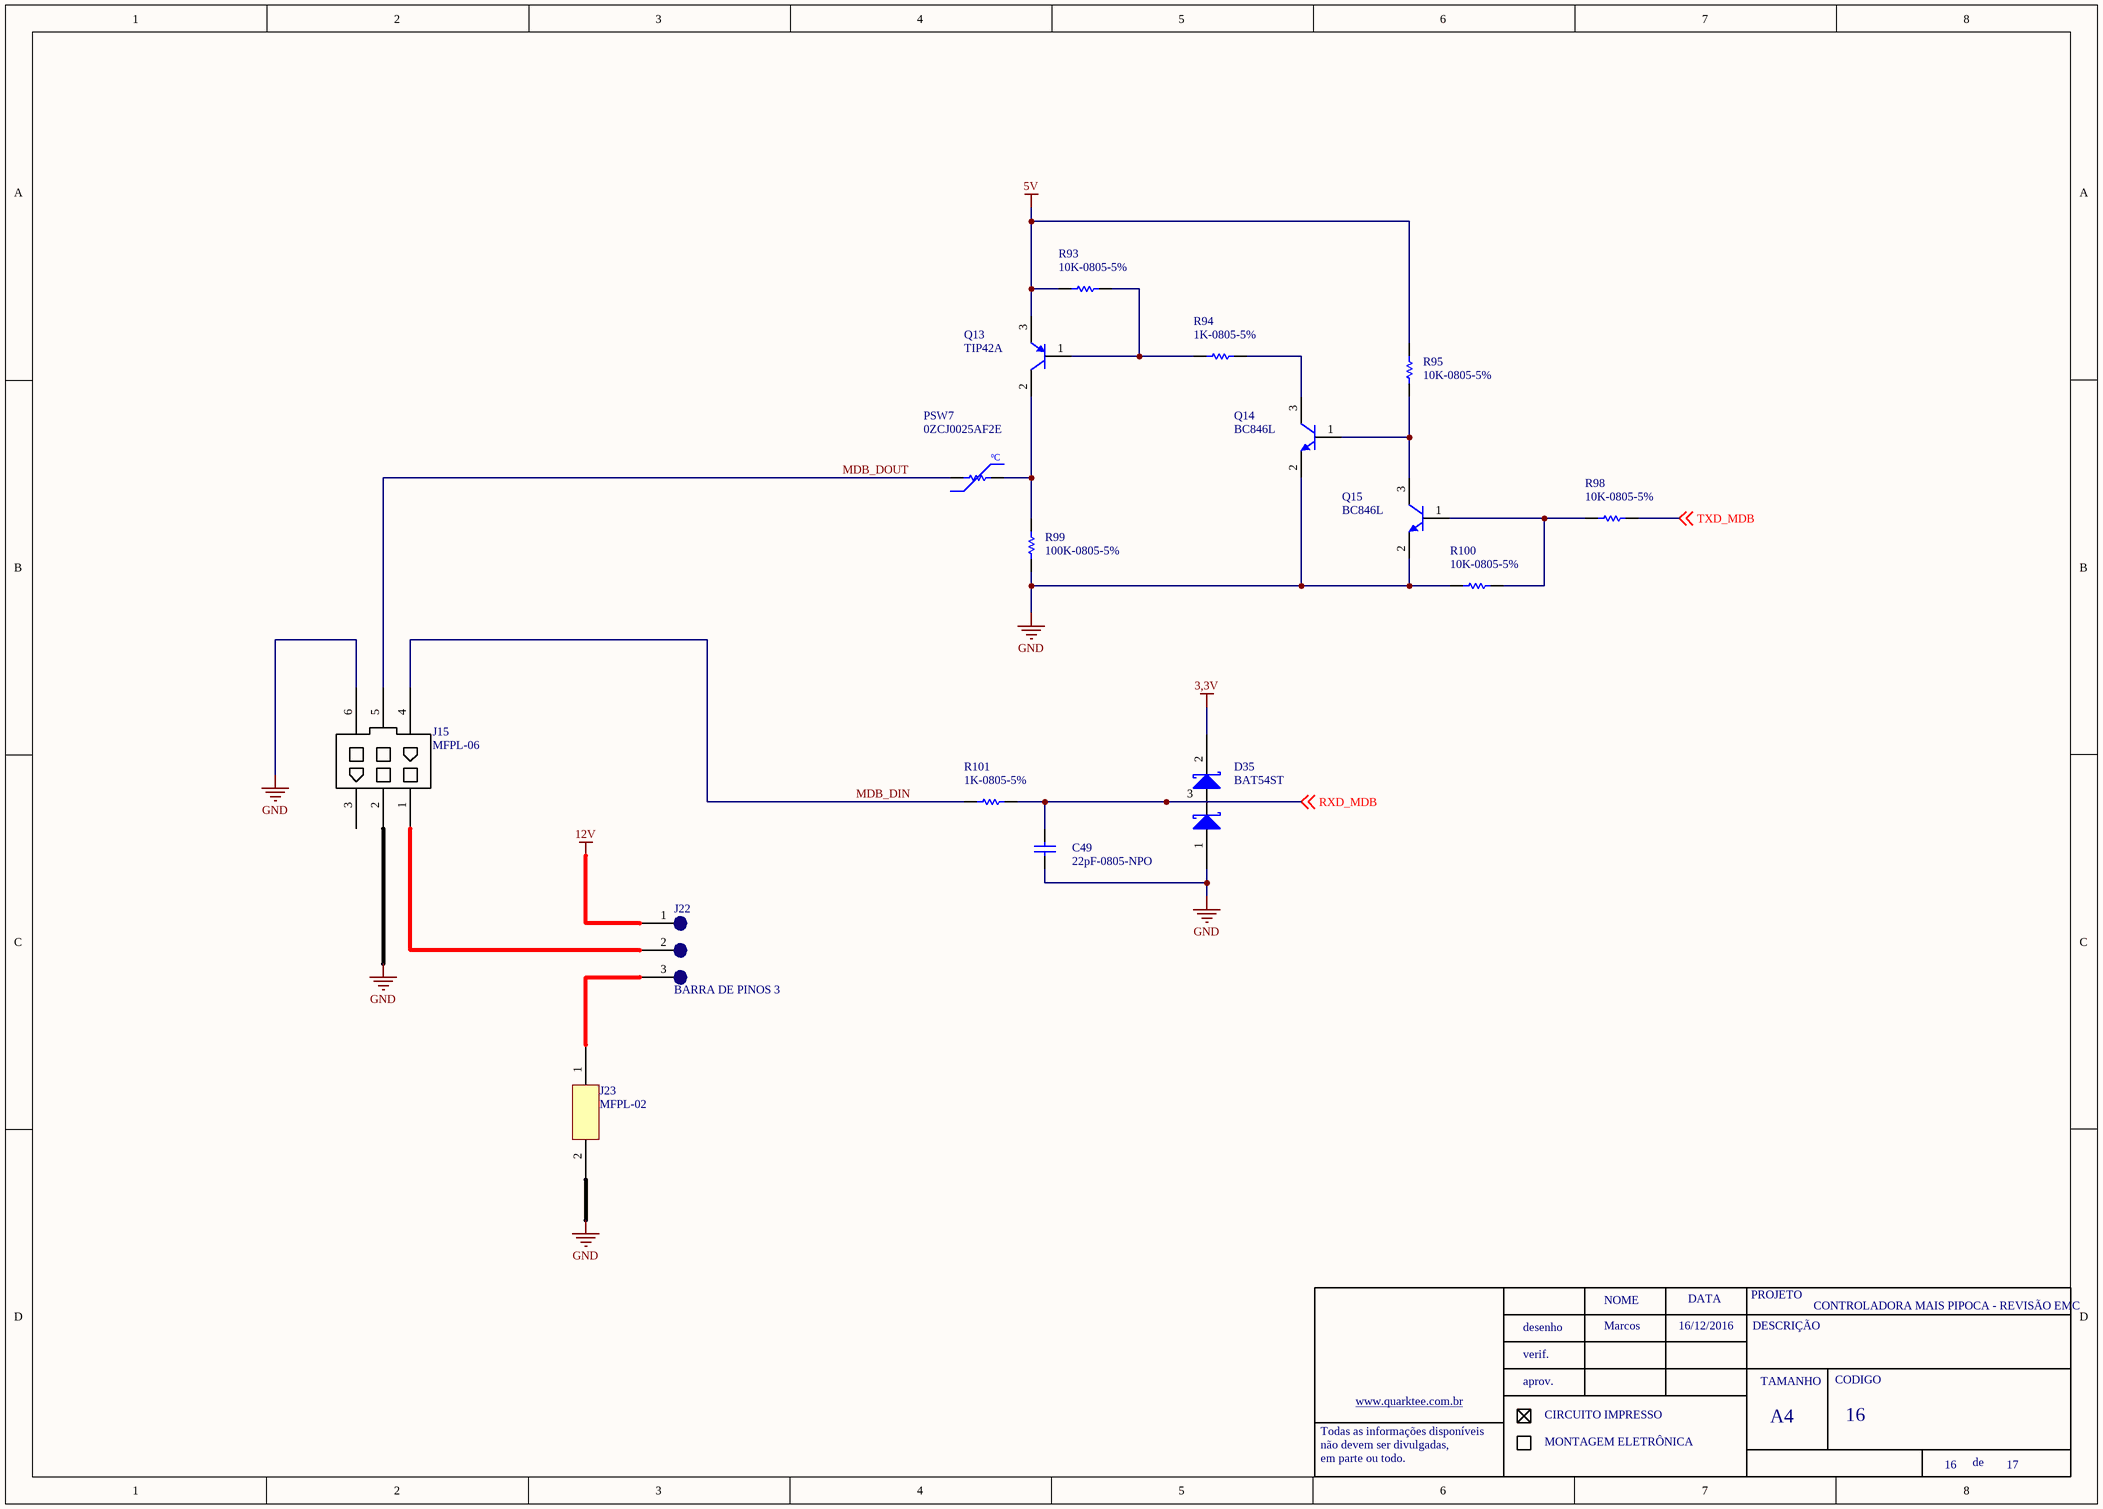
[diagram p15: Porta_MDB.SchDoc]

### Parts
C49  22pF-0805-NPO  [0805-REVISADO ONDA]
D35  BAT54ST  [SOT23 - REVISADO ONDA]
J15  MFPL-06
J22  BARRA DE PINOS 3
J23  MFPL-02
PSW7  0ZCJ0025AF2E  [1206-REVISADO ONDA]
Q13  TIP42A  [DPAK REVISADO ONDA]
Q14  BC846L  [SOT23 - REVISADO ONDA]
Q15  BC846L  [SOT23 - REVISADO ONDA]
R93  10K-0805-5%  [0805-REVISADO ONDA]
R94  1K-0805-5%  [0805-REVISADO ONDA]
R95  10K-0805-5%  [0805-REVISADO ONDA]
R98  10K-0805-5%  [0805-REVISADO ONDA]
R99  100K-0805-5%  [0805-REVISADO ONDA]
R100  10K-0805-5%  [0805-REVISADO ONDA]
R101  1K-0805-5%  [0805-REVISADO ONDA]

### Nets
3,3V: D35.2
5V: Q13.3(E) R93.1 R95.2
12V: J22.1
GND: C49.1 D35.1 J15.2 J15.6 J23.2 Q14.2(E) Q15.2(E) R99.1 R100.1
MDB_DIN: J15.4 R101.1
MDB_DOUT: J15.5 PSW7.1
RXD_MDB: C49.2 D35.3 R101.2 ; off-sheet RXD_MDB
TXD_MDB: R98.2 ; off-sheet TXD_MDB
NetJ15_1: J15.1 J22.2
NetJ22_3: J22.3 J23.1
NetPSW7_2: PSW7.2 Q13.2(C) R99.2
NetQ13_1: Q13.1(B) R93.2 R94.1
NetQ14_1: Q14.1(B) Q15.3(C) R95.1
NetQ14_3: Q14.3(C) R94.2
NetQ15_1: Q15.1(B) R98.1 R100.2

Not connected (* = marked no-connect by the designer): J15 3

### Notes on the sheet
- Marcos
- 16/12/2016
- NOME
- DATA
- PROJETO
- DESCRIÇÃO
- desenho
- verif.
- aprov.
- TAMANHO
- CODIGO
- Todas as informações disponíveis
- não devem ser divulgadas,
- em parte ou todo.
- www.quarktee.com.br
- CIRCUITO IMPRESSO
- MONTAGEM ELETRÔNICA
- A4
- de
- (in symbol PTC 2A-120V) ºC

### Library data of the parts
J22 = JUMPER 3
PSW7 = PTC 2A-120V
Q14 Q15 = BC846: ERP: 106.22.001
C49 = 22pF-0805-NPO: ERP: 104.11.001
Q13 = TIP42A: ERP: 107.01.007
R93 R95 R98 R100 = 10K-0805-5%: ERP: 102.11.054
R94 R101 = 1K-0805-5%: ERP: 102.11.042
R99 = 100K-0805-5%: ERP: 102.11.066

## Sheet Regulador.SchDoc: GRUPO ALTECH
size A3; DocumentNumber: 17; SheetNumber: 17; SheetTotal: 17
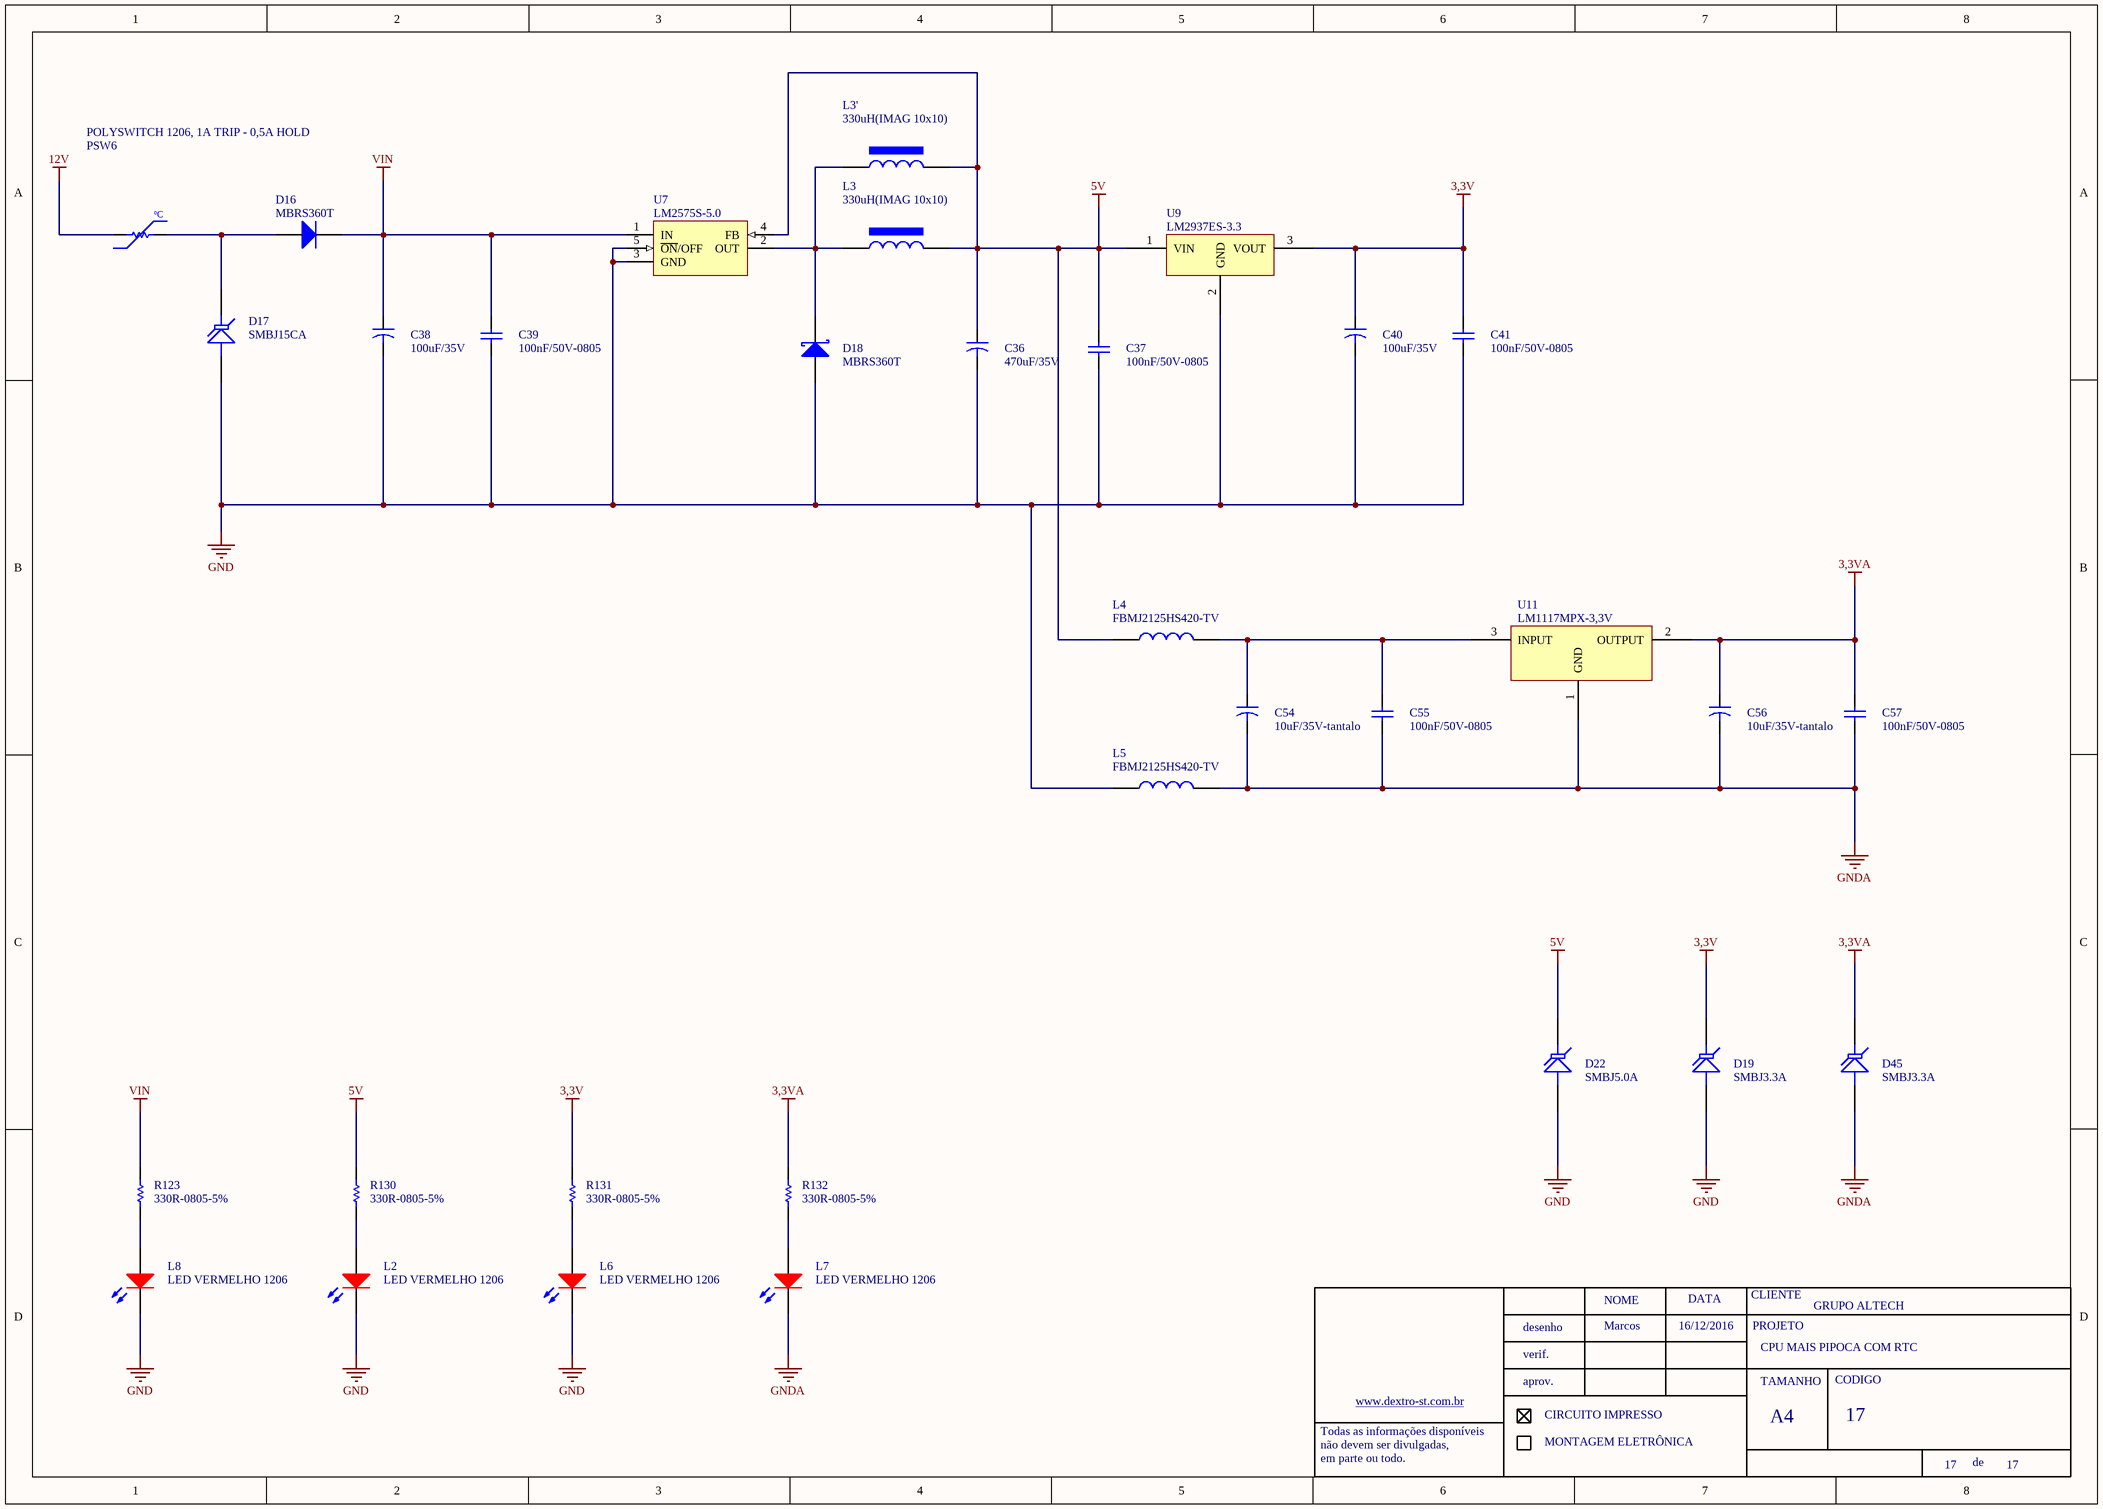
[diagram p16: Regulador.SchDoc]

### Parts
C36  470uF/35V  [CAP POL 8x12mm]
C37  100nF/50V-0805  [0805-REVISADO ONDA]
C38  100uF/35V  [CAP POL 8x12mm]
C39  100nF/50V-0805  [0805-REVISADO ONDA]
C40  100uF/35V  [CAP POL 8x12mm]
C41  100nF/50V-0805  [0805-REVISADO ONDA]
C54  10uF/35V-tantalo  [tantalo vishay E]
C55  100nF/50V-0805  [0805-REVISADO ONDA]
C56  10uF/35V-tantalo  [tantalo vishay E]
C57  100nF/50V-0805  [0805-REVISADO ONDA]
D16  MBRS360T  [DO-214AB]
D17  SMBJ15CA  [DO-214AA]
D18  MBRS360T  [DO-214AB]
D19  SMBJ3.3A  [DO-214AA]
D22  SMBJ5.0A  [DO-214AA]
D45  SMBJ3.3A  [DO-214AA]
L2  LED VERMELHO 1206  [LED 1206]
L3  330uH(IMAG 10x10)  [INDUTOR 47mH]
L3'  330uH(IMAG 10x10)  [INDUTOR 47mH]
L4  FBMJ2125HS420-TV  [0805-REVISADO ONDA]
L5  FBMJ2125HS420-TV  [0805-REVISADO ONDA]
L6  LED VERMELHO 1206  [LED 1206]
L7  LED VERMELHO 1206  [LED 1206]
L8  LED VERMELHO 1206  [LED 1206]
PSW6  POLYSWITCH 1206, 1A TRIP - 0,5A HOLD  [1206-REVISADO ONDA]
R123  330R-0805-5%  [0805-REVISADO ONDA]
R130  330R-0805-5%  [0805-REVISADO ONDA]
R131  330R-0805-5%  [0805-REVISADO ONDA]
R132  330R-0805-5%  [0805-REVISADO ONDA]
U7  LM2575S-5.0  [TO-263-5]
U9  LM2937ES-3.3  [TO-263]
U11  LM1117MPX-3,3V  [SOT223]

### Nets
3,3V: C40.1 C41.2 D19.2(K) R131.2 U9.3(VOUT)
3,3VA: C56.1 C57.2 D45.2(K) R132.2 U11.2(OUTPUT)
5V: C36.1 C37.2 D22.2(K) L3.1 L3'.1 L4.1 R130.2 U7.4(FB) U9.1(VIN)
12V: PSW6.1
GND: C36.2 C37.1 C38.2 C39.1 C40.2 C41.1 D17.1(A) D18.1(A) D19.1(A) D22.1(A) L2.2(K) L5.1 L6.2(K) L8.2(K) U7.3(GND) U7.5(~{ON}/OFF) U9.2(GND)
GNDA: C54.2 C55.1 C56.2 C57.1 D45.1(A) L5.2 L7.2(K) U11.1(GND)
VIN: C38.1 C39.2 D16.2(K) R123.2 U7.1(IN)
NetC54_1: C54.1 C55.2 L4.2 U11.3(INPUT)
NetD16_1: D16.1(A) D17.2(K) PSW6.2
NetD18_2: D18.2(K) L3.2 L3'.2 U7.2(OUT)
NetL2_1: L2.1(A) R130.1
NetL6_1: L6.1(A) R131.1
NetL7_1: L7.1(A) R132.1
NetL8_1: L8.1(A) R123.1

### Notes on the sheet
- Marcos
- 16/12/2016
- CPU MAIS PIPOCA COM RTC
- NOME
- DATA
- CLIENTE
- PROJETO
- desenho
- verif.
- aprov.
- TAMANHO
- CODIGO
- Todas as informações disponíveis
- não devem ser divulgadas,
- em parte ou todo.
- www.dextro-st.com.br
- CIRCUITO IMPRESSO
- MONTAGEM ELETRÔNICA
- A4
- de
- (in symbol PTC 2A-120V) ºC

### Library data of the parts
C36 C38 C40 = 100uF/50V: ERP: 105.01.003
C37 C39 C41 C55 C57 = 100nF/50-0805-NPO: ERP: 104.11.005
D16 = 1N4007: ERP: 120.18.001
D17 = SMBJ30.0A: ERP: 128.02.003
D18 = 1N5819-SOD80: ERP: 121.18.003
D19 D45 = SMBJ5.0A: ERP: 128.02.002
L2 L6-L8 = LED VERMELHO 0603 SMD: ERP: 124.02.010
L3 L3' = indutor 1mH CNF15: 1mH-CNF15-26 AWG; ERP: 211.00.012
L4 L5 = FERRITE BEAD 2K7-100MHZ - 200 mA - 800mOHM DC
PSW6 = PTC 2A-120V
R123 R130-R132 = 1K-0805-5%: ERP: 102.11.042
U9 = LM3940IT-3.3-TO220: LM2937; ERP: 115.01.001
U11 = LM1117MPX-3,3V-SOT223: ERP: 115.01.011
C54 C56 = 10uF/35V-tantalo: ERP: 104.11.011
D22 = SMBJ5.0A: ERP: 128.02.002
U7 = LM2575S-5.0: ERP: 115.01.020